# EAGLE schematic Masters Project (EAGLE 9.4.2), part 1 of 2
DESIGNER: Sean Alling; REVISION: V3

## Sheet 1 of 35: Table Of Contents
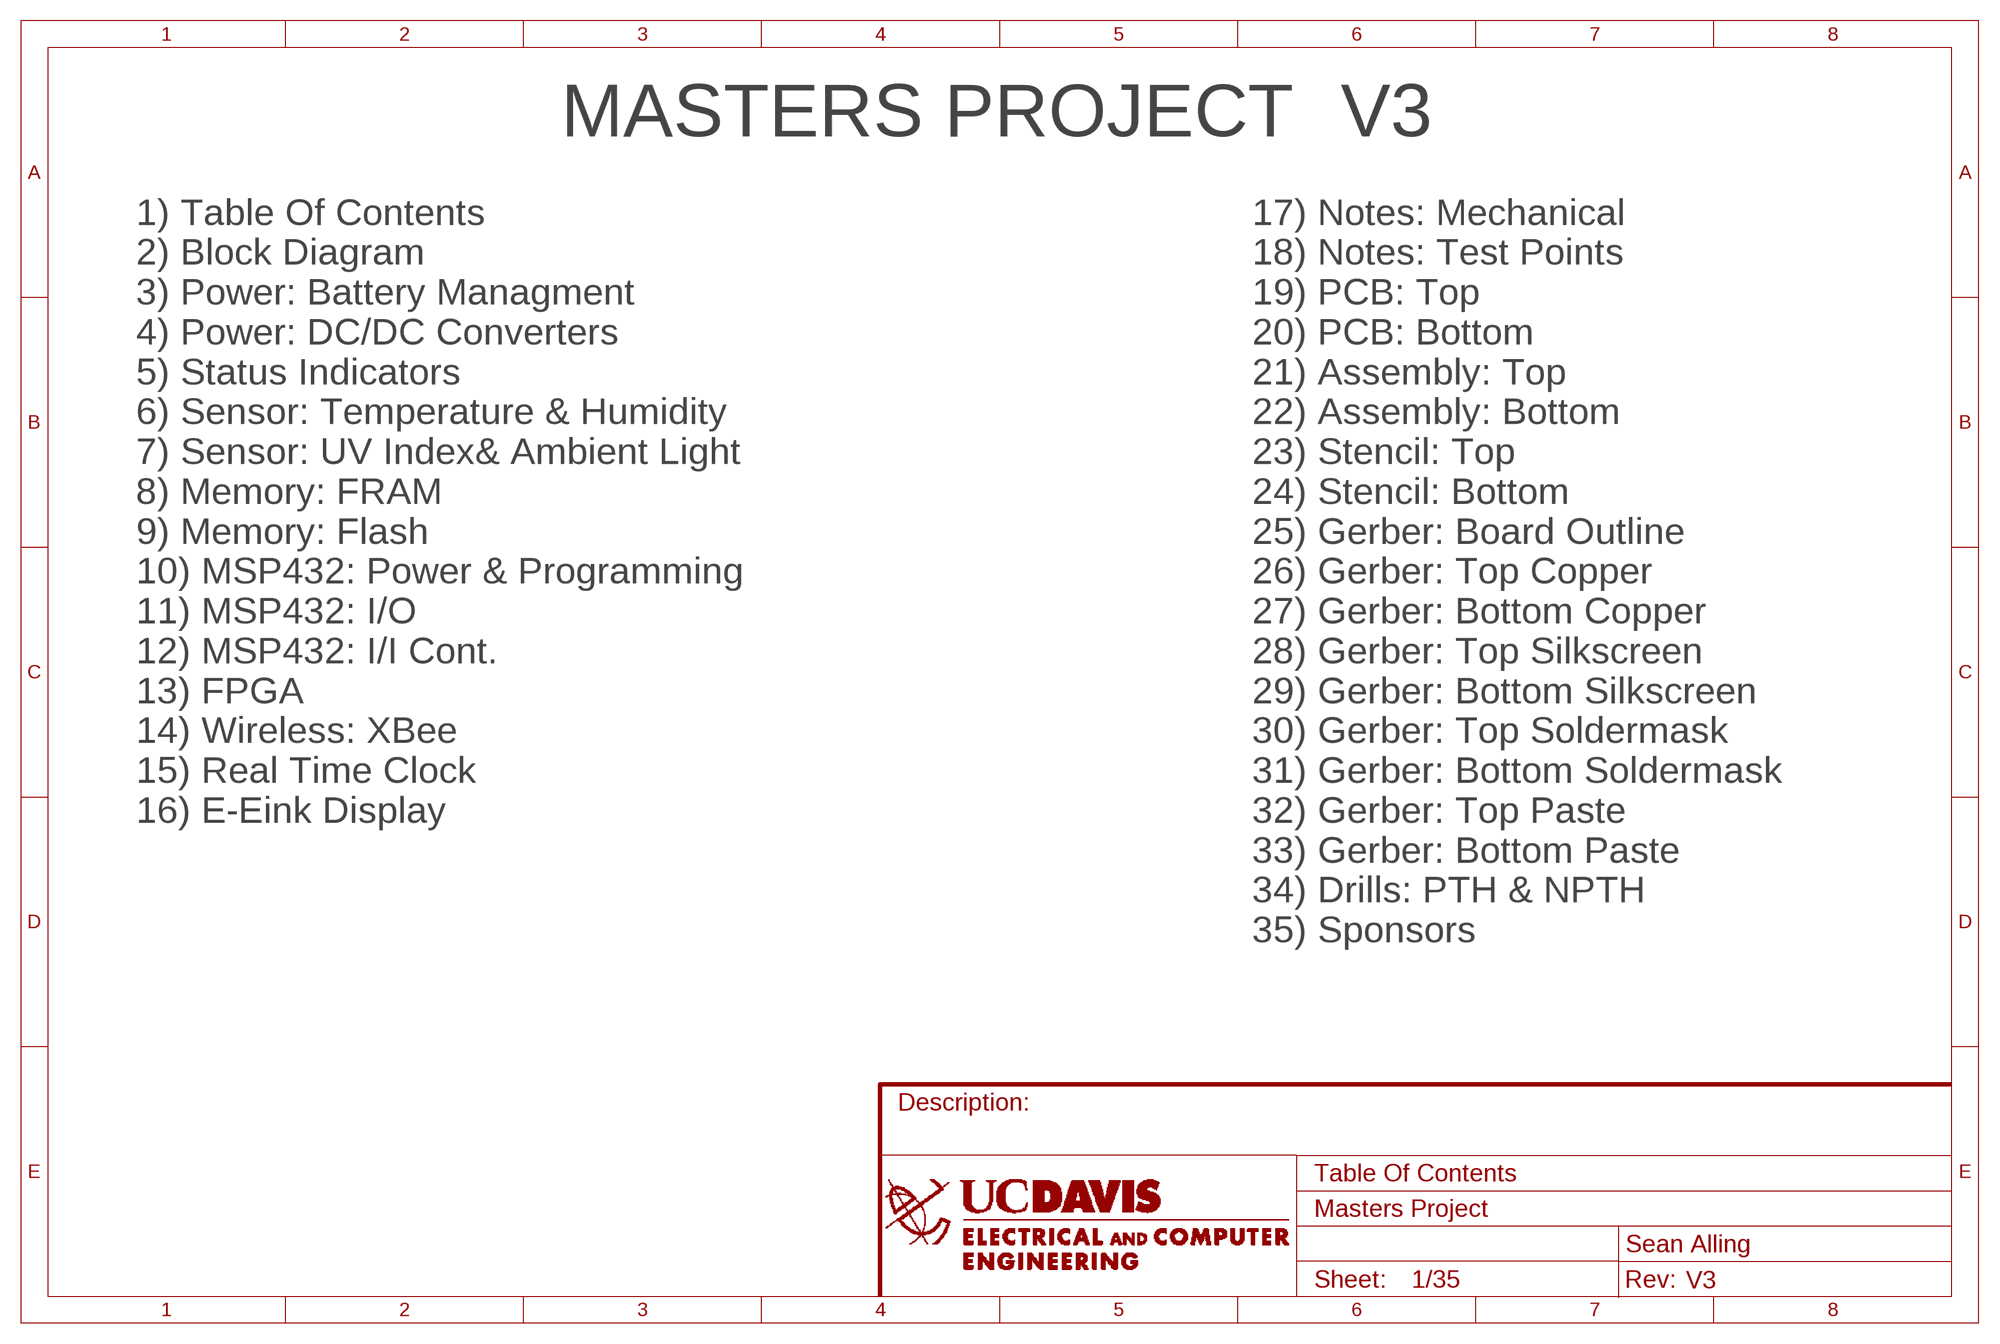
[diagram p0: schematic, sheet 1]

### Notes on the sheet
- MASTERS PROJECT
- 1) Table Of Contents
  2) Block Diagram
  3) Power: Battery Managment
  4) Power: DC/DC Converters
  5) Status Indicators
  6) Sensor: Temperature & Humidity
  7) Sensor: UV Index& Ambient Light
  8) Memory: FRAM
  9) Memory: Flash
  10) MSP432: Power & Programming
  11) MSP432: I/O
  12) MSP432: I/I Cont.
  13) FPGA
  14) Wireless: XBee
  15) Real Time Clock
  16) E-Eink Display
- 17) Notes: Mechanical
  18) Notes: Test Points
  19) PCB: Top
  20) PCB: Bottom
  21) Assembly: Top
  22) Assembly: Bottom
  23) Stencil: Top
  24) Stencil: Bottom
  25) Gerber: Board Outline
  26) Gerber: Top Copper
  27) Gerber: Bottom Copper
  28) Gerber: Top Silkscreen
  29) Gerber: Bottom Silkscreen
  30) Gerber: Top Soldermask
  31) Gerber: Bottom Soldermask
  32) Gerber: Top Paste
  33) Gerber: Bottom Paste
  34) Drills: PTH & NPTH
  35) Sponsors

## Sheet 2 of 35: Block Diagram
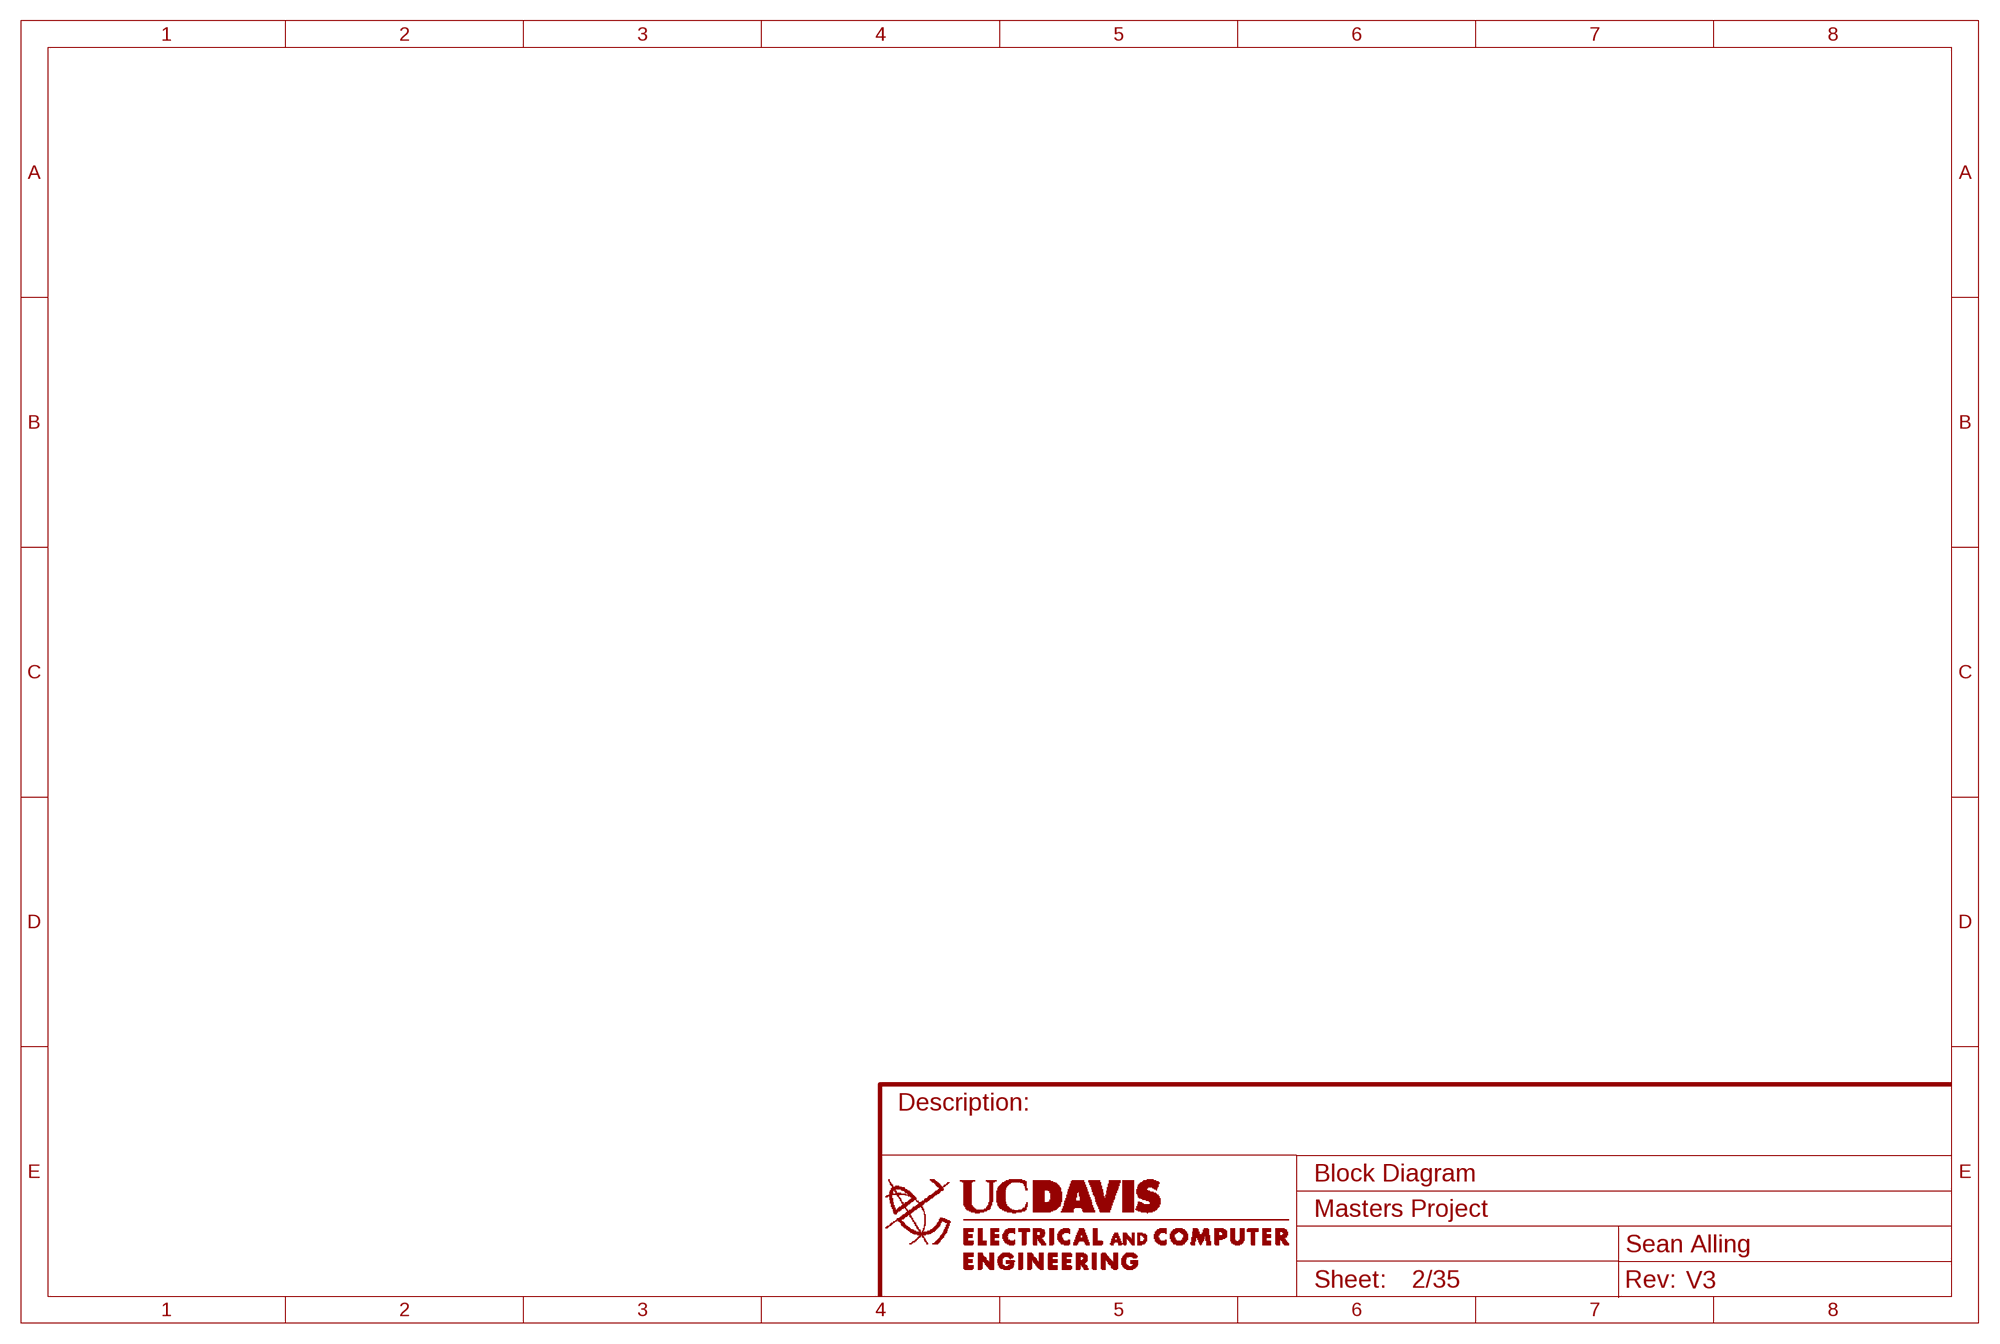
[diagram p1: schematic, sheet 2]

## Sheet 3 of 35: Power: Battery Managment
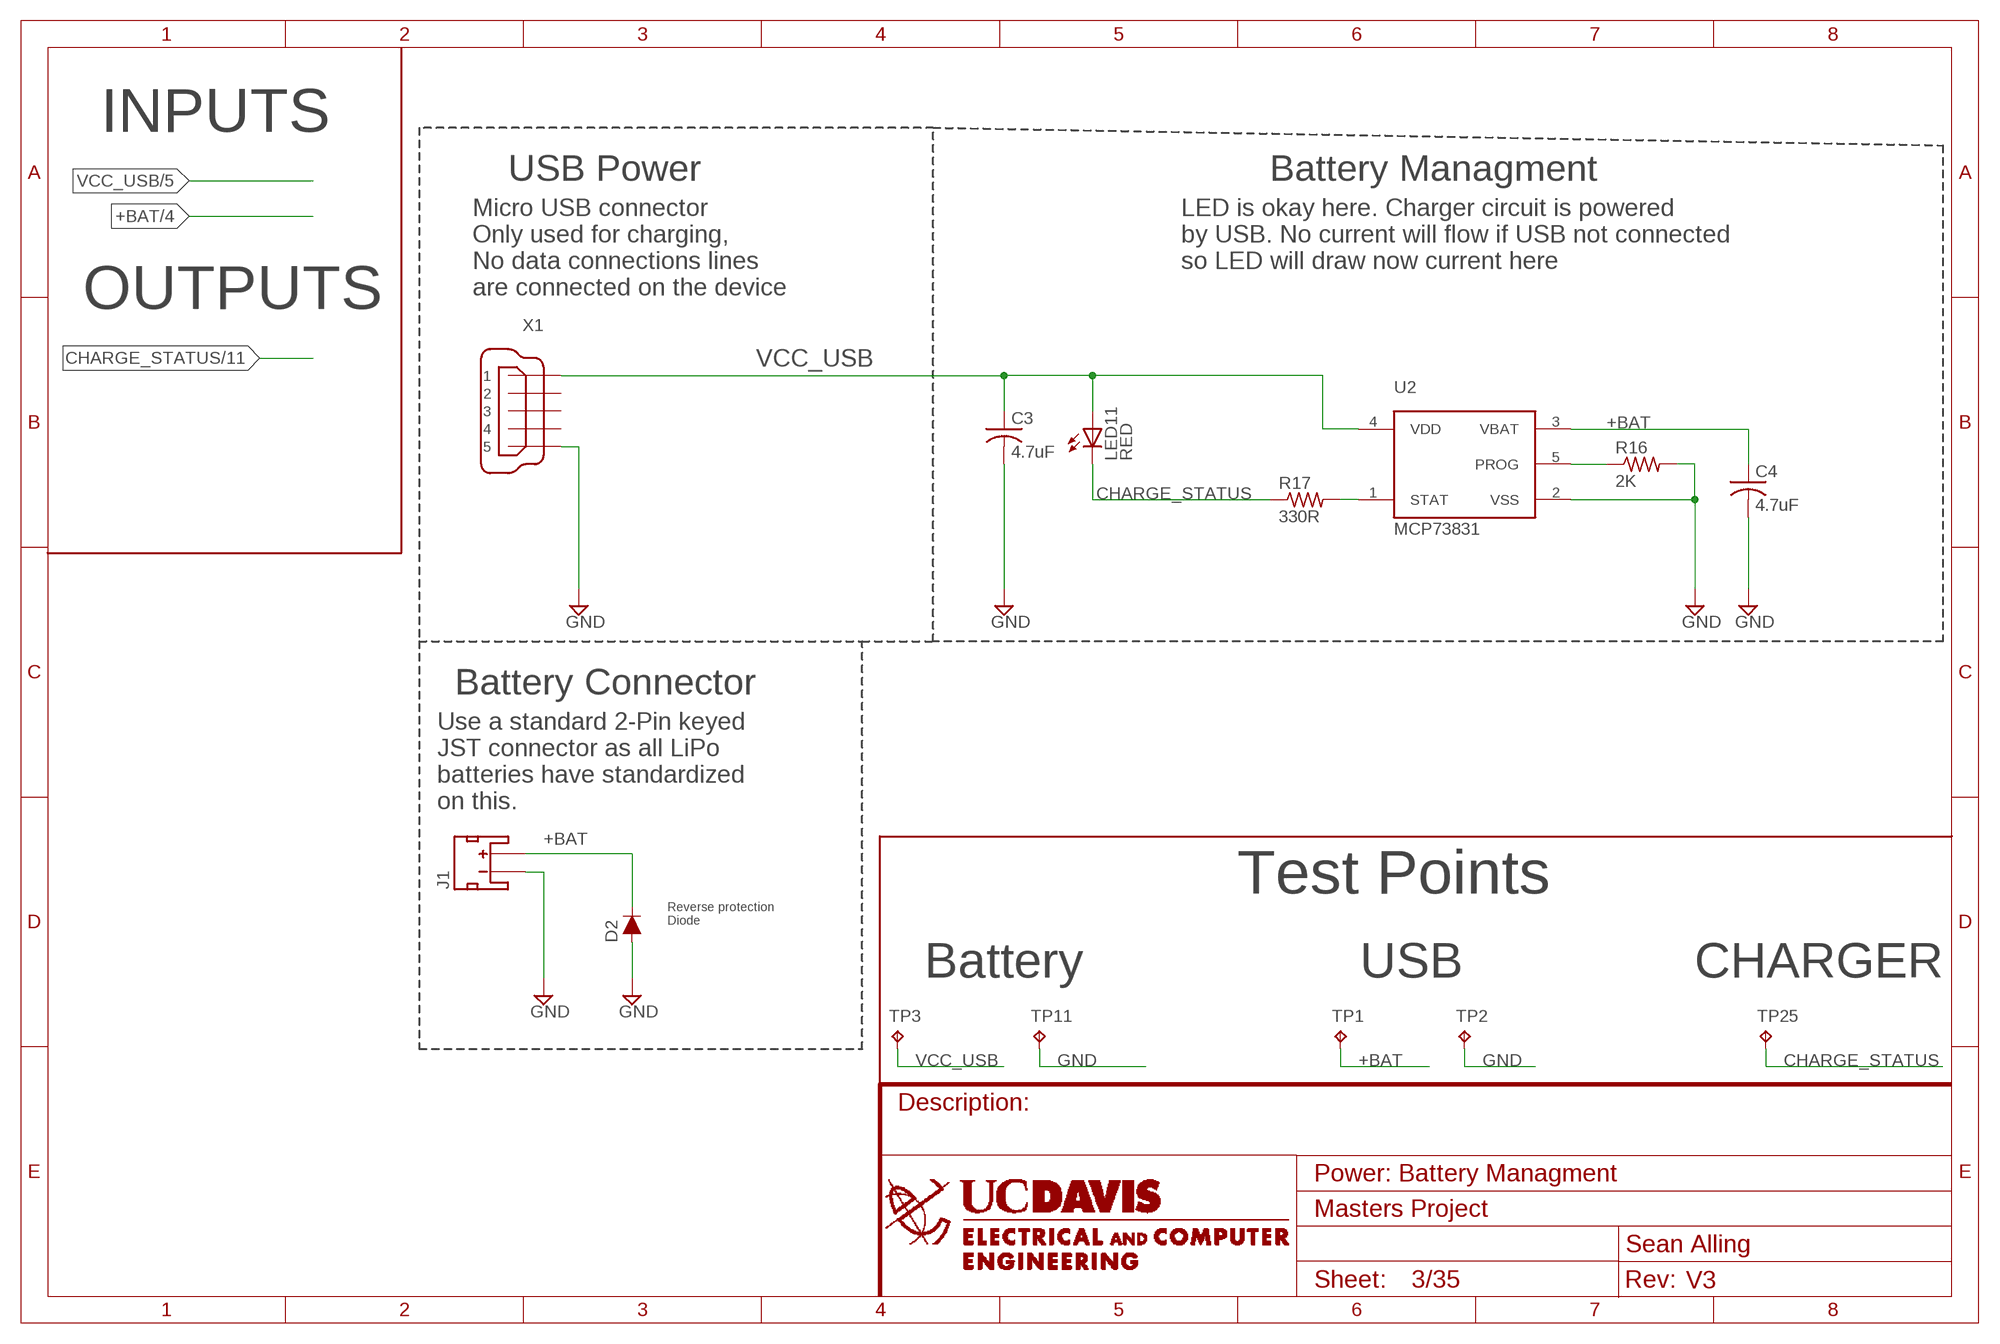
[diagram p2: schematic, sheet 3]

### Parts
C3  4.7uF  C-USC0603  [C0603]
C4  4.7uF  C-USC0603  [C0603]
D2  250mA/100V  DIODE-BAS16J  [SOD-323]
J1  JST_2MM_MALE  [JST-2-SMD]
LED11  RED  LEDCHIPLED_0603  [CHIPLED_0603]
R16  2K  R-US_R0603  [R0603]
R17  330R  R-US_R0603  [R0603]
TP1  TPB1,27  [B1,27]
TP2  TPB1,27  [B1,27]
TP3  TPB1,27  [B1,27]
TP11  TPB1,27  [B1,27]
TP25  TPB1,27  [B1,27]
U2  MCP73831  [SOT23-5L]
X1  MINI-USB-32005-201  [32005-201]

### Nets
+BAT: C4.1 D2.C J1.2(+) TP1.TP U2.3(VBAT) ; also sheet 4,5,15
CHARGE_STATUS: LED11.C R17.1 TP25.TP ; also sheet 11
GND: C3.2 C4.2 D2.A J1.1(-) R16.2 TP2.TP TP11.TP U2.2(VSS) X1.5 ; also sheet 4,5,6,7,8,9,10,12,13,14,15,16
N$5: R17.2 U2.1(STAT)
N$17: R16.1 U2.5(PROG)
VCC_USB: C3.1 LED11.A TP3.TP U2.4(VDD) X1.1 ; also sheet 5
Unconnected: J1.NC1(PAD1) J1.NC2(PAD2) X1.2 X1.3 X1.4

### Notes on the sheet
- INPUTS
- USB Power | Battery Managment
- Micro USB connector
  Only used for charging, 
  No data connections lines 
  are connected on the device
- LED is okay here. Charger circuit is powered
  by USB. No current will flow if USB not connected
  so LED will draw now current here
- OUTPUTS
- Battery Connector
- Use a standard 2-Pin keyed 
  JST connector as all LiPo
  batteries have standardized
  on this.
- Test Points
- Reverse protection 
  Diode
- Battery | USB | CHARGER

## Sheet 4 of 35: Power: DC/DC Converters
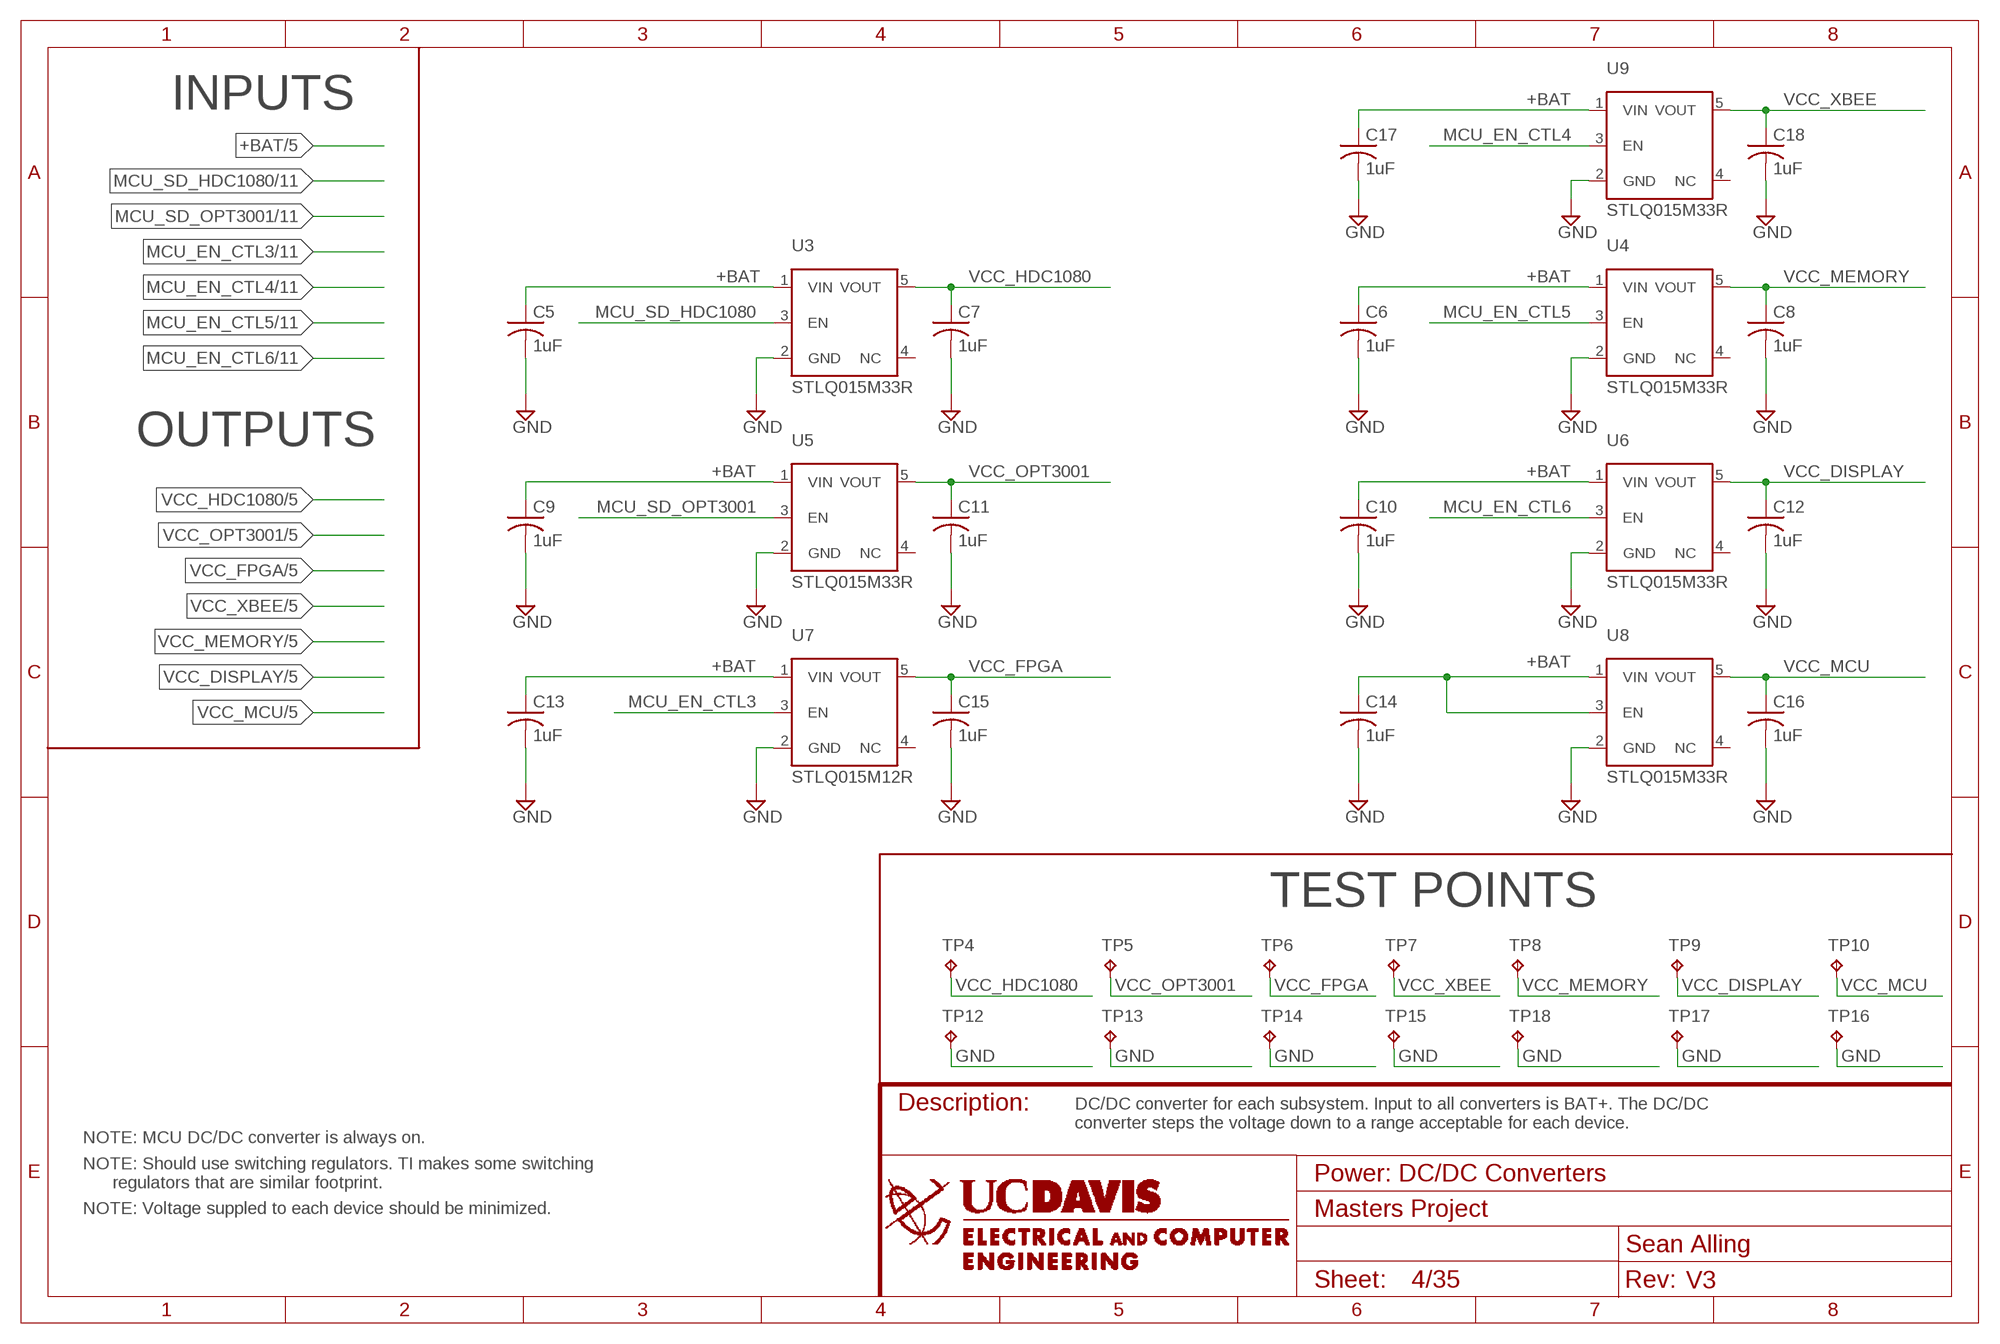
[diagram p3: schematic, sheet 4]

### Parts
C5  1uF  C-USC0603  [C0603]
C6  1uF  C-USC0603  [C0603]
C7  1uF  C-USC0603  [C0603]
C8  1uF  C-USC0603  [C0603]
C9  1uF  C-USC0603  [C0603]
C10  1uF  C-USC0603  [C0603]
C11  1uF  C-USC0603  [C0603]
C12  1uF  C-USC0603  [C0603]
C13  1uF  C-USC0603  [C0603]
C14  1uF  C-USC0603  [C0603]
C15  1uF  C-USC0603  [C0603]
C16  1uF  C-USC0603  [C0603]
C17  1uF  C-USC0603  [C0603]
C18  1uF  C-USC0603  [C0603]
TP4  TPB1,27  [B1,27]
TP5  TPB1,27  [B1,27]
TP6  TPB1,27  [B1,27]
TP7  TPB1,27  [B1,27]
TP8  TPB1,27  [B1,27]
TP9  TPB1,27  [B1,27]
TP10  TPB1,27  [B1,27]
TP12  TPB1,27  [B1,27]
TP13  TPB1,27  [B1,27]
TP14  TPB1,27  [B1,27]
TP15  TPB1,27  [B1,27]
TP16  TPB1,27  [B1,27]
TP17  TPB1,27  [B1,27]
TP18  TPB1,27  [B1,27]
U3  STLQ015M33R  [SOT23-5L]
U4  STLQ015M33R  [SOT23-5L]
U5  STLQ015M33R  [SOT23-5L]
U6  STLQ015M33R  [SOT23-5L]
U7  STLQ015M12R  [SOT23-5L]
U8  STLQ015M33R  [SOT23-5L]
U9  STLQ015M33R  [SOT23-5L]

### Nets
+BAT: C5.1 C6.1 C9.1 C10.1 C13.1 C14.1 C17.1 U3.1(VIN) U4.1(VIN) U5.1(VIN) U6.1(VIN) U7.1(VIN) U8.1(VIN) U8.3(EN) U9.1(VIN) ; also sheet 3,5,15
GND: C5.2 C6.2 C7.2 C8.2 C9.2 C10.2 C11.2 C12.2 C13.2 C14.2 C15.2 C16.2 C17.2 C18.2 TP12.TP TP13.TP TP14.TP TP15.TP TP16.TP TP17.TP TP18.TP U3.2(GND) U4.2(GND) U5.2(GND) U6.2(GND) U7.2(GND) U8.2(GND) U9.2(GND) ; also sheet 3,5,6,7,8,9,10,12,13,14,15,16
MCU_EN_CTL3: U7.3(EN) ; also sheet 11
MCU_EN_CTL4: U9.3(EN) ; also sheet 11
MCU_EN_CTL5: U4.3(EN) ; also sheet 11
MCU_EN_CTL6: U6.3(EN) ; also sheet 11
MCU_SD_HDC1080: U3.3(EN) ; also sheet 11
MCU_SD_OPT3001: U5.3(EN) ; also sheet 11
VCC_DISPLAY: C12.1 TP9.TP U6.5(VOUT) ; also sheet 5,16
VCC_FPGA: C15.1 TP6.TP U7.5(VOUT) ; also sheet 5,13
VCC_HDC1080: C7.1 TP4.TP U3.5(VOUT) ; also sheet 5,6
VCC_MCU: C16.1 TP10.TP U8.5(VOUT) ; also sheet 5,10,11,12
VCC_MEMORY: C8.1 TP8.TP U4.5(VOUT) ; also sheet 5,8,9
VCC_OPT3001: C11.1 TP5.TP U5.5(VOUT) ; also sheet 5,7
VCC_XBEE: C18.1 TP7.TP U9.5(VOUT) ; also sheet 5,14
Unconnected: U3.4(NC) U4.4(NC) U5.4(NC) U6.4(NC) U7.4(NC) U8.4(NC) U9.4(NC)

### Notes on the sheet
- INPUTS
- OUTPUTS
- TEST POINTS
- DC/DC converter for each subsystem. Input to all converters is BAT+. The DC/DC
  converter steps the voltage down to a range acceptable for each device.
- NOTE: MCU DC/DC converter is always on.
- NOTE: Should use switching regulators. TI makes some switching 
        regulators that are similar footprint.
- NOTE: Voltage suppled to each device should be minimized.

## Sheet 5 of 35: Status Indicators
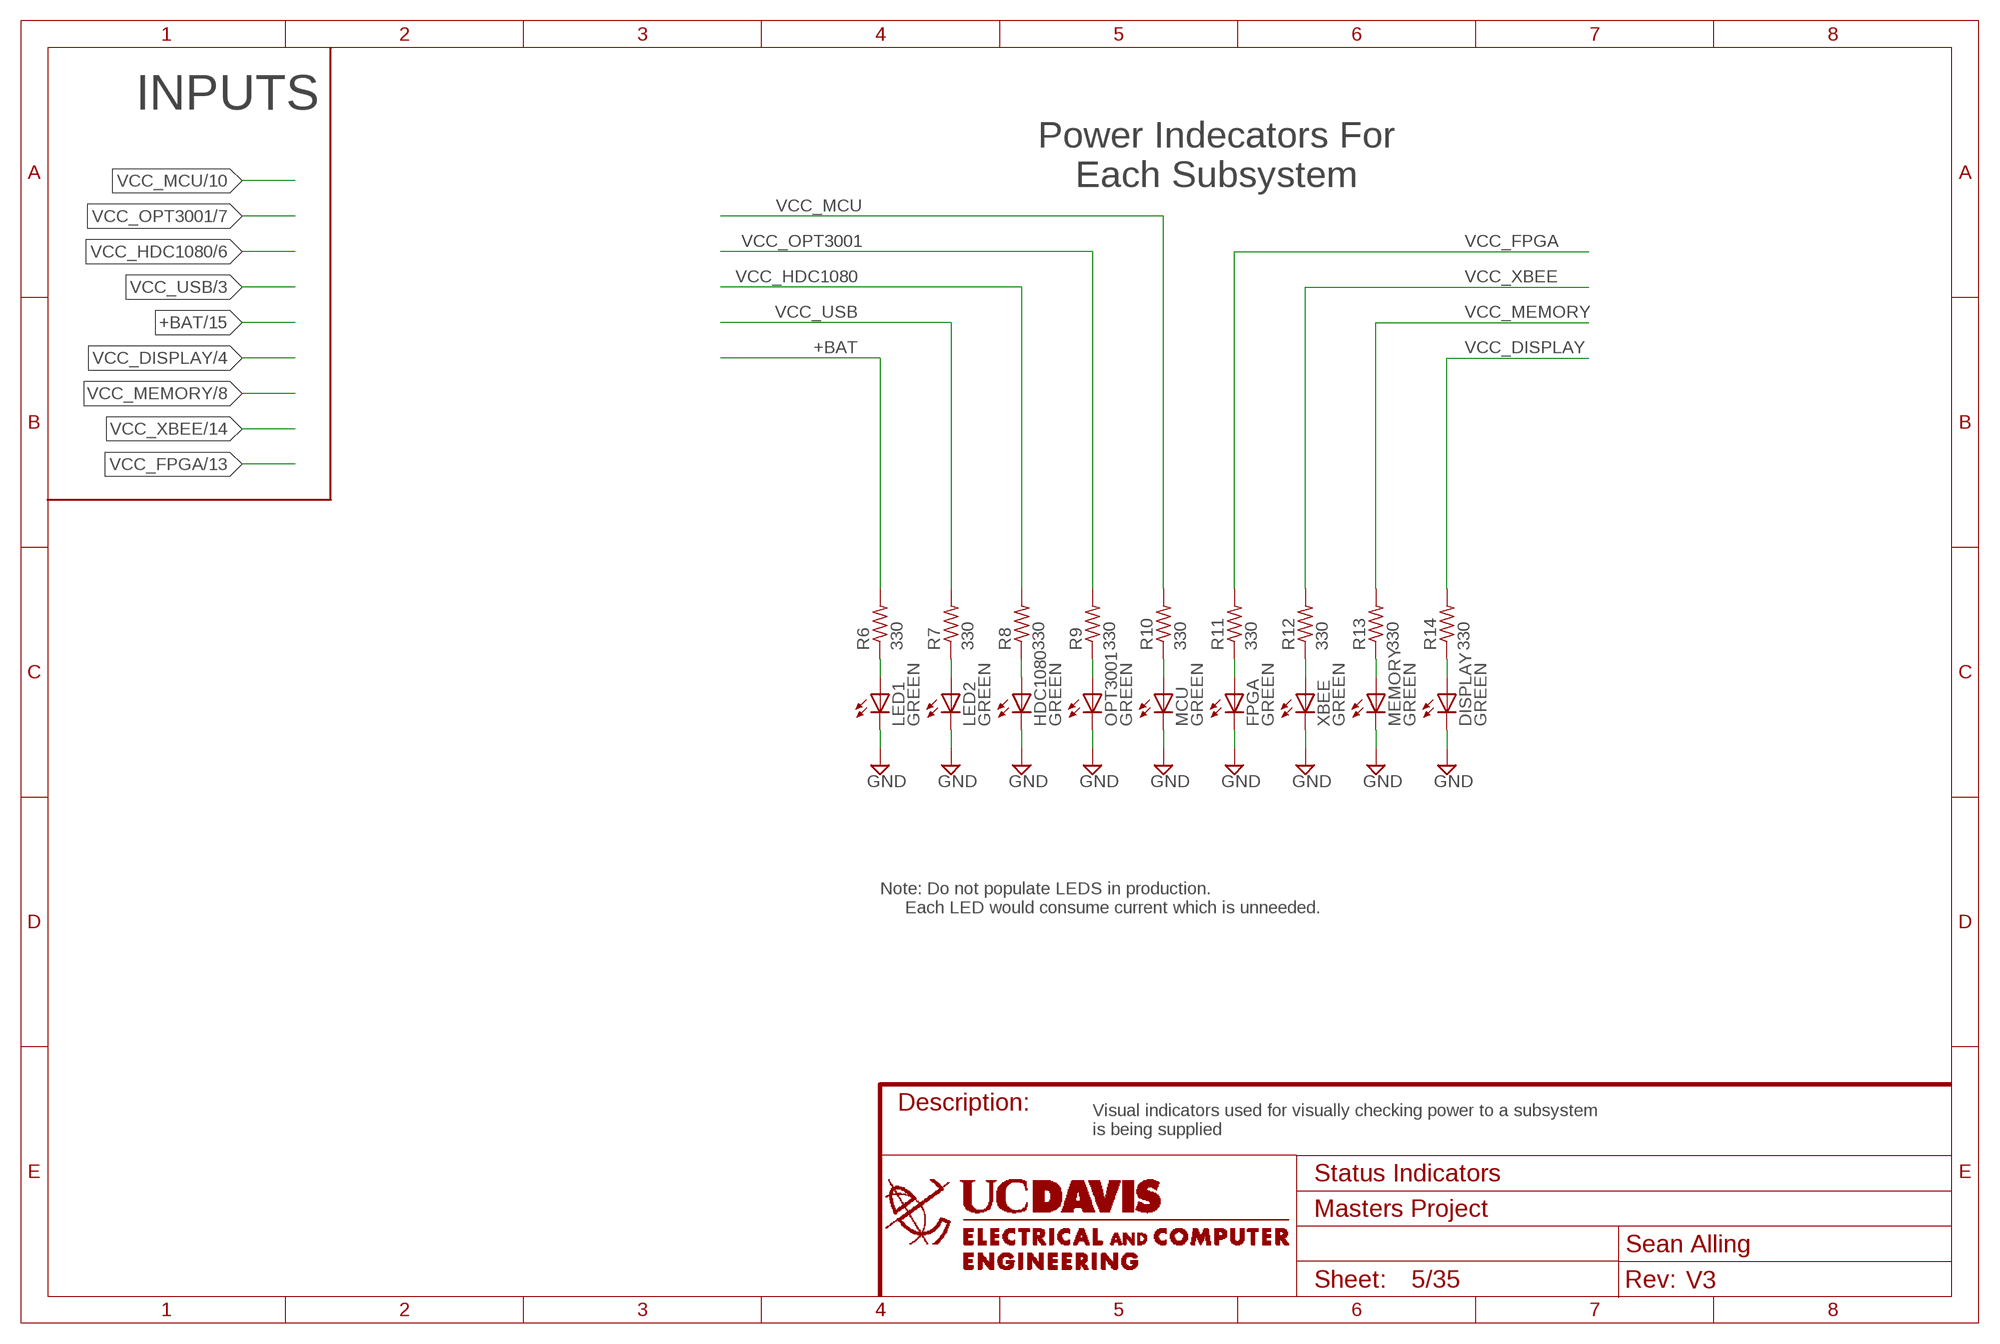
[diagram p4: schematic, sheet 5]

### Parts
DISPLAY  GREEN  LEDCHIPLED_0603  [CHIPLED_0603]
FPGA  GREEN  LEDCHIPLED_0603  [CHIPLED_0603]
HDC1080  GREEN  LEDCHIPLED_0603  [CHIPLED_0603]
LED1  GREEN  LEDCHIPLED_0603  [CHIPLED_0603]
LED2  GREEN  LEDCHIPLED_0603  [CHIPLED_0603]
MCU  GREEN  LEDCHIPLED_0603  [CHIPLED_0603]
MEMORY  GREEN  LEDCHIPLED_0603  [CHIPLED_0603]
OPT3001  GREEN  LEDCHIPLED_0603  [CHIPLED_0603]
R6  330  R-US_R0603  [R0603]
R7  330  R-US_R0603  [R0603]
R8  330  R-US_R0603  [R0603]
R9  330  R-US_R0603  [R0603]
R10  330  R-US_R0603  [R0603]
R11  330  R-US_R0603  [R0603]
R12  330  R-US_R0603  [R0603]
R13  330  R-US_R0603  [R0603]
R14  330  R-US_R0603  [R0603]
XBEE  GREEN  LEDCHIPLED_0603  [CHIPLED_0603]

### Nets
+BAT: R6.2 ; also sheet 3,4,15
GND: DISPLAY.C FPGA.C HDC1080.C LED1.C LED2.C MCU.C MEMORY.C OPT3001.C XBEE.C ; also sheet 3,4,6,7,8,9,10,12,13,14,15,16
N$164: LED1.A R6.1
N$165: LED2.A R7.1
N$166: HDC1080.A R8.1
N$167: OPT3001.A R9.1
N$168: MCU.A R10.1
N$169: FPGA.A R11.1
N$171: DISPLAY.A R14.1
N$172: MEMORY.A R13.1
N$173: R12.1 XBEE.A
VCC_DISPLAY: R14.2 ; also sheet 4,16
VCC_FPGA: R11.2 ; also sheet 4,13
VCC_HDC1080: R8.2 ; also sheet 4,6
VCC_MCU: R10.2 ; also sheet 4,10,11,12
VCC_MEMORY: R13.2 ; also sheet 4,8,9
VCC_OPT3001: R9.2 ; also sheet 4,7
VCC_USB: R7.2 ; also sheet 3
VCC_XBEE: R12.2 ; also sheet 4,14

### Notes on the sheet
- INPUTS
- Power Indecators For
  Each Subsystem
- Note: Do not populate LEDS in production. 
       Each LED would consume current which is unneeded.
- Visual indicators used for visually checking power to a subsystem
  is being supplied

## Sheet 6 of 35: Sensor: Temperature & Humidity
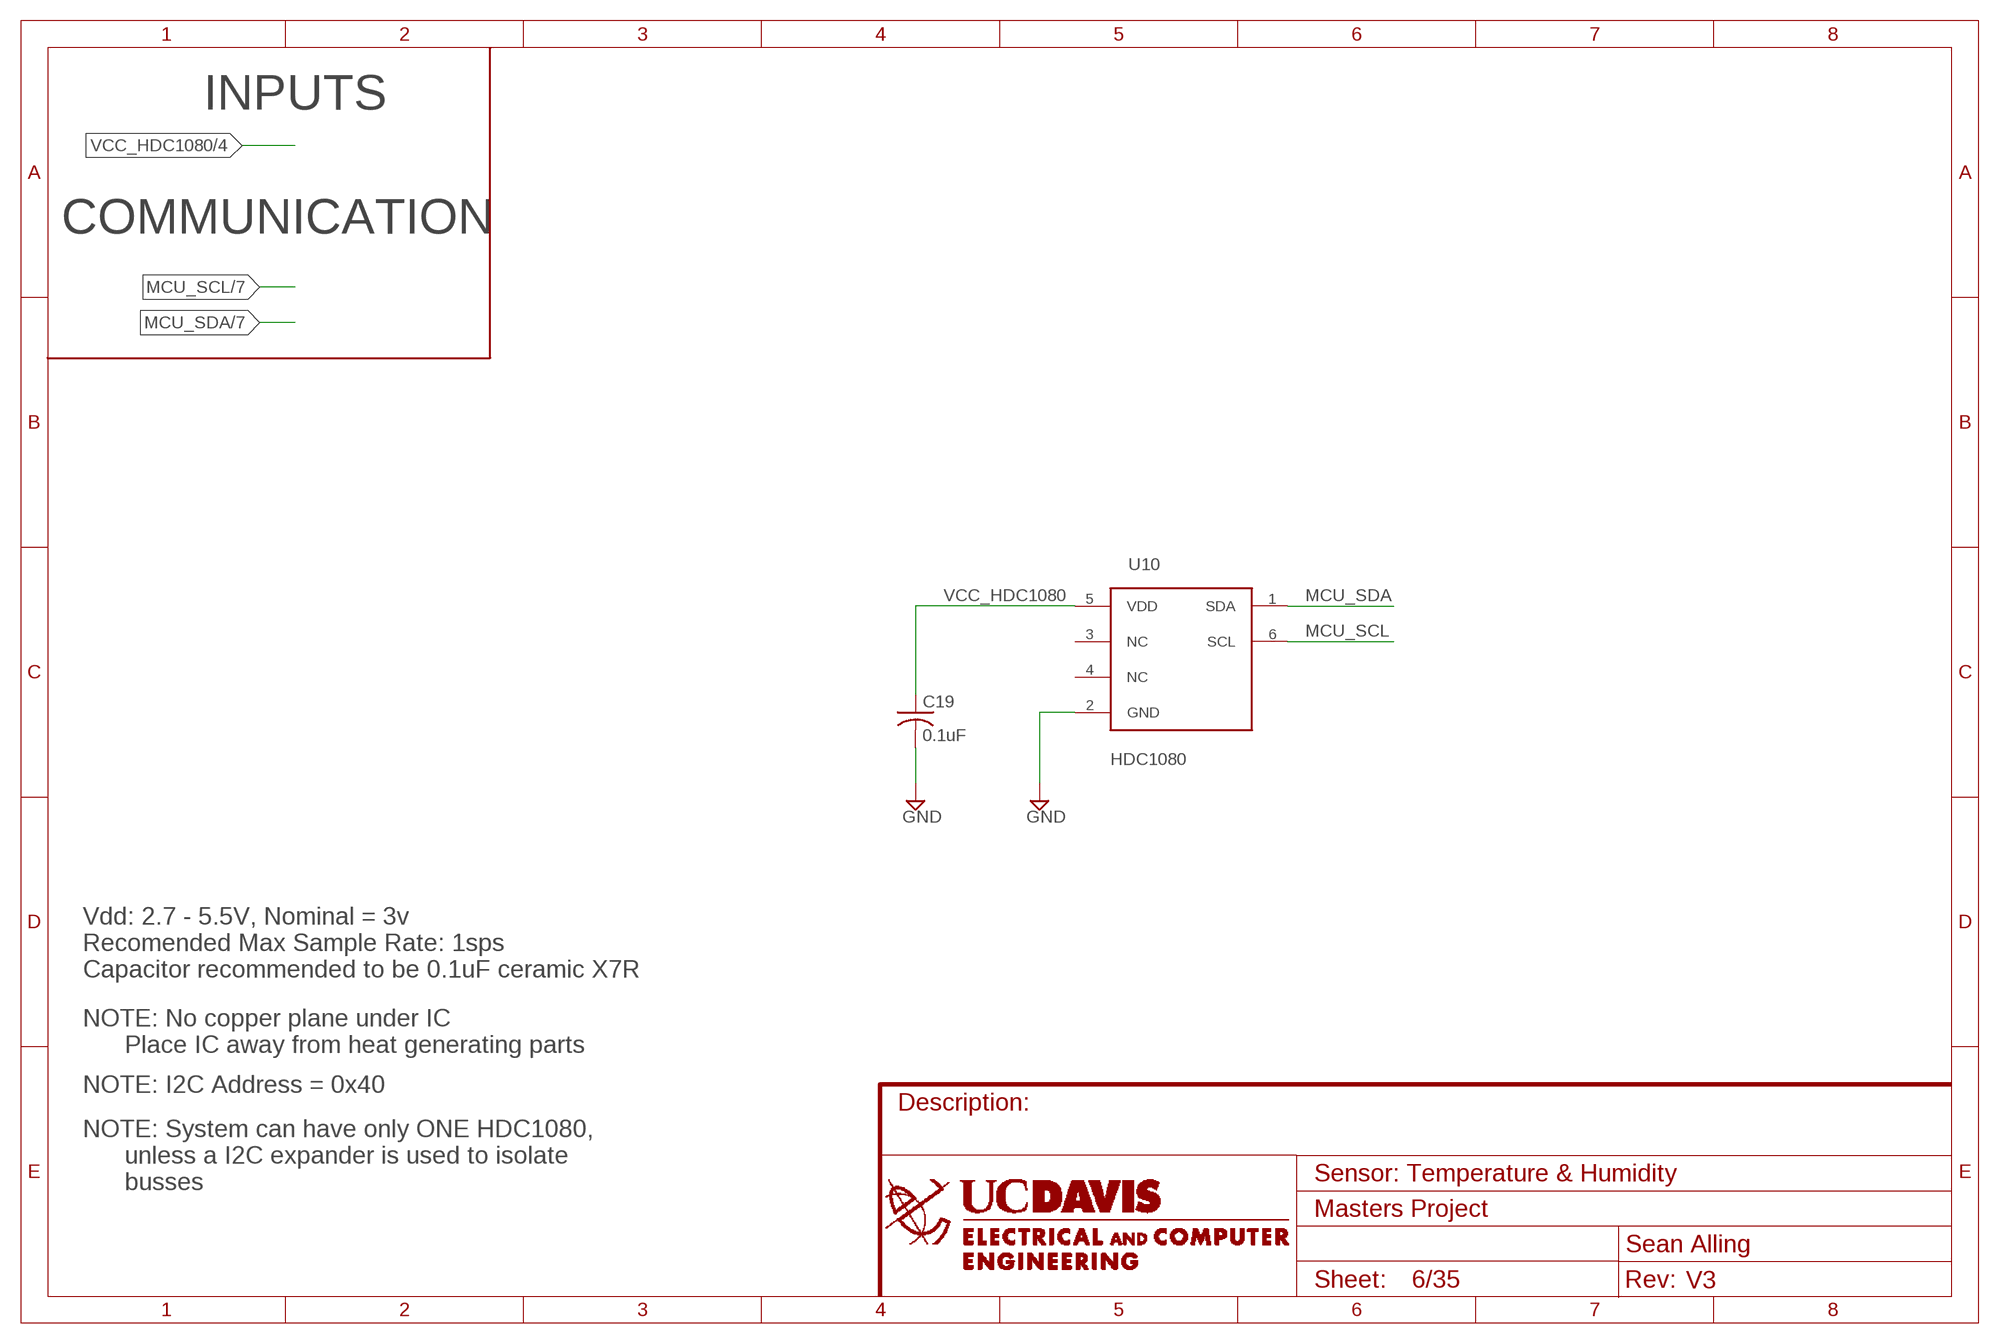
[diagram p5: schematic, sheet 6]

### Parts
C19  0.1uF  C-USC0603  [C0603]
U10  HDC1080  [WSON-6]

### Nets
GND: C19.2 U10.2(GND) ; also sheet 3,4,5,7,8,9,10,12,13,14,15,16
MCU_SCL: U10.6(SCL) ; also sheet 7,8,11,15
MCU_SDA: U10.1(SDA) ; also sheet 7,8,11,15
VCC_HDC1080: C19.1 U10.5(VDD) ; also sheet 4,5
Unconnected: U10.3(NC) U10.4(NC)

### Notes on the sheet
- INPUTS
- COMMUNICATION
- Vdd: 2.7 - 5.5V, Nominal = 3v
  Recomended Max Sample Rate: 1sps
  Capacitor recommended to be 0.1uF ceramic X7R
- NOTE: No copper plane under IC
        Place IC away from heat generating parts
- NOTE: I2C Address = 0x40
- NOTE: System can have only ONE HDC1080,
        unless a I2C expander is used to isolate 
        busses

## Sheet 7 of 35: Sensor: UV Index& Ambient Light
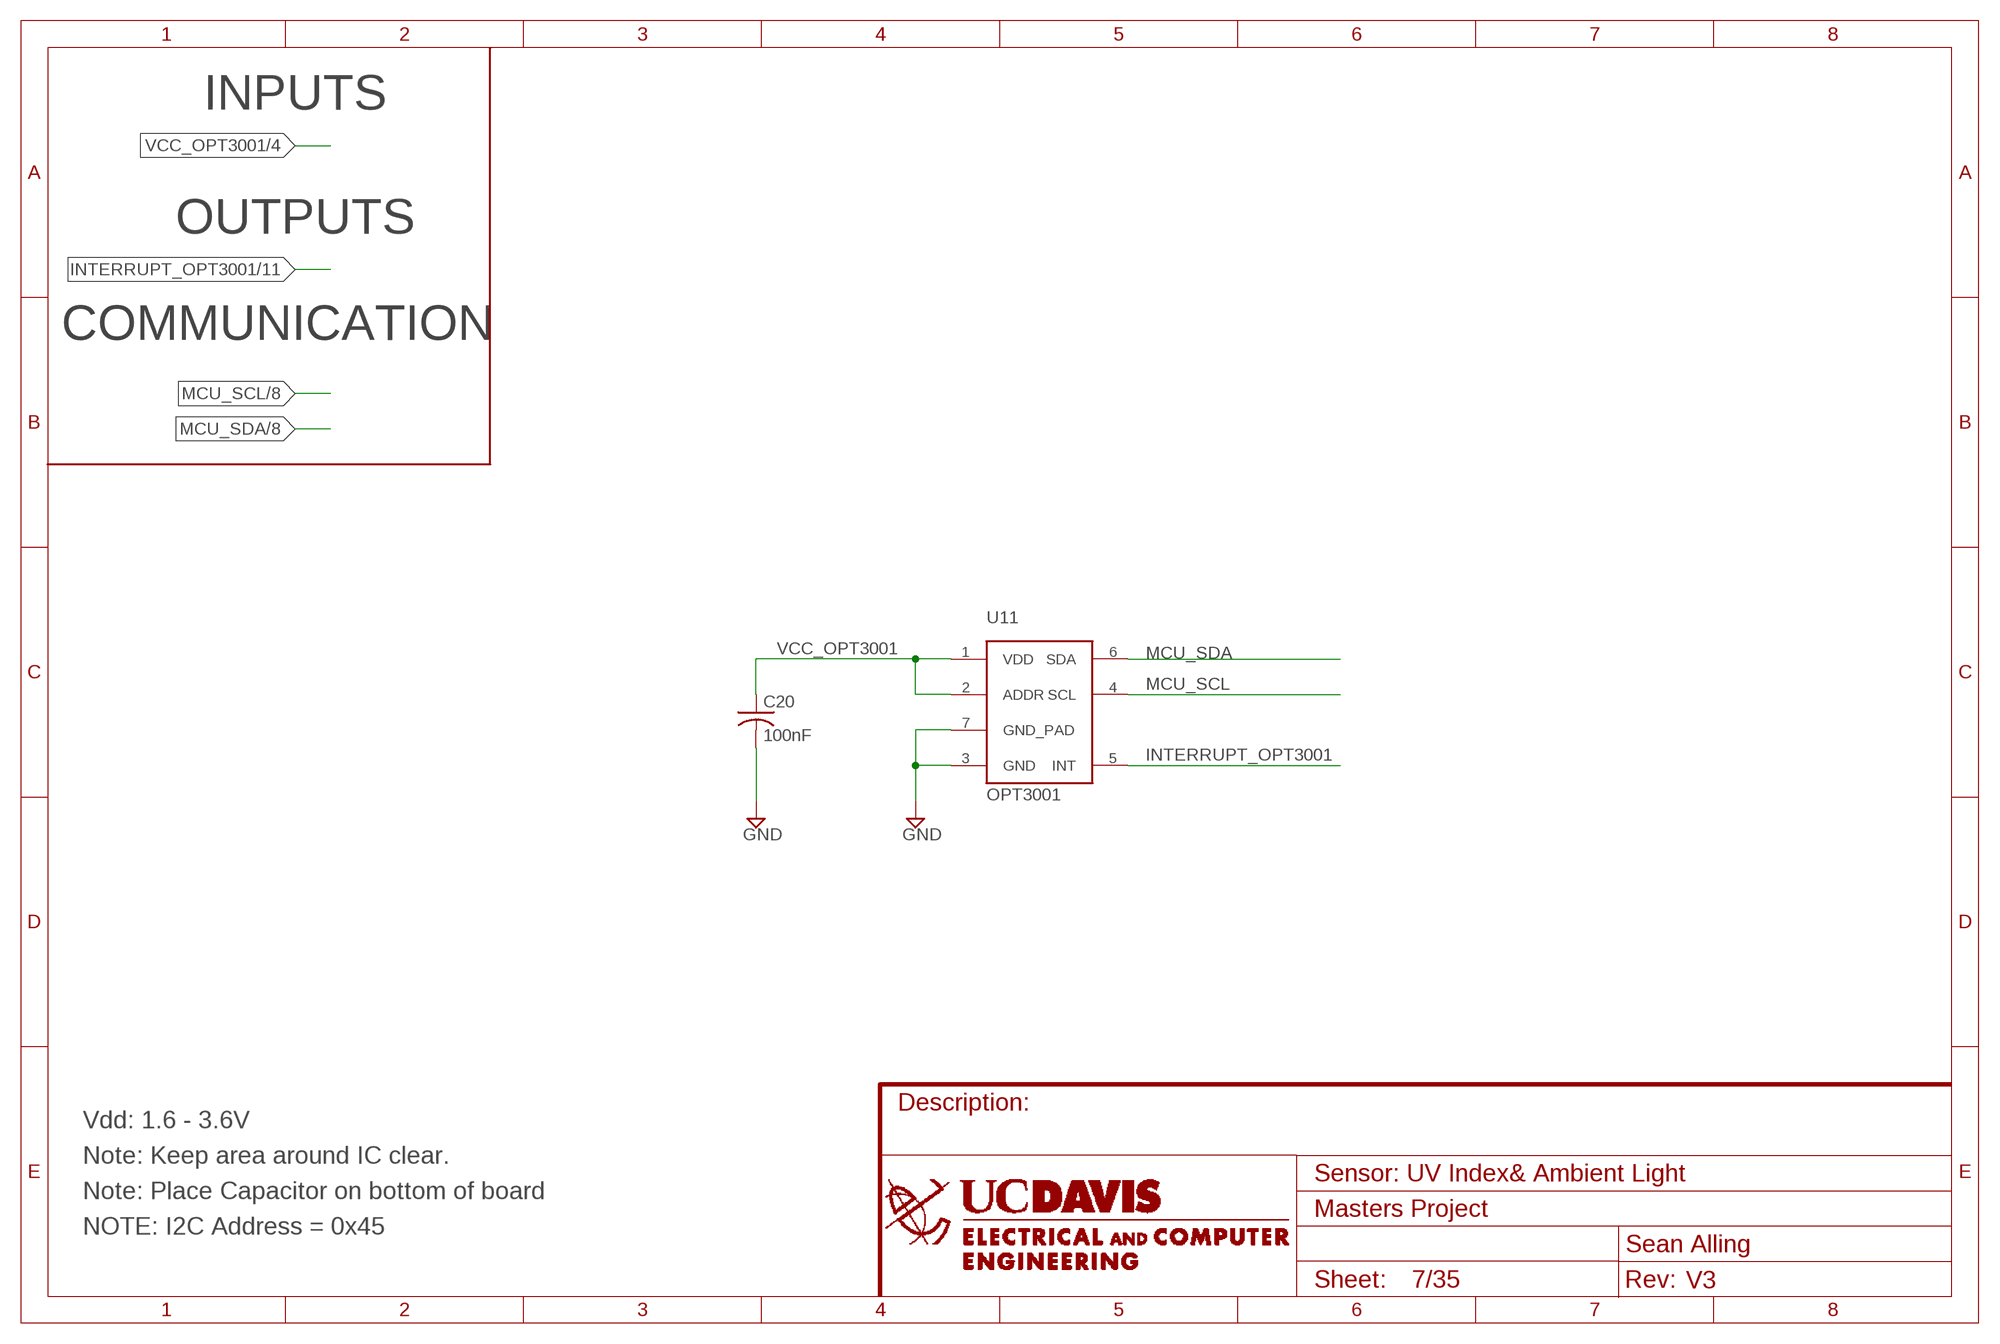
[diagram p6: schematic, sheet 7]

### Parts
C20  100nF  C-USC0603  [C0603]
U11  OPT3001  [USON-6]

### Nets
GND: C20.2 U11.3(GND) U11.7(GND_PAD) ; also sheet 3,4,5,6,8,9,10,12,13,14,15,16
INTERRUPT_OPT3001: U11.5(INT) ; also sheet 11
MCU_SCL: U11.4(SCL) ; also sheet 6,8,11,15
MCU_SDA: U11.6(SDA) ; also sheet 6,8,11,15
VCC_OPT3001: C20.1 U11.1(VDD) U11.2(ADDR) ; also sheet 4,5

### Notes on the sheet
- INPUTS
- OUTPUTS
- COMMUNICATION
- Vdd: 1.6 - 3.6V
- Note: Keep area around IC clear.
- Note: Place Capacitor on bottom of board
- NOTE: I2C Address = 0x45

## Sheet 8 of 35: Memory: FRAM
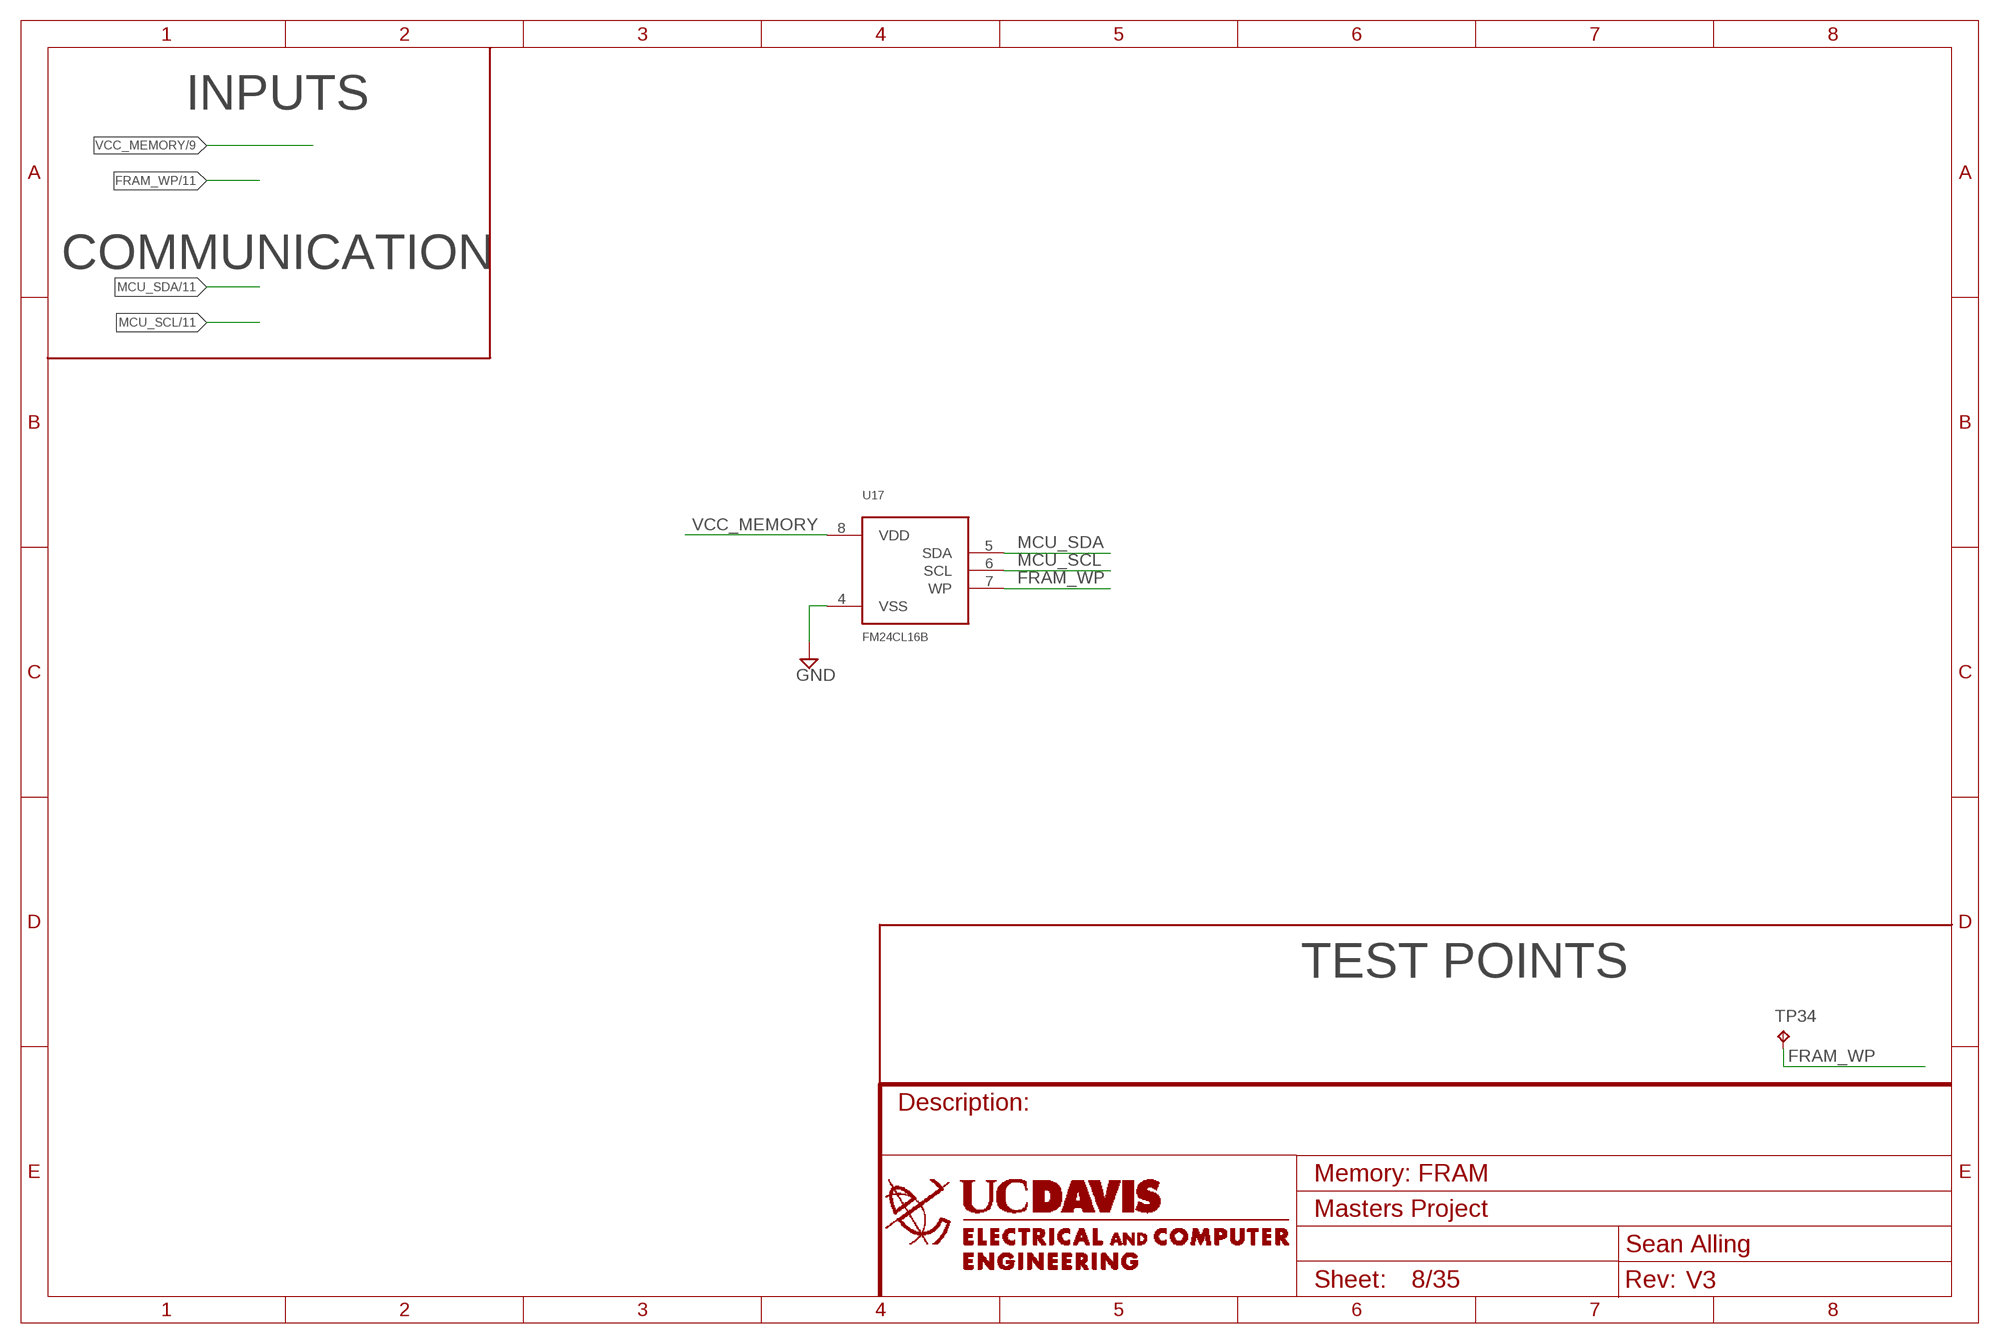
[diagram p7: schematic, sheet 8]

### Parts
TP34  TPB1,27  [B1,27]
U17  FM24CL16B  [FM24CL16B]

### Nets
FRAM_WP: TP34.TP U17.7(WP) ; also sheet 11
GND: U17.4(VSS) ; also sheet 3,4,5,6,7,9,10,12,13,14,15,16
MCU_SCL: U17.6(SCL) ; also sheet 6,7,11,15
MCU_SDA: U17.5(SDA) ; also sheet 6,7,11,15
VCC_MEMORY: U17.8(VDD) ; also sheet 4,5,9

### Notes on the sheet
- INPUTS
- COMMUNICATION
- TEST POINTS

## Sheet 9 of 35: Memory: Flash
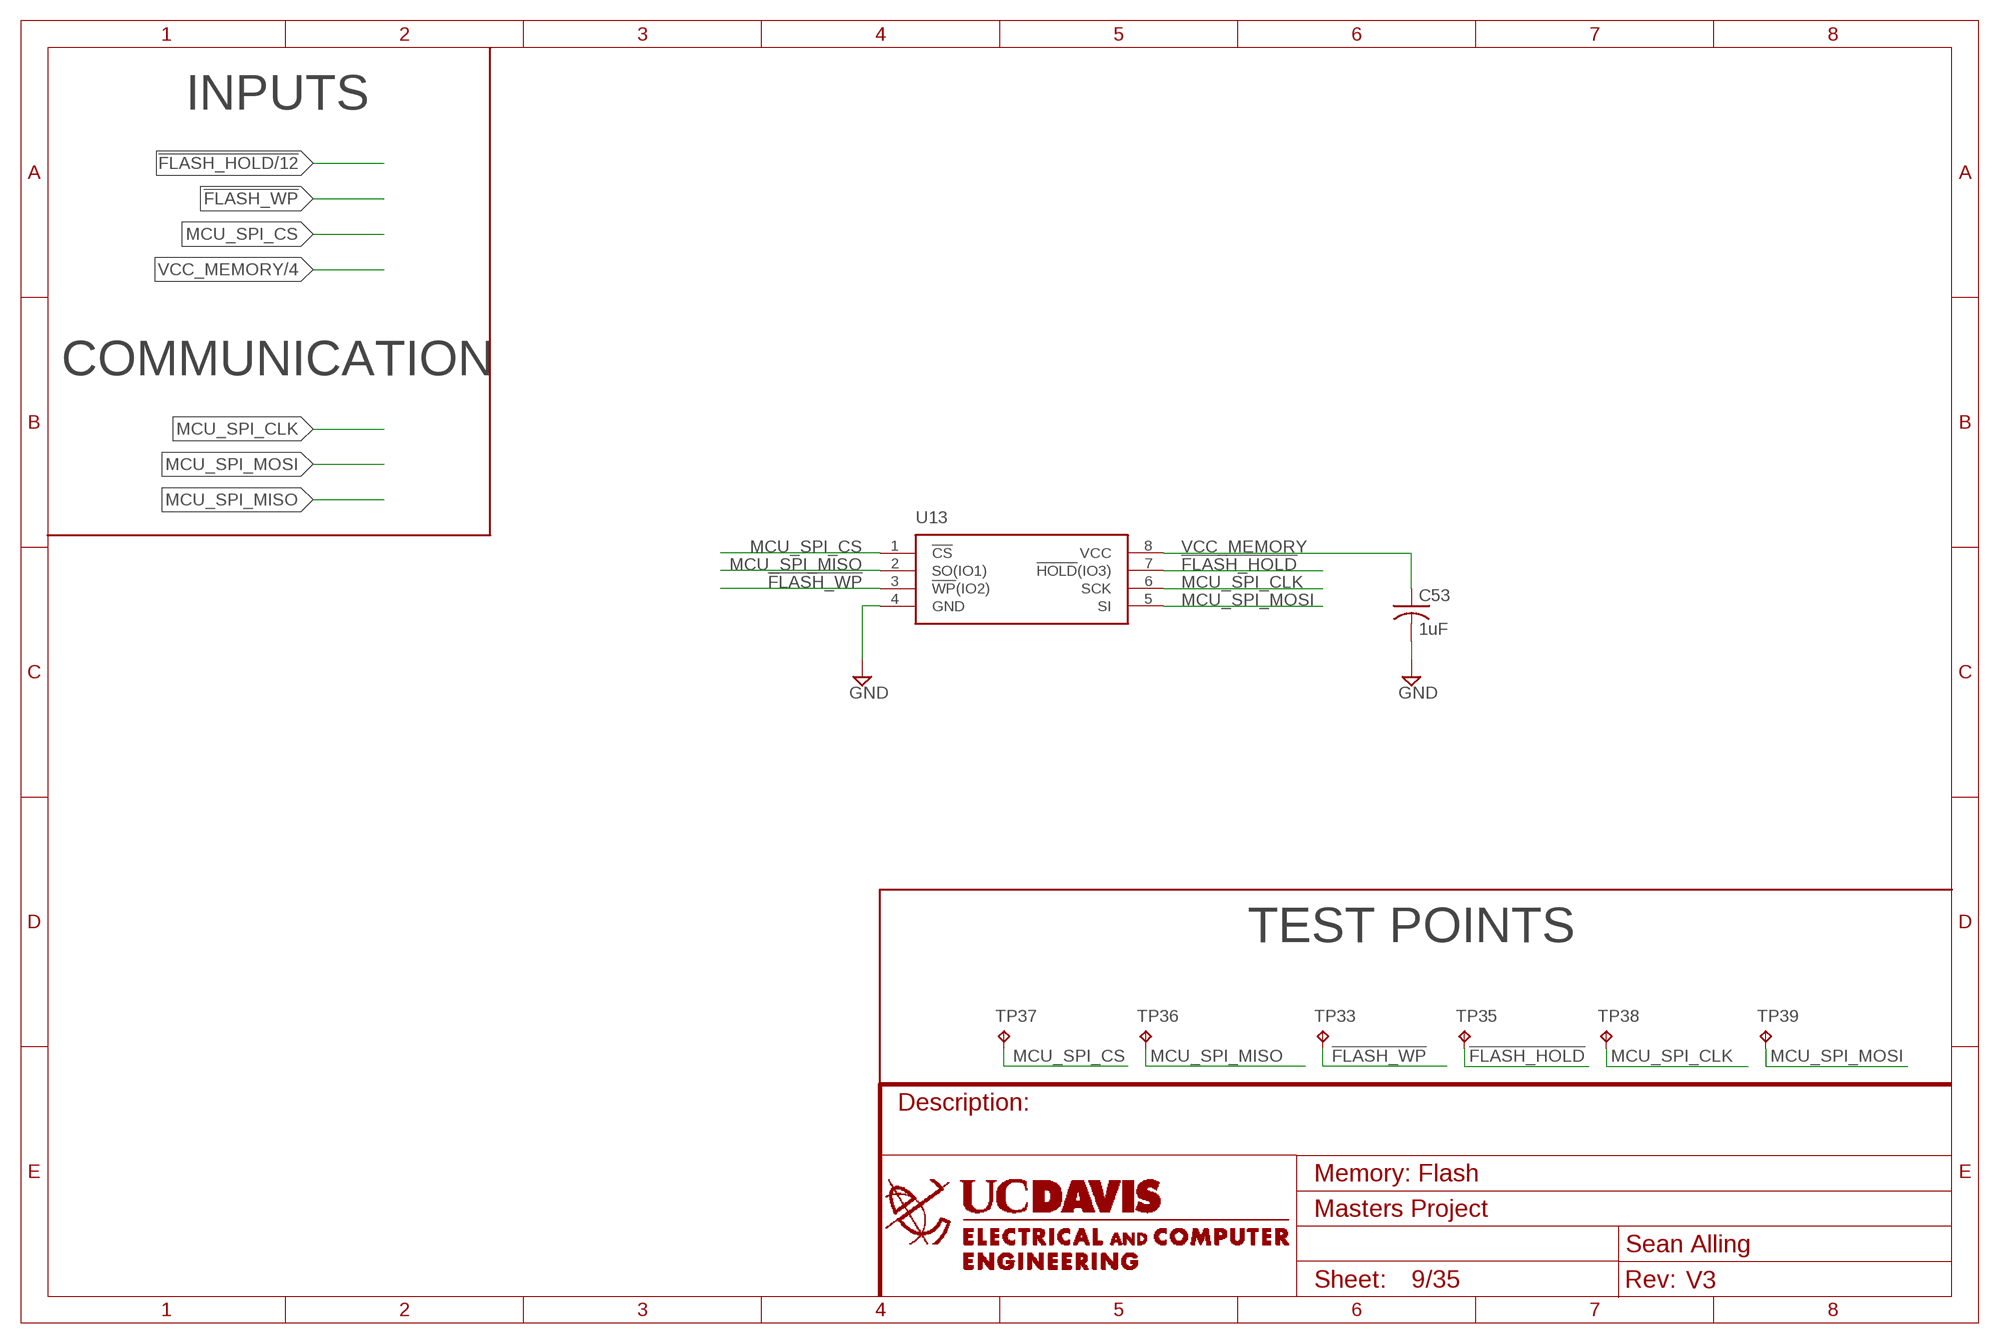
[diagram p8: schematic, sheet 9]

### Parts
C53  1uF  C-USC0603  [C0603]
TP33  TPB1,27  [B1,27]
TP35  TPB1,27  [B1,27]
TP36  TPB1,27  [B1,27]
TP37  TPB1,27  [B1,27]
TP38  TPB1,27  [B1,27]
TP39  TPB1,27  [B1,27]
U13  AT25SL128A  [SON127P600X500X60-8N]

### Nets
!FLASH_HOLD: TP35.TP U13.7(!HOLD!(IO3)) ; also sheet 12
!FLASH_WP: TP33.TP U13.3(!WP!(IO2)) ; also sheet 12
GND: C53.2 U13.4(GND) ; also sheet 3,4,5,6,7,8,10,12,13,14,15,16
MCU_SPI_CLK: TP38.TP U13.6(SCK) ; also sheet 12
MCU_SPI_CS: TP37.TP U13.1(!CS) ; also sheet 12
MCU_SPI_MISO: TP36.TP U13.2(SO(IO1)) ; also sheet 12
MCU_SPI_MOSI: TP39.TP U13.5(SI) ; also sheet 12
VCC_MEMORY: C53.1 U13.8(VCC) ; also sheet 4,5,8

### Notes on the sheet
- INPUTS
- COMMUNICATION
- TEST POINTS

## Sheet 10 of 35: MSP432: Power & Programming
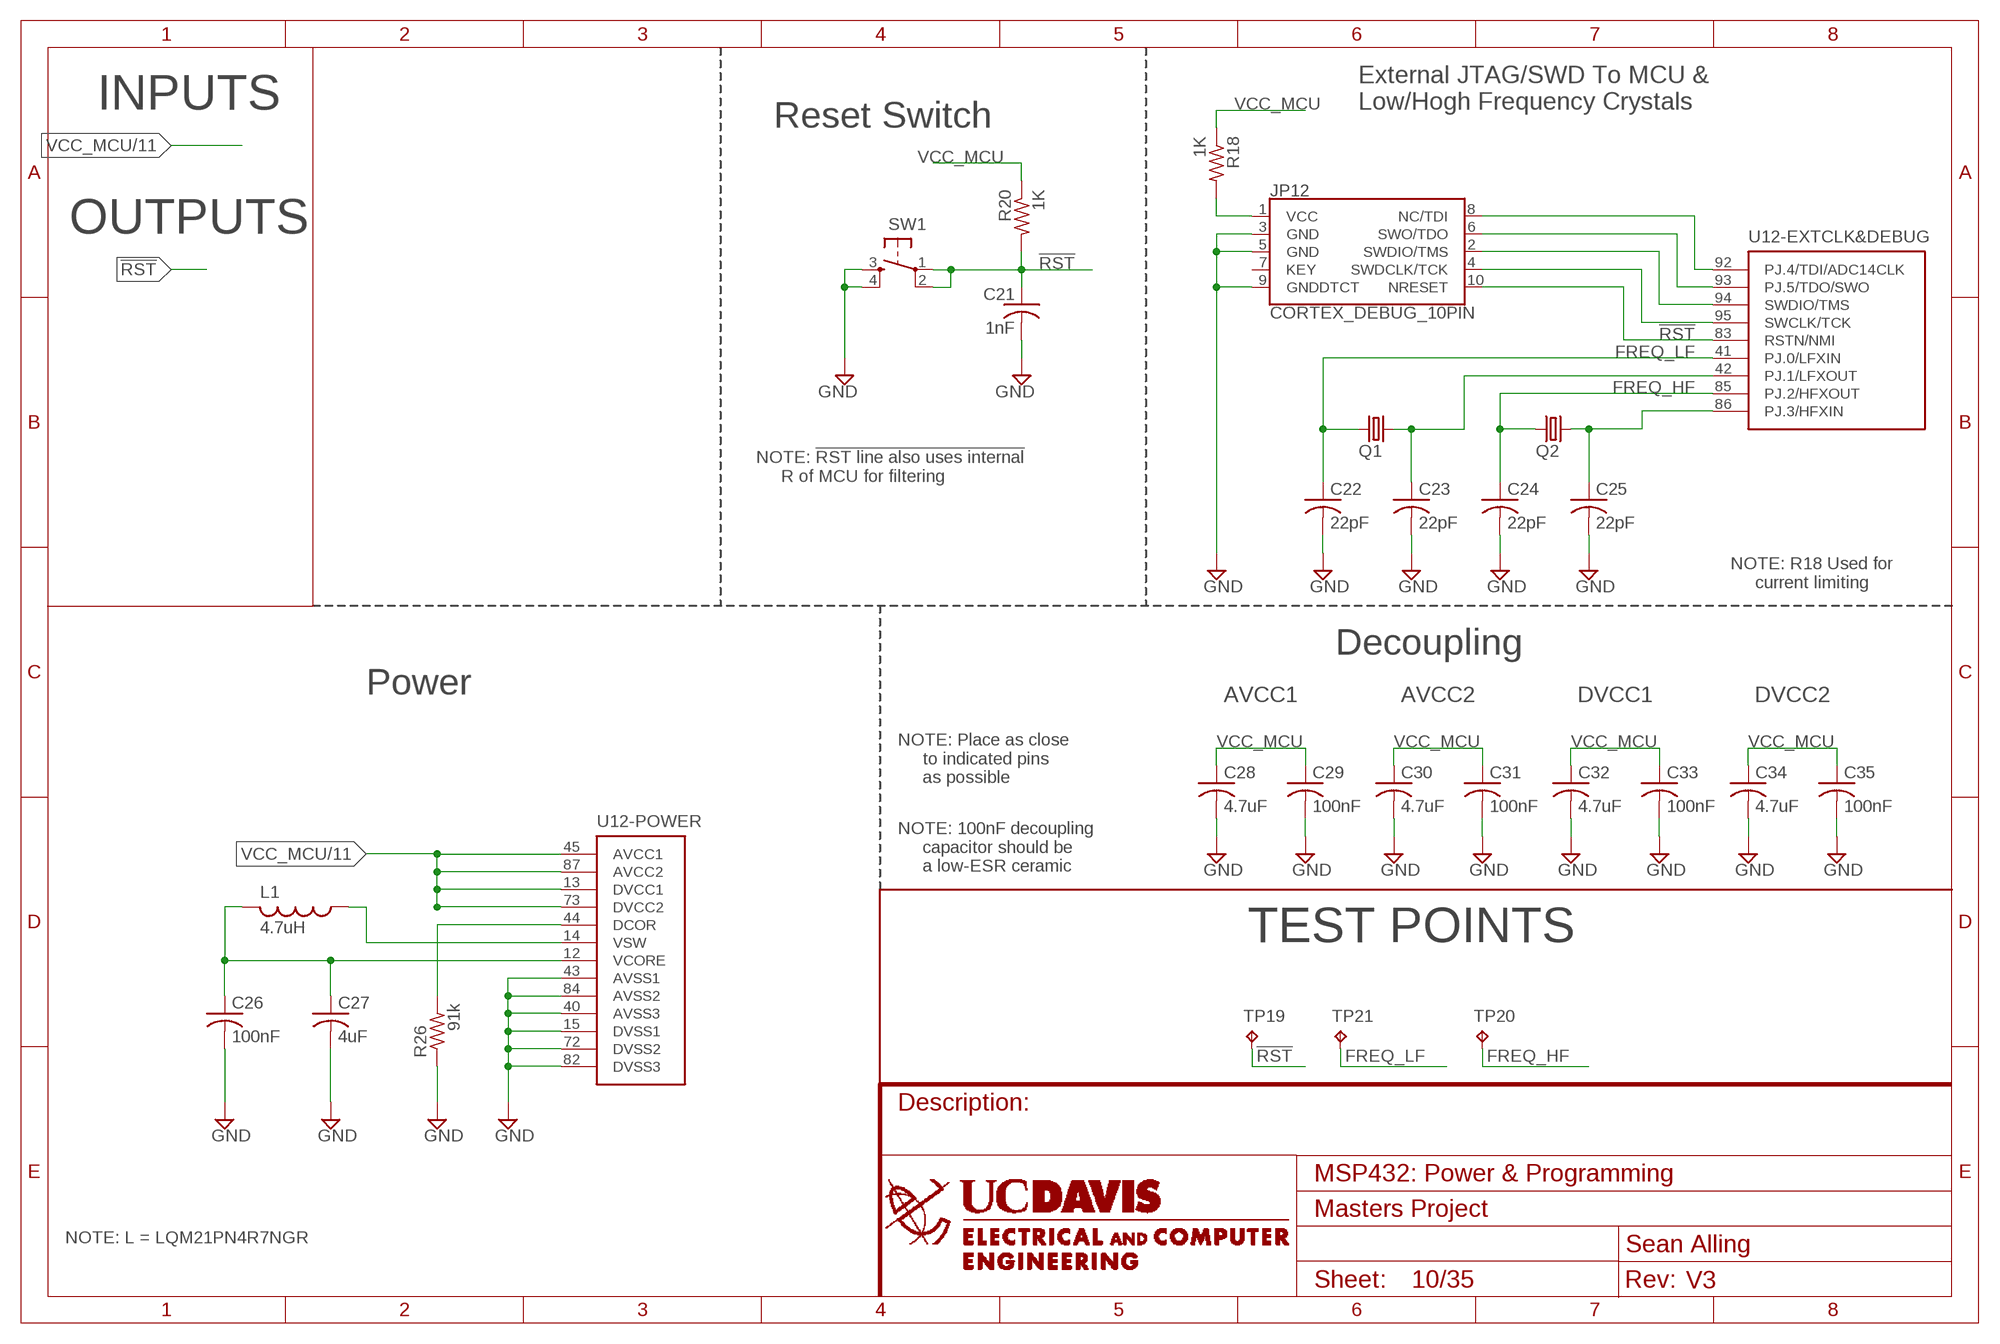
[diagram p9: schematic, sheet 10]

### Parts
C21  1nF  C-USC0603  [C0603]
C22  22pF  C-USC0603  [C0603]
C23  22pF  C-USC0603  [C0603]
C24  22pF  C-USC0603  [C0603]
C25  22pF  C-USC0603  [C0603]
C26  100nF  C-USC0603  [C0603]
C27  4uF  C-USC0603  [C0603]
C28  4.7uF  C-USC0603  [C0603]
C29  100nF  C-USC0603  [C0603]
C30  4.7uF  C-USC0603  [C0603]
C31  100nF  C-USC0603  [C0603]
C32  4.7uF  C-USC0603  [C0603]
C33  100nF  C-USC0603  [C0603]
C34  4.7uF  C-USC0603  [C0603]
C35  100nF  C-USC0603  [C0603]
JP12  CORTEX_DEBUG_10PIN  [CORTEX_DEBUG_10PIN]
L1  4.7uH  L-US  [L-USL0805]
Q1  CPFBZ-A2C4-32.768KD6  [CPFBZ-A2C4-32.768KD6]
Q2  ABM8-48.000MHZ-B2-T  [CRYSTAL_4-SMD]
R18  1K  R-US_R0603  [R0603]
R20  1K  R-US_R0603  [R0603]
R26  91k  R-US_R0603  [R0603]
SW1  TACTILE-SWITCH-SMT  [7914G]
TP19  TPB1,27  [B1,27]
TP20  TPB1,27  [B1,27]
TP21  TPB1,27  [B1,27]
U12  MSP432P401R  [LQFP100]

### Nets
!RST: C21.1 JP12.10(NRESET) R20.2 SW1.1 SW1.2 TP19.TP U12.83(-EXTCLK&DEBUG:RSTN/NMI)
FREQ_HF: C24.1 Q2.P$1 TP20.TP U12.85(-EXTCLK&DEBUG:PJ.2/HFXOUT)
FREQ_LF: C22.1 Q1.P$1 TP21.TP U12.41(-EXTCLK&DEBUG:PJ.0/LFXIN)
GND: C21.2 C22.2 C23.2 C24.2 C25.2 C26.2 C27.2 C28.2 C29.2 C30.2 C31.2 C32.2 C33.2 C34.2 C35.2 JP12.3(GND) JP12.5(GND) JP12.9(GNDDTCT) R26.1 SW1.3 SW1.4 U12.15(-POWER:DVSS1) U12.40(-POWER:AVSS3) U12.43(-POWER:AVSS1) U12.72(-POWER:DVSS2) U12.82(-POWER:DVSS3) U12.84(-POWER:AVSS2) ; also sheet 3,4,5,6,7,8,9,12,13,14,15,16
N$1: JP12.1(VCC) R18.2
N$18: R26.2 U12.44(-POWER:DCOR)
N$19: L1.1 U12.14(-POWER:VSW)
N$51: C26.1 C27.1 L1.2 U12.12(-POWER:VCORE)
N$132: JP12.2(SWDIO/TMS) U12.94(-EXTCLK&DEBUG:SWDIO/TMS)
N$133: JP12.6(SWO/TDO) U12.93(-EXTCLK&DEBUG:PJ.5/TDO/SWO)
N$134: JP12.8(NC/TDI) U12.92(-EXTCLK&DEBUG:PJ.4/TDI/ADC14CLK)
N$135: C23.1 Q1.P$4 U12.42(-EXTCLK&DEBUG:PJ.1/LFXOUT)
N$138: JP12.4(SWDCLK/TCK) U12.95(-EXTCLK&DEBUG:SWCLK/TCK)
N$140: C25.1 Q2.P$3 U12.86(-EXTCLK&DEBUG:PJ.3/HFXIN)
VCC_MCU: C28.1 C29.1 C30.1 C31.1 C32.1 C33.1 C34.1 C35.1 R18.1 R20.1 U12.13(-POWER:DVCC1) U12.45(-POWER:AVCC1) U12.73(-POWER:DVCC2) U12.87(-POWER:AVCC2) ; also sheet 4,5,11,12
Unconnected: JP12.7(KEY)

### Notes on the sheet
- INPUTS
- External JTAG/SWD To MCU & 
  Low/Hogh Frequency Crystals
- Reset Switch
- OUTPUTS
- NOTE: !RST line also uses internal
       R of MCU for filtering
- NOTE: R18 Used for
       current limiting
- Decoupling
- Power | AVCC1 | AVCC2 | DVCC1 | DVCC2
- NOTE: Place as close
       to indicated pins
       as possible
- NOTE: 100nF decoupling
       capacitor should be
       a low-ESR ceramic
- TEST POINTS
- NOTE: L = LQM21PN4R7NGR

## Sheet 11 of 35: MSP432: I/O
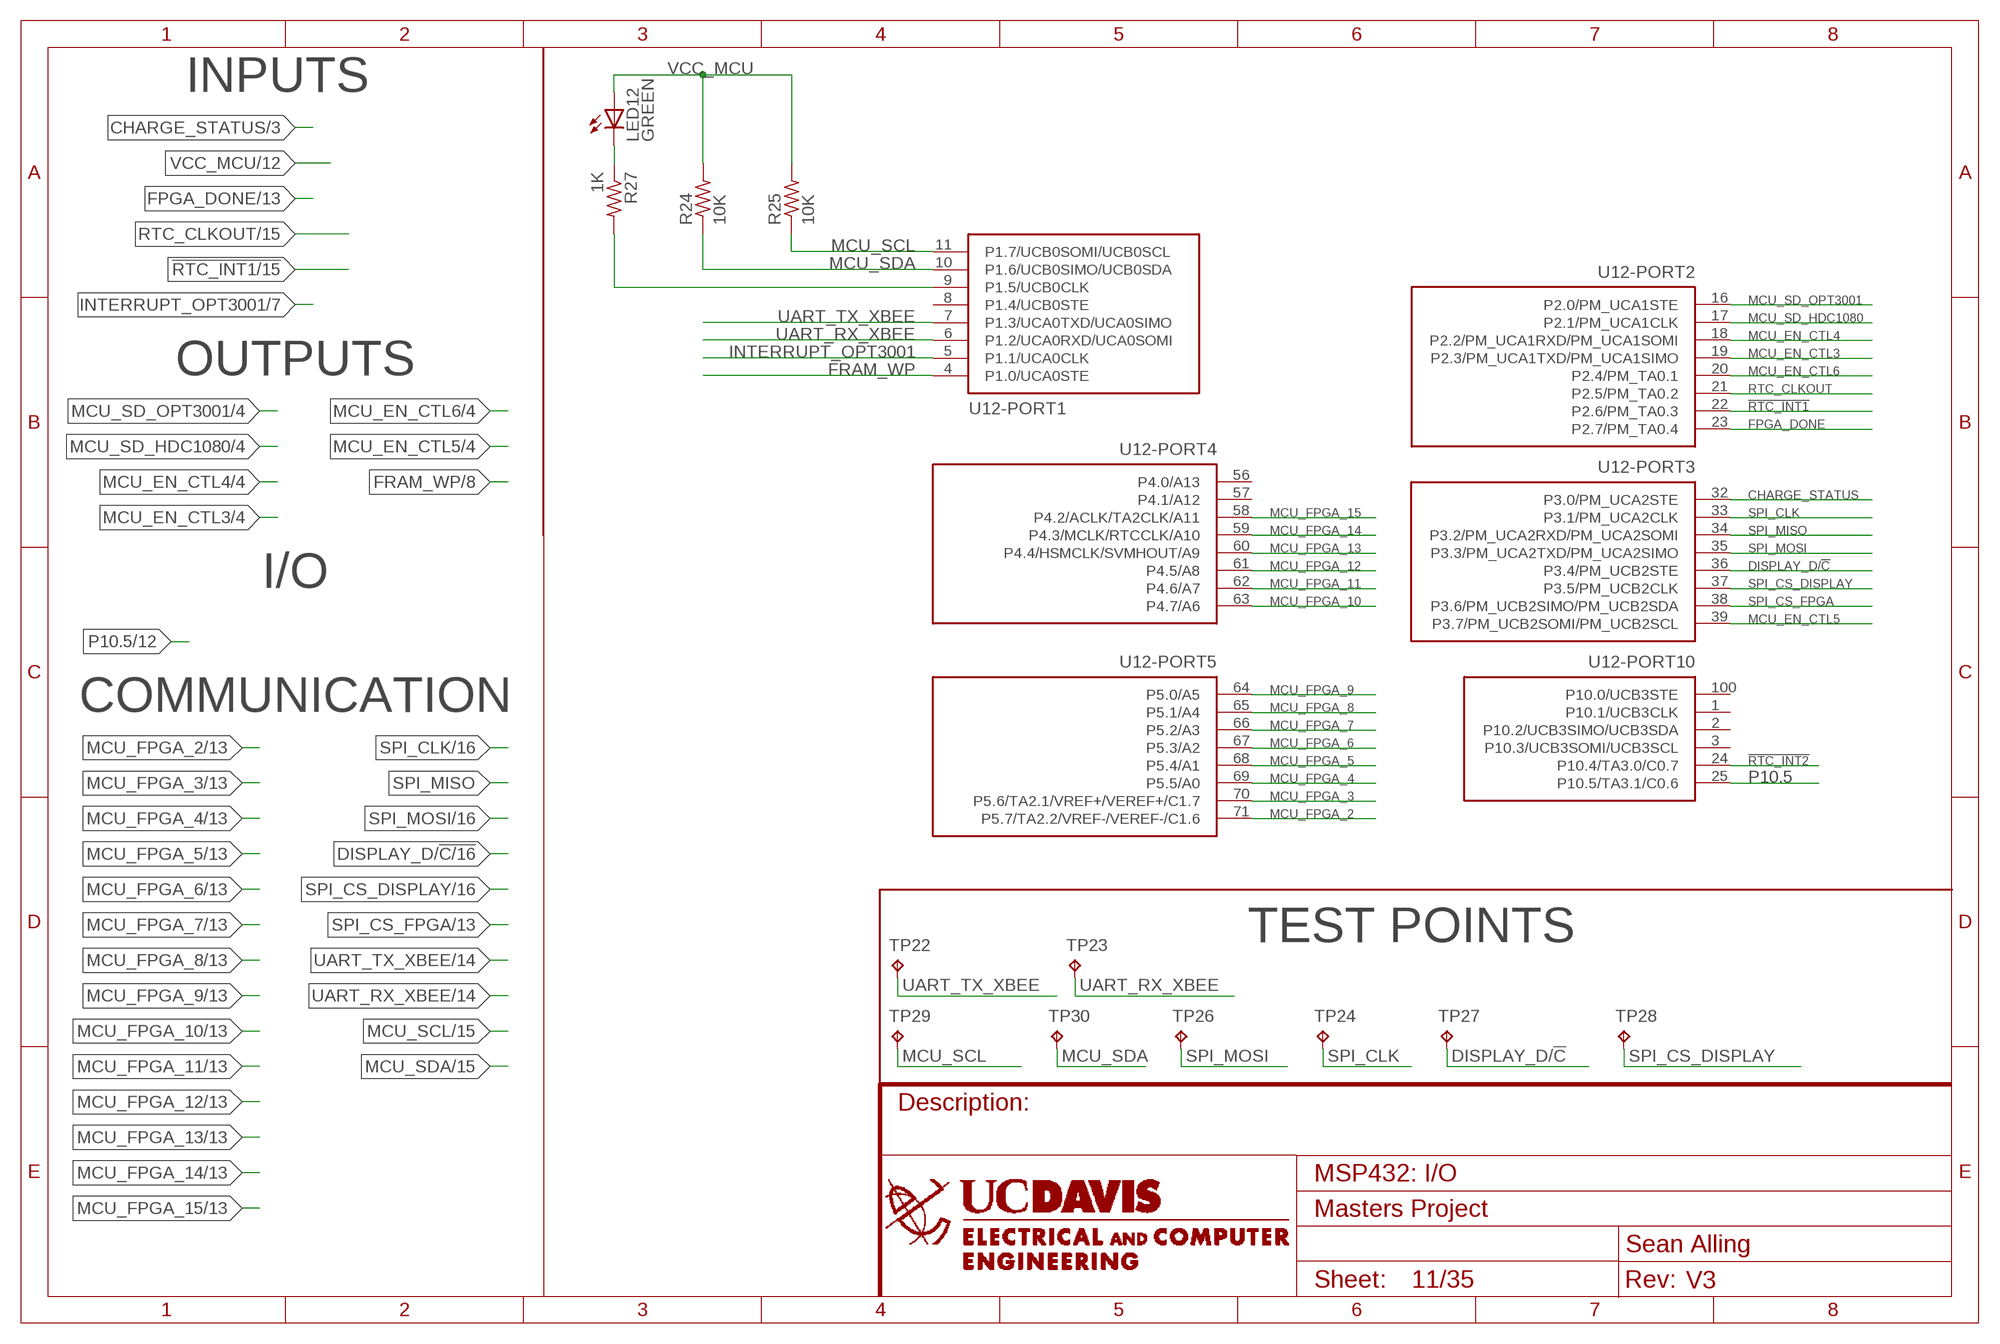
[diagram p10: schematic, sheet 11]

### Parts
LED12  GREEN  LEDCHIPLED_0603  [CHIPLED_0603]
R24  10K  R-US_R0603  [R0603]
R25  10K  R-US_R0603  [R0603]
R27  1K  R-US_R0603  [R0603]
TP22  TPB1,27  [B1,27]
TP23  TPB1,27  [B1,27]
TP24  TPB1,27  [B1,27]
TP26  TPB1,27  [B1,27]
TP27  TPB1,27  [B1,27]
TP28  TPB1,27  [B1,27]
TP29  TPB1,27  [B1,27]
TP30  TPB1,27  [B1,27]

### Nets
!RTC_INT1: U12.22(-PORT2:P2.6/PM_TA0.3) ; also sheet 15
!RTC_INT2: U12.24(-PORT10:P10.4/TA3.0/C0.7) ; also sheet 15
CHARGE_STATUS: U12.32(-PORT3:P3.0/PM_UCA2STE) ; also sheet 3
DISPLAY_D/!C: TP27.TP U12.36(-PORT3:P3.4/PM_UCB2STE) ; also sheet 16
FPGA_DONE: U12.23(-PORT2:P2.7/PM_TA0.4) ; also sheet 13
FRAM_WP: U12.4(-PORT1:P1.0/UCA0STE) ; also sheet 8
INTERRUPT_OPT3001: U12.5(-PORT1:P1.1/UCA0CLK) ; also sheet 7
MCU_EN_CTL3: U12.19(-PORT2:P2.3/PM_UCA1TXD/PM_UCA1SIMO) ; also sheet 4
MCU_EN_CTL4: U12.18(-PORT2:P2.2/PM_UCA1RXD/PM_UCA1SOMI) ; also sheet 4
MCU_EN_CTL5: U12.39(-PORT3:P3.7/PM_UCB2SOMI/PM_UCB2SCL) ; also sheet 4
MCU_EN_CTL6: U12.20(-PORT2:P2.4/PM_TA0.1) ; also sheet 4
MCU_FPGA_2: U12.71(-PORT5:P5.7/TA2.2/VREF-/VEREF-/C1.6) ; also sheet 13
MCU_FPGA_3: U12.70(-PORT5:P5.6/TA2.1/VREF+/VEREF+/C1.7) ; also sheet 13
MCU_FPGA_4: U12.69(-PORT5:P5.5/A0) ; also sheet 13
MCU_FPGA_5: U12.68(-PORT5:P5.4/A1) ; also sheet 13
MCU_FPGA_6: U12.67(-PORT5:P5.3/A2) ; also sheet 13
MCU_FPGA_7: U12.66(-PORT5:P5.2/A3) ; also sheet 13
MCU_FPGA_8: U12.65(-PORT5:P5.1/A4) ; also sheet 13
MCU_FPGA_9: U12.64(-PORT5:P5.0/A5) ; also sheet 13
MCU_FPGA_10: U12.63(-PORT4:P4.7/A6) ; also sheet 13
MCU_FPGA_11: U12.62(-PORT4:P4.6/A7) ; also sheet 13
MCU_FPGA_12: U12.61(-PORT4:P4.5/A8) ; also sheet 13
MCU_FPGA_13: U12.60(-PORT4:P4.4/HSMCLK/SVMHOUT/A9) ; also sheet 13
MCU_FPGA_14: U12.59(-PORT4:P4.3/MCLK/RTCCLK/A10) ; also sheet 13
MCU_FPGA_15: U12.58(-PORT4:P4.2/ACLK/TA2CLK/A11) ; also sheet 13
MCU_SCL: R25.1 TP29.TP U12.11(-PORT1:P1.7/UCB0SOMI/UCB0SCL) ; also sheet 6,7,8,15
MCU_SD_HDC1080: U12.17(-PORT2:P2.1/PM_UCA1CLK) ; also sheet 4
MCU_SD_OPT3001: U12.16(-PORT2:P2.0/PM_UCA1STE) ; also sheet 4
MCU_SDA: R24.1 TP30.TP U12.10(-PORT1:P1.6/UCB0SIMO/UCB0SDA) ; also sheet 6,7,8,15
N$4: R27.2 U12.9(-PORT1:P1.5/UCB0CLK)
N$9: LED12.C R27.1
P10.5: U12.25(-PORT10:P10.5/TA3.1/C0.6) ; also sheet 12
RTC_CLKOUT: U12.21(-PORT2:P2.5/PM_TA0.2) ; also sheet 15
SPI_CLK: TP24.TP U12.33(-PORT3:P3.1/PM_UCA2CLK) ; also sheet 16
SPI_CS_DISPLAY: TP28.TP U12.37(-PORT3:P3.5/PM_UCB2CLK) ; also sheet 16
SPI_CS_FPGA: U12.38(-PORT3:P3.6/PM_UCB2SIMO/PM_UCB2SDA) ; also sheet 13
SPI_MISO: U12.34(-PORT3:P3.2/PM_UCA2RXD/PM_UCA2SOMI)
SPI_MOSI: TP26.TP U12.35(-PORT3:P3.3/PM_UCA2TXD/PM_UCA2SIMO) ; also sheet 16
UART_RX_XBEE: TP23.TP U12.6(-PORT1:P1.2/UCA0RXD/UCA0SOMI) ; also sheet 14
UART_TX_XBEE: TP22.TP U12.7(-PORT1:P1.3/UCA0TXD/UCA0SIMO) ; also sheet 14
VCC_MCU: LED12.A R24.2 R25.2 ; also sheet 4,5,10,12
Unconnected: U12.1(-PORT10:P10.1/UCB3CLK) U12.2(-PORT10:P10.2/UCB3SIMO/UCB3SDA) U12.3(-PORT10:P10.3/UCB3SOMI/UCB3SCL) U12.8(-PORT1:P1.4/UCB0STE) U12.56(-PORT4:P4.0/A13) U12.57(-PORT4:P4.1/A12) U12.100(-PORT10:P10.0/UCB3STE)

### Notes on the sheet
- INPUTS
- OUTPUTS
- I/O
- COMMUNICATION
- TEST POINTS

## Sheet 12 of 35: MSP432: I/I Cont.
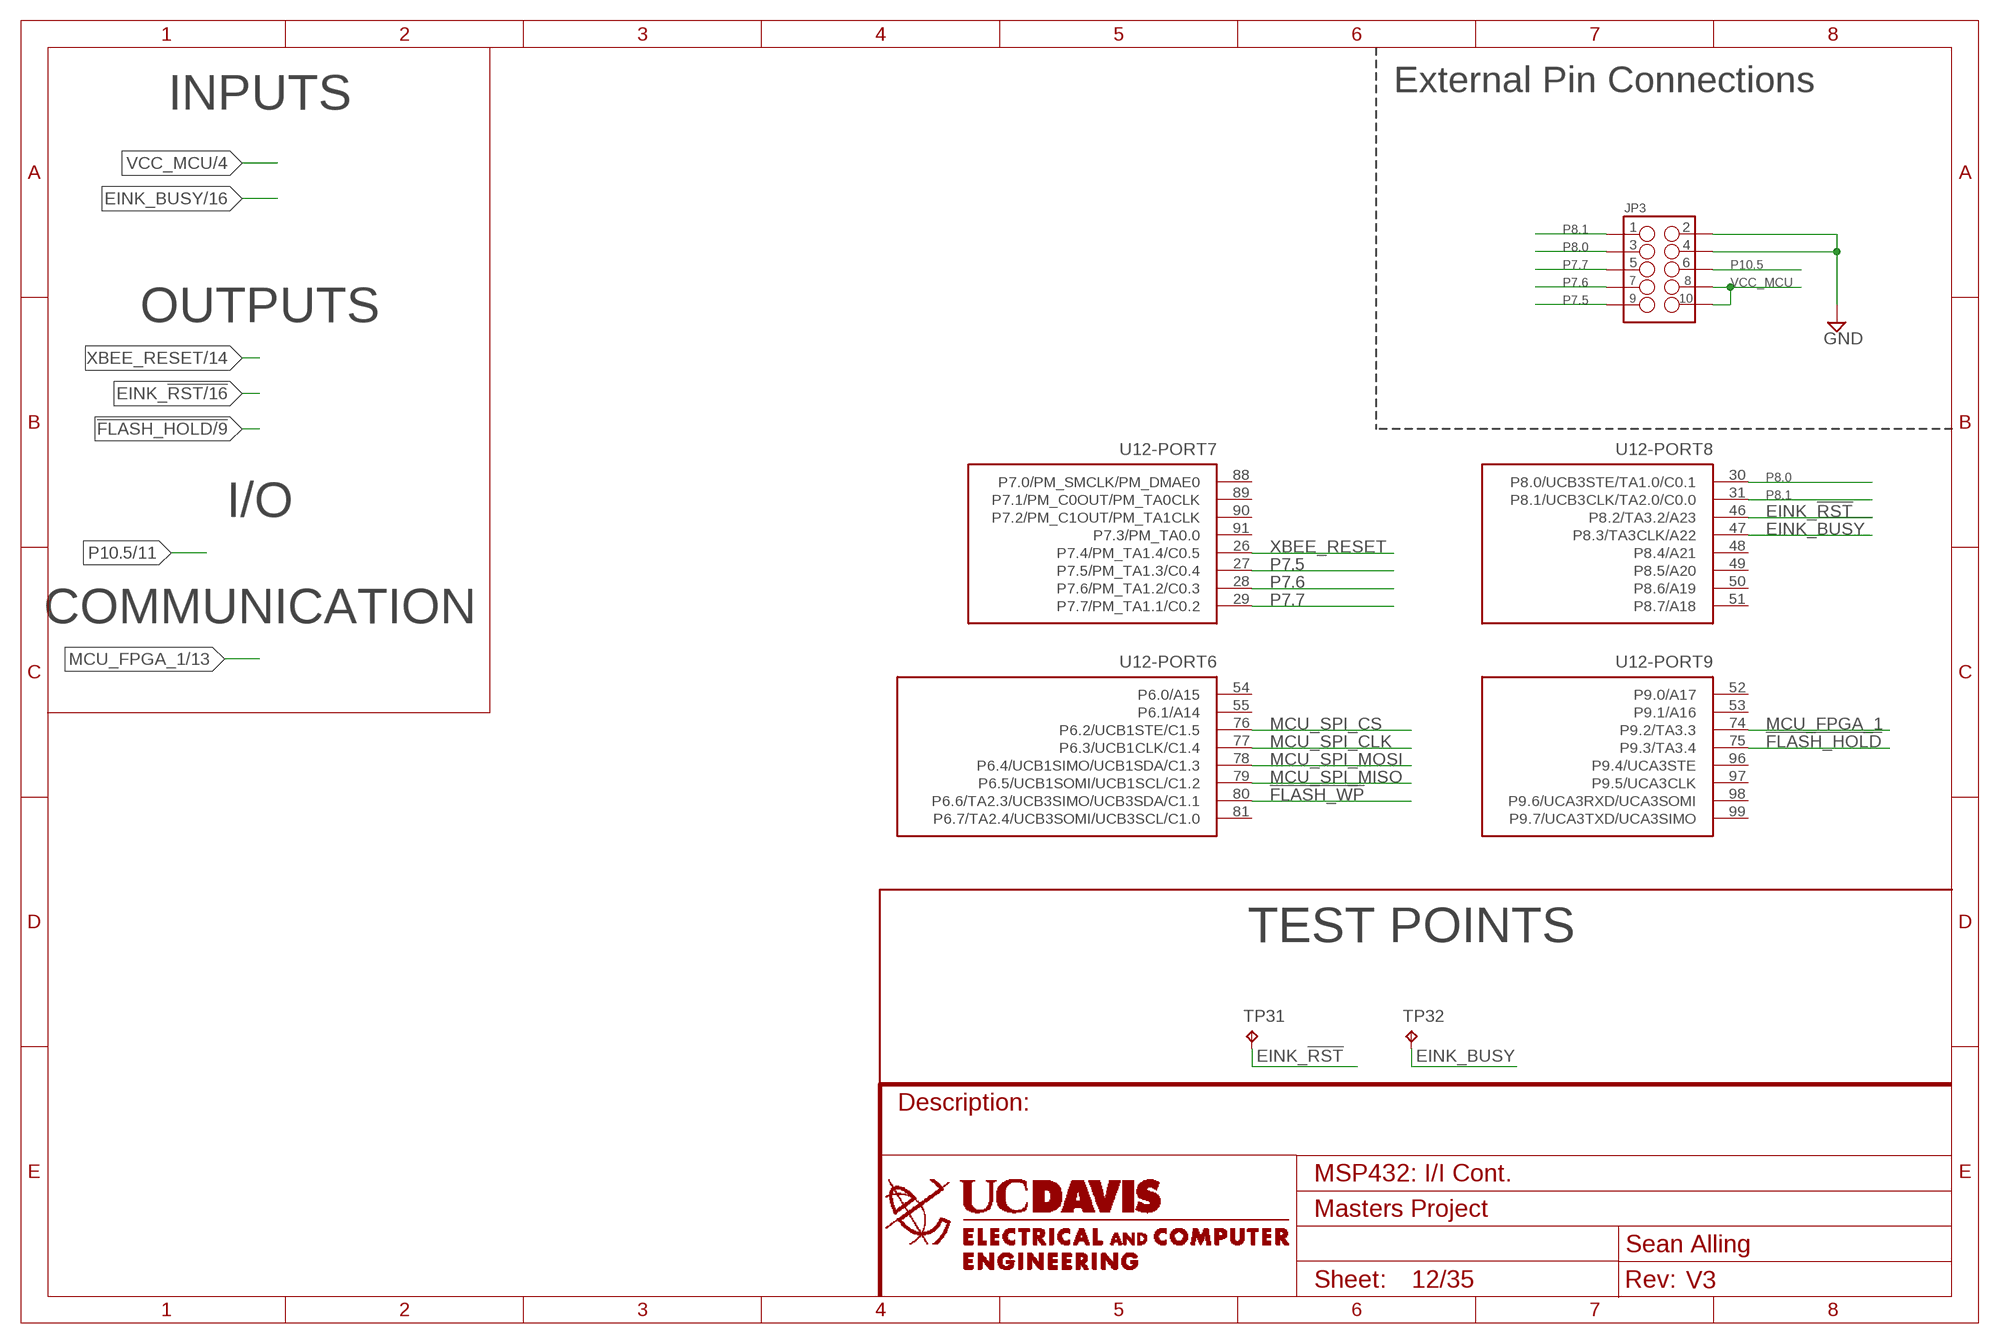
[diagram p11: schematic, sheet 12]

### Parts
JP3  2X5_HEADER1.27MM  [CORTEX_DEBUG_10PIN]
TP31  TPB1,27  [B1,27]
TP32  TPB1,27  [B1,27]

### Nets
!FLASH_HOLD: U12.75(-PORT9:P9.3/TA3.4) ; also sheet 9
!FLASH_WP: U12.80(-PORT6:P6.6/TA2.3/UCB3SIMO/UCB3SDA/C1.1) ; also sheet 9
EINK_!RST: TP31.TP U12.46(-PORT8:P8.2/TA3.2/A23) ; also sheet 16
EINK_BUSY: TP32.TP U12.47(-PORT8:P8.3/TA3CLK/A22) ; also sheet 16
GND: JP3.2 JP3.4 ; also sheet 3,4,5,6,7,8,9,10,13,14,15,16
MCU_FPGA_1: U12.74(-PORT9:P9.2/TA3.3) ; also sheet 13
MCU_SPI_CLK: U12.77(-PORT6:P6.3/UCB1CLK/C1.4) ; also sheet 9
MCU_SPI_CS: U12.76(-PORT6:P6.2/UCB1STE/C1.5) ; also sheet 9
MCU_SPI_MISO: U12.79(-PORT6:P6.5/UCB1SOMI/UCB1SCL/C1.2) ; also sheet 9
MCU_SPI_MOSI: U12.78(-PORT6:P6.4/UCB1SIMO/UCB1SDA/C1.3) ; also sheet 9
P7.5: JP3.9 U12.27(-PORT7:P7.5/PM_TA1.3/C0.4)
P7.6: JP3.7 U12.28(-PORT7:P7.6/PM_TA1.2/C0.3)
P7.7: JP3.5 U12.29(-PORT7:P7.7/PM_TA1.1/C0.2)
P8.0: JP3.3 U12.30(-PORT8:P8.0/UCB3STE/TA1.0/C0.1)
P8.1: JP3.1 U12.31(-PORT8:P8.1/UCB3CLK/TA2.0/C0.0)
P10.5: JP3.6 ; also sheet 11
VCC_MCU: JP3.8 JP3.10 ; also sheet 4,5,10,11
XBEE_RESET: U12.26(-PORT7:P7.4/PM_TA1.4/C0.5) ; also sheet 14
Unconnected: U12.48(-PORT8:P8.4/A21) U12.49(-PORT8:P8.5/A20) U12.50(-PORT8:P8.6/A19) U12.51(-PORT8:P8.7/A18) U12.52(-PORT9:P9.0/A17) U12.53(-PORT9:P9.1/A16) U12.54(-PORT6:P6.0/A15) U12.55(-PORT6:P6.1/A14) U12.81(-PORT6:P6.7/TA2.4/UCB3SOMI/UCB3SCL/C1.0) U12.88(-PORT7:P7.0/PM_SMCLK/PM_DMAE0) U12.89(-PORT7:P7.1/PM_C0OUT/PM_TA0CLK) U12.90(-PORT7:P7.2/PM_C1OUT/PM_TA1CLK) U12.91(-PORT7:P7.3/PM_TA0.0) U12.96(-PORT9:P9.4/UCA3STE) U12.97(-PORT9:P9.5/UCA3CLK) U12.98(-PORT9:P9.6/UCA3RXD/UCA3SOMI) U12.99(-PORT9:P9.7/UCA3TXD/UCA3SIMO)

### Notes on the sheet
- INPUTS | External Pin Connections
- OUTPUTS
- I/O
- COMMUNICATION
- TEST POINTS

## Sheet 13 of 35: FPGA
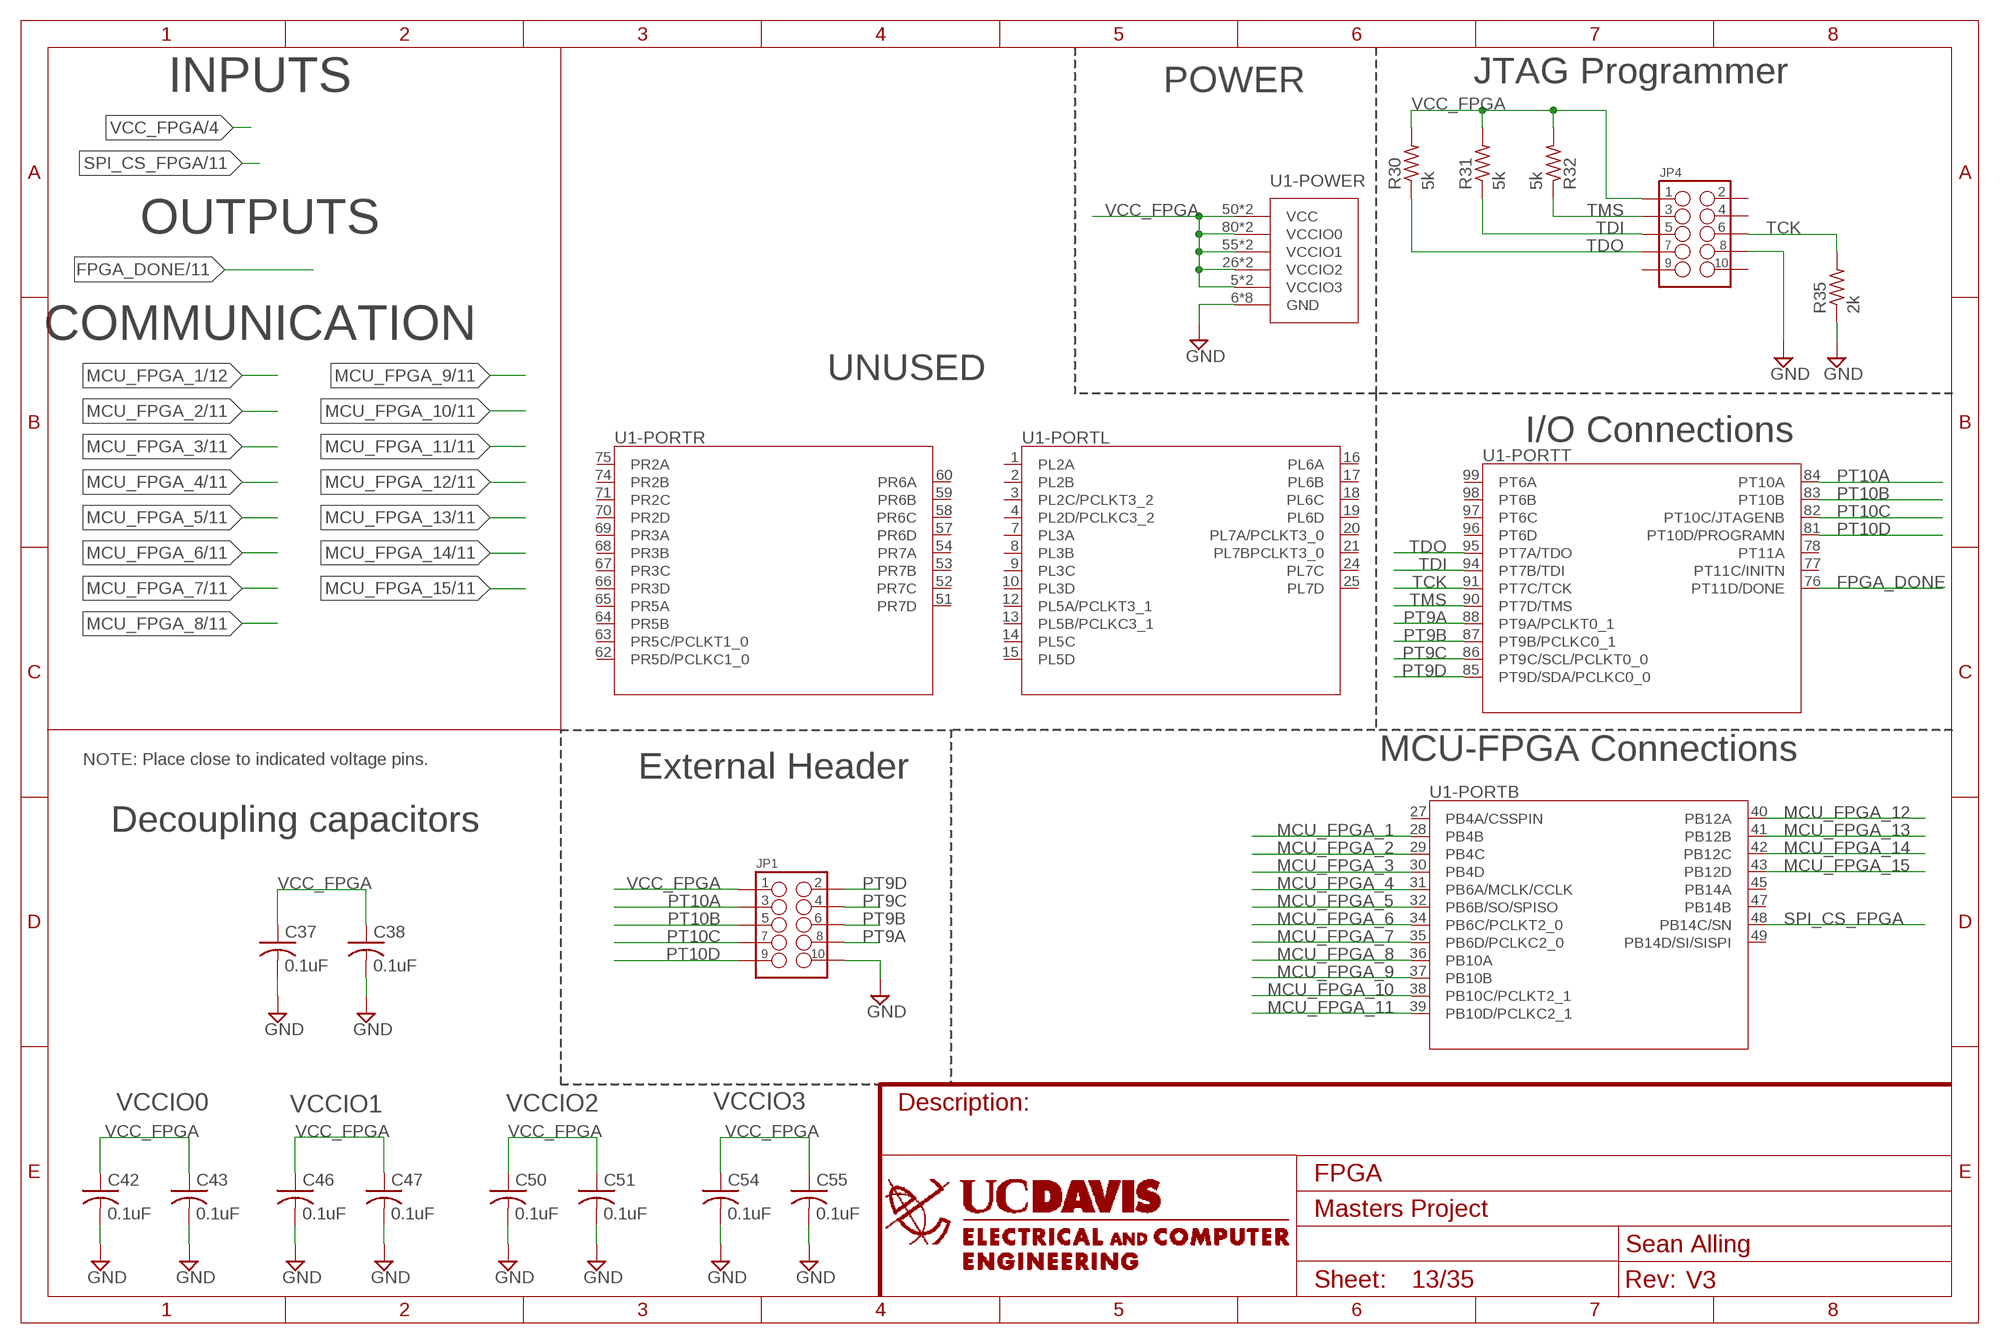
[diagram p12: schematic, sheet 13]

### Parts
C37  0.1uF  C-USC0603  [C0603]
C38  0.1uF  C-USC0603  [C0603]
C42  0.1uF  C-USC0603  [C0603]
C43  0.1uF  C-USC0603  [C0603]
C46  0.1uF  C-USC0603  [C0603]
C47  0.1uF  C-USC0603  [C0603]
C50  0.1uF  C-USC0603  [C0603]
C51  0.1uF  C-USC0603  [C0603]
C54  0.1uF  C-USC0603  [C0603]
C55  0.1uF  C-USC0603  [C0603]
JP1  2X5_HEADER1.27MM  [CORTEX_DEBUG_10PIN]
JP4  2X5_HEADER1.27MM  [CORTEX_DEBUG_10PIN]
R30  5k  R-US_R0603  [R0603]
R31  5k  R-US_R0603  [R0603]
R32  5k  R-US_R0603  [R0603]
R35  2k  R-US_R0603  [R0603]
U1  LCMXO2-640HC-4TG100C-NEW  [QFP50P1600X1600X160-100N]

### Nets
FPGA_DONE: U1.76(-PORTT:PT11D/DONE) ; also sheet 11
GND: C37.2 C38.2 C42.2 C43.2 C46.2 C47.2 C50.2 C51.2 C54.2 C55.2 JP1.10 JP4.8 R35.1 U1.6(-POWER:GND) U1.22(-POWER:GND) U1.33(-POWER:GND) U1.44(-POWER:GND) U1.56(-POWER:GND) U1.72(-POWER:GND) U1.79(-POWER:GND) U1.92(-POWER:GND) ; also sheet 3,4,5,6,7,8,9,10,12,14,15,16
MCU_FPGA_1: U1.28(-PORTB:PB4B) ; also sheet 12
MCU_FPGA_2: U1.29(-PORTB:PB4C) ; also sheet 11
MCU_FPGA_3: U1.30(-PORTB:PB4D) ; also sheet 11
MCU_FPGA_4: U1.31(-PORTB:PB6A/MCLK/CCLK) ; also sheet 11
MCU_FPGA_5: U1.32(-PORTB:PB6B/SO/SPISO) ; also sheet 11
MCU_FPGA_6: U1.34(-PORTB:PB6C/PCLKT2_0) ; also sheet 11
MCU_FPGA_7: U1.35(-PORTB:PB6D/PCLKC2_0) ; also sheet 11
MCU_FPGA_8: U1.36(-PORTB:PB10A) ; also sheet 11
MCU_FPGA_9: U1.37(-PORTB:PB10B) ; also sheet 11
MCU_FPGA_10: U1.38(-PORTB:PB10C/PCLKT2_1) ; also sheet 11
MCU_FPGA_11: U1.39(-PORTB:PB10D/PCLKC2_1) ; also sheet 11
MCU_FPGA_12: U1.40(-PORTB:PB12A) ; also sheet 11
MCU_FPGA_13: U1.41(-PORTB:PB12B) ; also sheet 11
MCU_FPGA_14: U1.42(-PORTB:PB12C) ; also sheet 11
MCU_FPGA_15: U1.43(-PORTB:PB12D) ; also sheet 11
PT9A: JP1.8 U1.88(-PORTT:PT9A/PCLKT0_1)
PT9B: JP1.6 U1.87(-PORTT:PT9B/PCLKC0_1)
PT9C: JP1.4 U1.86(-PORTT:PT9C/SCL/PCLKT0_0)
PT9D: JP1.2 U1.85(-PORTT:PT9D/SDA/PCLKC0_0)
PT10A: JP1.3 U1.84(-PORTT:PT10A)
PT10B: JP1.5 U1.83(-PORTT:PT10B)
PT10C: JP1.7 U1.82(-PORTT:PT10C/JTAGENB)
PT10D: JP1.9 U1.81(-PORTT:PT10D/PROGRAMN)
SPI_CS_FPGA: U1.48(-PORTB:PB14C/SN) ; also sheet 11
TCK: JP4.6 R35.2 U1.91(-PORTT:PT7C/TCK)
TDI: JP4.5 R31.1 U1.94(-PORTT:PT7B/TDI)
TDO: JP4.7 R30.1 U1.95(-PORTT:PT7A/TDO)
TMS: JP4.3 R32.1 U1.90(-PORTT:PT7D/TMS)
VCC_FPGA: C37.1 C38.1 C42.1 C43.1 C46.1 C47.1 C50.1 C51.1 C54.1 C55.1 JP1.1 JP4.1 R30.2 R31.2 R32.2 U1.5(-POWER:VCCIO3) U1.23(-POWER:VCCIO3) U1.26(-POWER:VCCIO2) U1.46(-POWER:VCCIO2) U1.50(-POWER:VCC) U1.55(-POWER:VCCIO1) U1.73(-POWER:VCCIO1) U1.80(-POWER:VCCIO0) U1.93(-POWER:VCCIO0) U1.100(-POWER:VCC) ; also sheet 4,5
Unconnected: JP4.2 JP4.4 JP4.9 JP4.10 U1.1(-PORTL:PL2A) U1.2(-PORTL:PL2B) U1.3(-PORTL:PL2C/PCLKT3_2) U1.4(-PORTL:PL2D/PCLKC3_2) U1.7(-PORTL:PL3A) U1.8(-PORTL:PL3B) U1.9(-PORTL:PL3C) U1.10(-PORTL:PL3D) U1.12(-PORTL:PL5A/PCLKT3_1) U1.13(-PORTL:PL5B/PCLKC3_1) U1.14(-PORTL:PL5C) U1.15(-PORTL:PL5D) U1.16(-PORTL:PL6A) U1.17(-PORTL:PL6B) U1.18(-PORTL:PL6C) U1.19(-PORTL:PL6D) U1.20(-PORTL:PL7A/PCLKT3_0) U1.21(-PORTL:PL7BPCLKT3_0) U1.24(-PORTL:PL7C) U1.25(-PORTL:PL7D) U1.27(-PORTB:PB4A/CSSPIN) U1.45(-PORTB:PB14A) U1.47(-PORTB:PB14B) U1.49(-PORTB:PB14D/SI/SISPI) U1.51(-PORTR:PR7D) U1.52(-PORTR:PR7C) U1.53(-PORTR:PR7B) U1.54(-PORTR:PR7A) U1.57(-PORTR:PR6D) U1.58(-PORTR:PR6C) U1.59(-PORTR:PR6B) U1.60(-PORTR:PR6A) U1.62(-PORTR:PR5D/PCLKC1_0) U1.63(-PORTR:PR5C/PCLKT1_0) U1.64(-PORTR:PR5B) U1.65(-PORTR:PR5A) U1.66(-PORTR:PR3D) U1.67(-PORTR:PR3C) U1.68(-PORTR:PR3B) U1.69(-PORTR:PR3A) U1.70(-PORTR:PR2D) U1.71(-PORTR:PR2C) U1.74(-PORTR:PR2B) U1.75(-PORTR:PR2A) U1.77(-PORTT:PT11C/INITN) U1.78(-PORTT:PT11A) U1.96(-PORTT:PT6D) U1.97(-PORTT:PT6C) U1.98(-PORTT:PT6B) U1.99(-PORTT:PT6A)

### Notes on the sheet
- INPUTS | JTAG Programmer
- POWER
- OUTPUTS
- COMMUNICATION
- UNUSED
- I/O Connections
- MCU-FPGA Connections
- NOTE: Place close to indicated voltage pins. | External Header
- Decoupling capacitors
- VCCIO0 | VCCIO1 | VCCIO2 | VCCIO3

## Sheet 14 of 35: Wireless: XBee
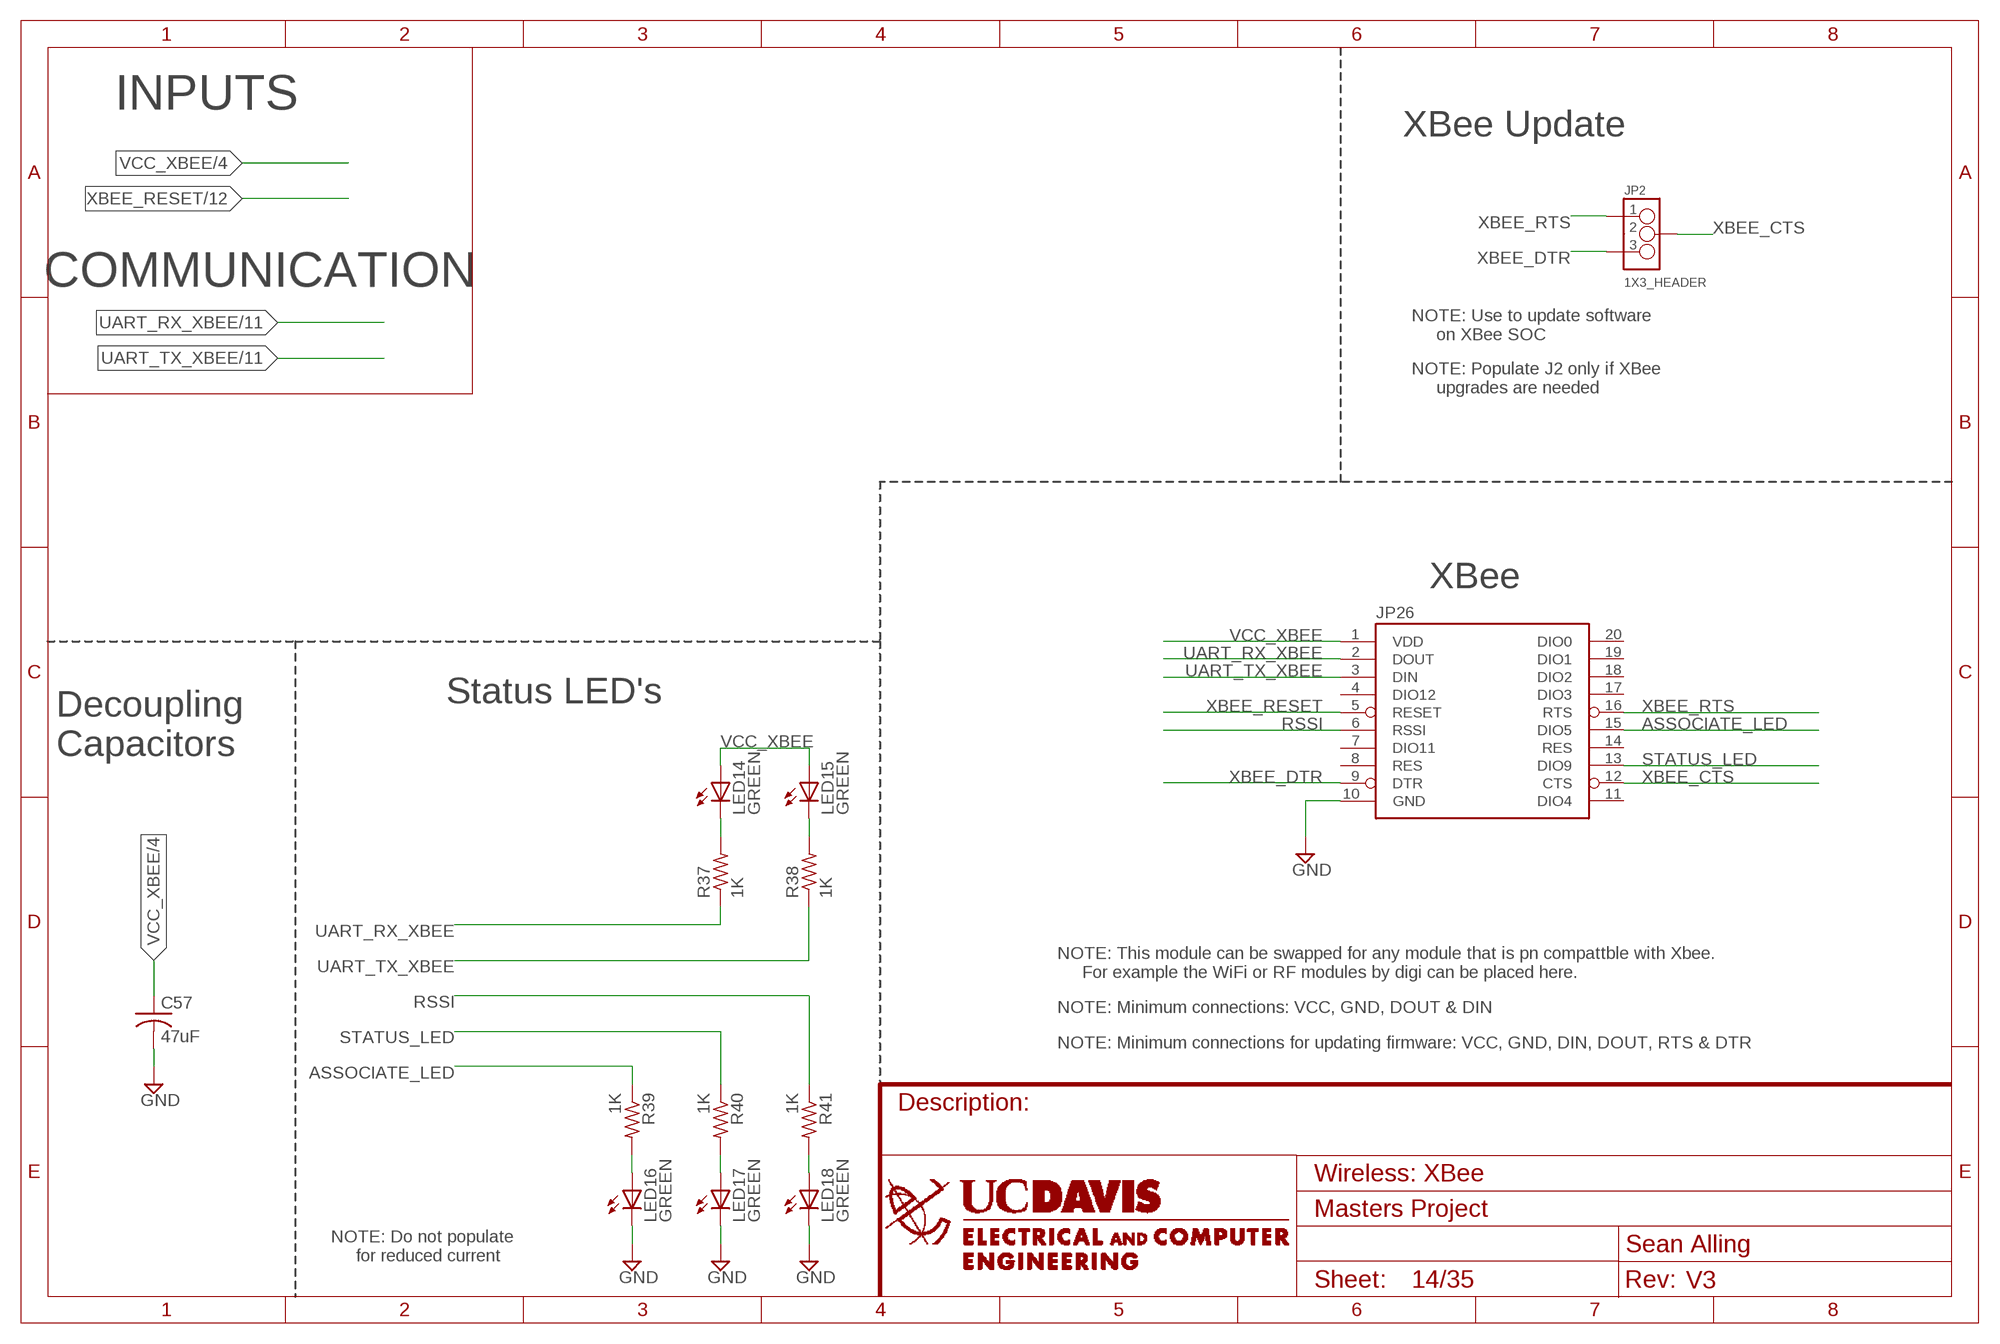
[diagram p13: schematic, sheet 14]

### Parts
C57  47uF  C-USC0603  [C0603]
JP2  1X3_HEADER  [1X3_FEMALE_HEADER_THROUGH_HOLE]
JP26  XBEE-1B1  [XBEE-1]
LED14  GREEN  LEDCHIPLED_0603  [CHIPLED_0603]
LED15  GREEN  LEDCHIPLED_0603  [CHIPLED_0603]
LED16  GREEN  LEDSML0805  [SML0805]
LED17  GREEN  LEDSML0805  [SML0805]
LED18  GREEN  LEDCHIPLED_0603  [CHIPLED_0603]
R37  1K  R-US_R0603  [R0603]
R38  1K  R-US_R0603  [R0603]
R39  1K  R-US_R0603  [R0603]
R40  1K  R-US_R0603  [R0603]
R41  1K  R-US_R0603  [R0603]

### Nets
ASSOCIATE_LED: JP26.15(DIO5) R39.1
GND: C57.2 JP26.10(GND) LED16.C LED17.C LED18.C ; also sheet 3,4,5,6,7,8,9,10,12,13,15,16
N$7: LED15.C R38.2
N$8: LED14.C R37.2
N$14: LED16.A R39.2
N$15: LED18.A R41.2
N$16: LED17.A R40.2
RSSI: JP26.6(RSSI) R41.1
STATUS_LED: JP26.13(DIO9) R40.1
UART_RX_XBEE: JP26.2(DOUT) R37.1 ; also sheet 11
UART_TX_XBEE: JP26.3(DIN) R38.1 ; also sheet 11
VCC_XBEE: C57.1 JP26.1(VDD) LED14.A LED15.A ; also sheet 4,5
XBEE_CTS: JP2.2 JP26.12(CTS)
XBEE_DTR: JP2.3 JP26.9(DTR)
XBEE_RESET: JP26.5(RESET) ; also sheet 12
XBEE_RTS: JP2.1 JP26.16(RTS)
Unconnected: JP26.4(DIO12) JP26.7(DIO11) JP26.8(RES) JP26.11(DIO4) JP26.14(RES) JP26.17(DIO3) JP26.18(DIO2) JP26.19(DIO1) JP26.20(DIO0)

### Notes on the sheet
- INPUTS
- XBee Update
- COMMUNICATION
- NOTE: Use to update software 
       on XBee SOC
- NOTE: Populate J2 only if XBee
       upgrades are needed
- XBee
- Status LED's
- Decoupling
  Capacitors
- NOTE: This module can be swapped for any module that is pn compattble with Xbee. 
       For example the WiFi or RF modules by digi can be placed here.
- NOTE: Minimum connections: VCC, GND, DOUT & DIN
- NOTE: Minimum connections for updating firmware: VCC, GND, DIN, DOUT, RTS & DTR
- NOTE: Do not populate 
       for reduced current

## Sheet 15 of 35: Real Time Clock
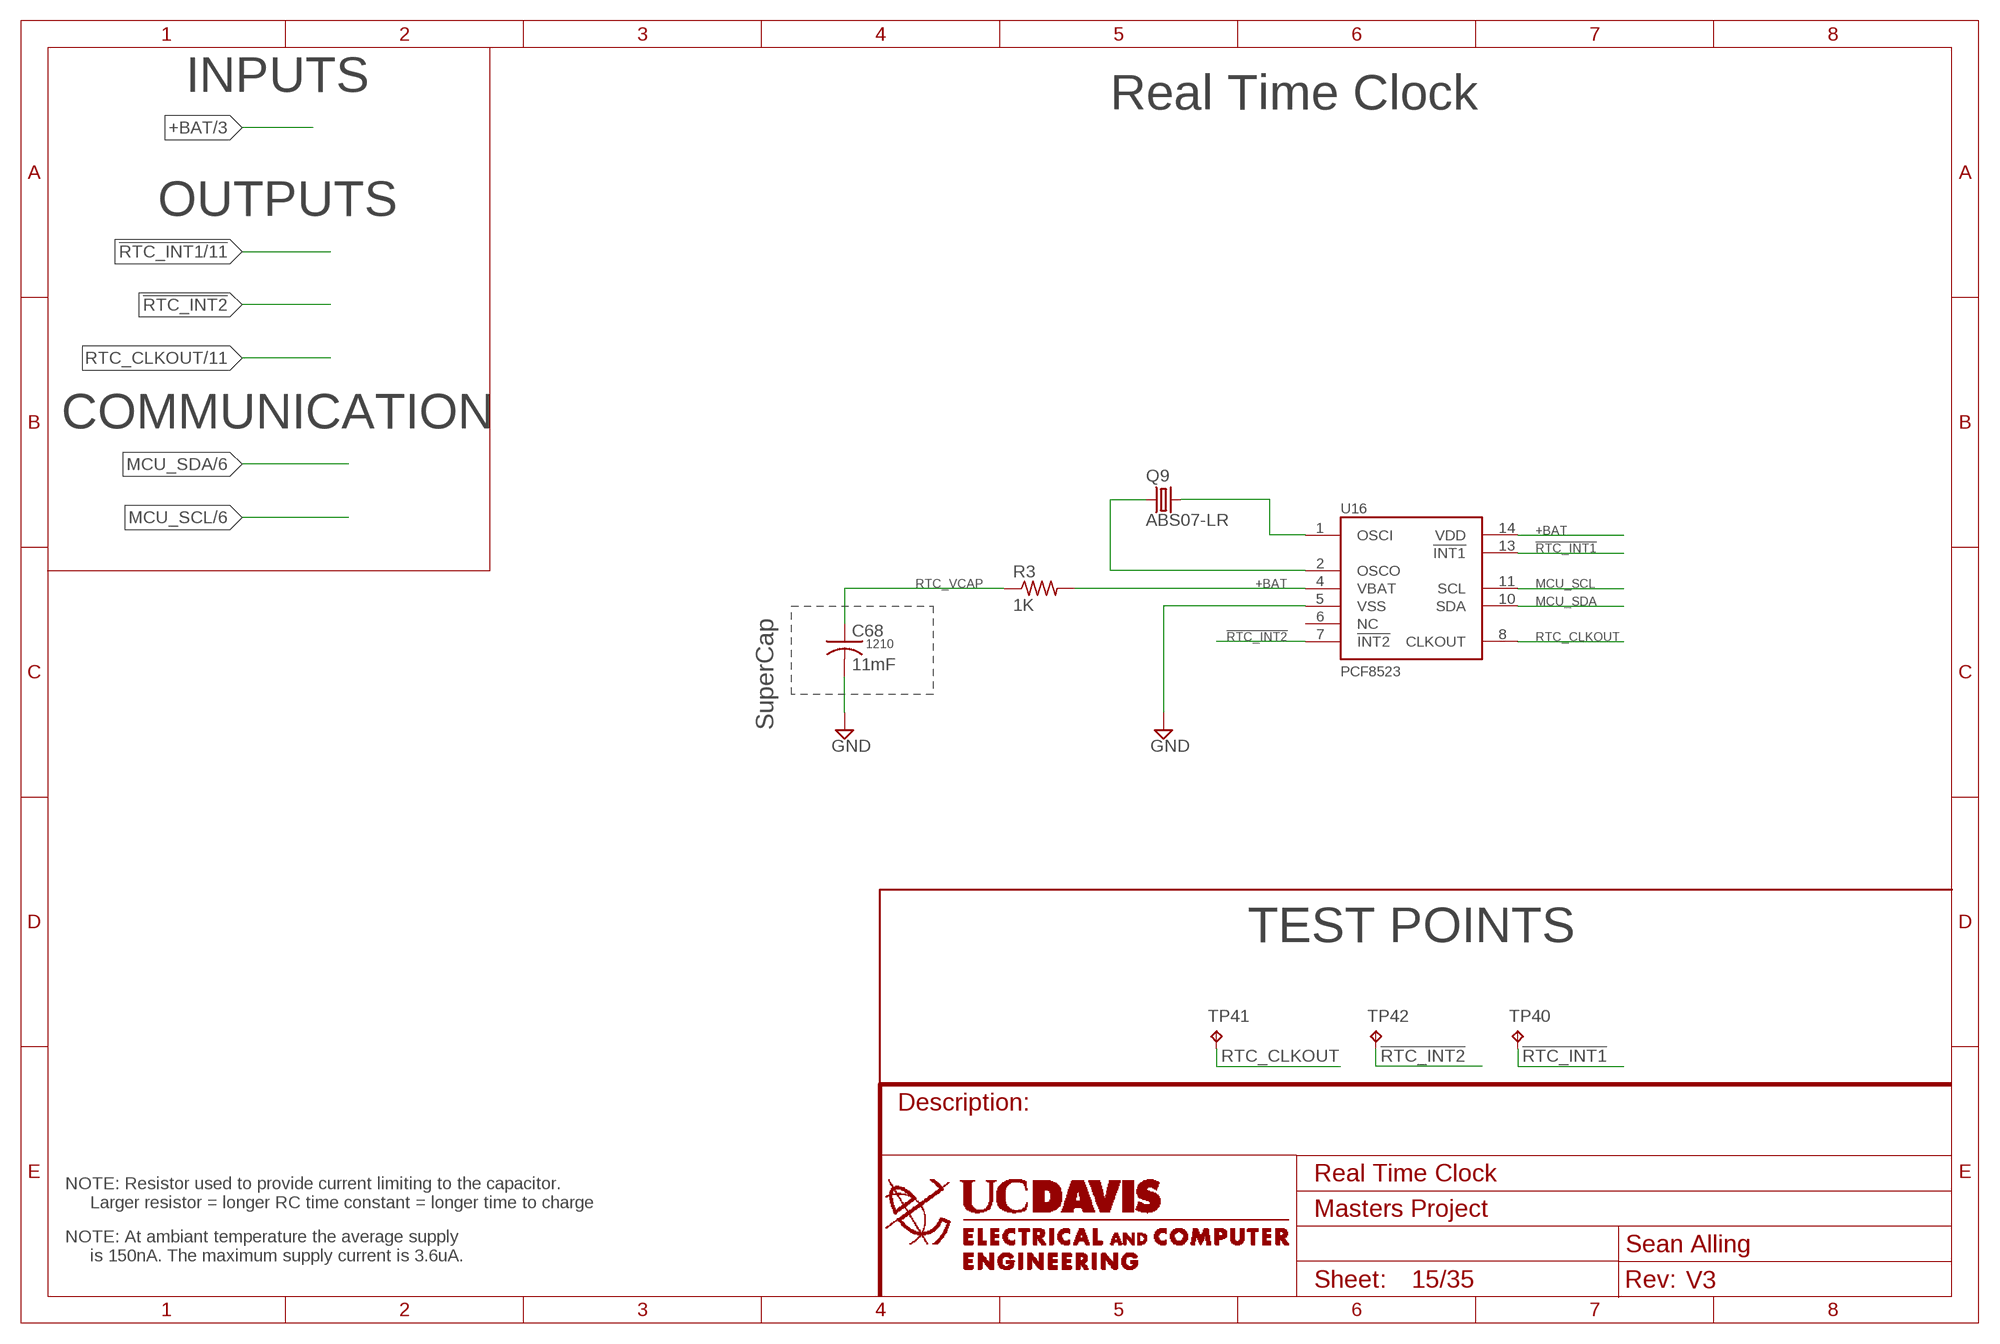
[diagram p14: schematic, sheet 15]

### Parts
C68  11mF  C-USC1210K  [C1210K]
Q9  ABS07-LR  [2-SMD]
R3  1K  R-US_R0603  [R0603]
TP40  TPB1,27  [B1,27]
TP41  TPB1,27  [B1,27]
TP42  TPB1,27  [B1,27]
U16  PCF8523  [TSSOP14]

### Nets
!RTC_INT1: TP40.TP U16.13(!INT1) ; also sheet 11
!RTC_INT2: TP42.TP U16.7(!INT2) ; also sheet 11
+BAT: R3.2 U16.4(VBAT) U16.14(VDD) ; also sheet 3,4,5
GND: C68.2 U16.5(VSS) ; also sheet 3,4,5,6,7,8,9,10,12,13,14,16
MCU_SCL: U16.11(SCL) ; also sheet 6,7,8,11
MCU_SDA: U16.10(SDA) ; also sheet 6,7,8,11
N$58: Q9.2 U16.1(OSCI)
N$59: Q9.1 U16.2(OSCO)
RTC_CLKOUT: TP41.TP U16.8(CLKOUT) ; also sheet 11
RTC_VCAP: C68.1 R3.1
Unconnected: U16.3(NC) U16.6(NC) U16.9(NC) U16.12(NC)

### Notes on the sheet
- INPUTS
- Real Time Clock
- OUTPUTS
- COMMUNICATION
- SuperCap
- TEST POINTS
- NOTE: Resistor used to provide current limiting to the capacitor. 
       Larger resistor = longer RC time constant = longer time to charge
- NOTE: At ambiant temperature the average supply
       is 150nA. The maximum supply current is 3.6uA.

## Sheet 16 of 35: E-Eink Display
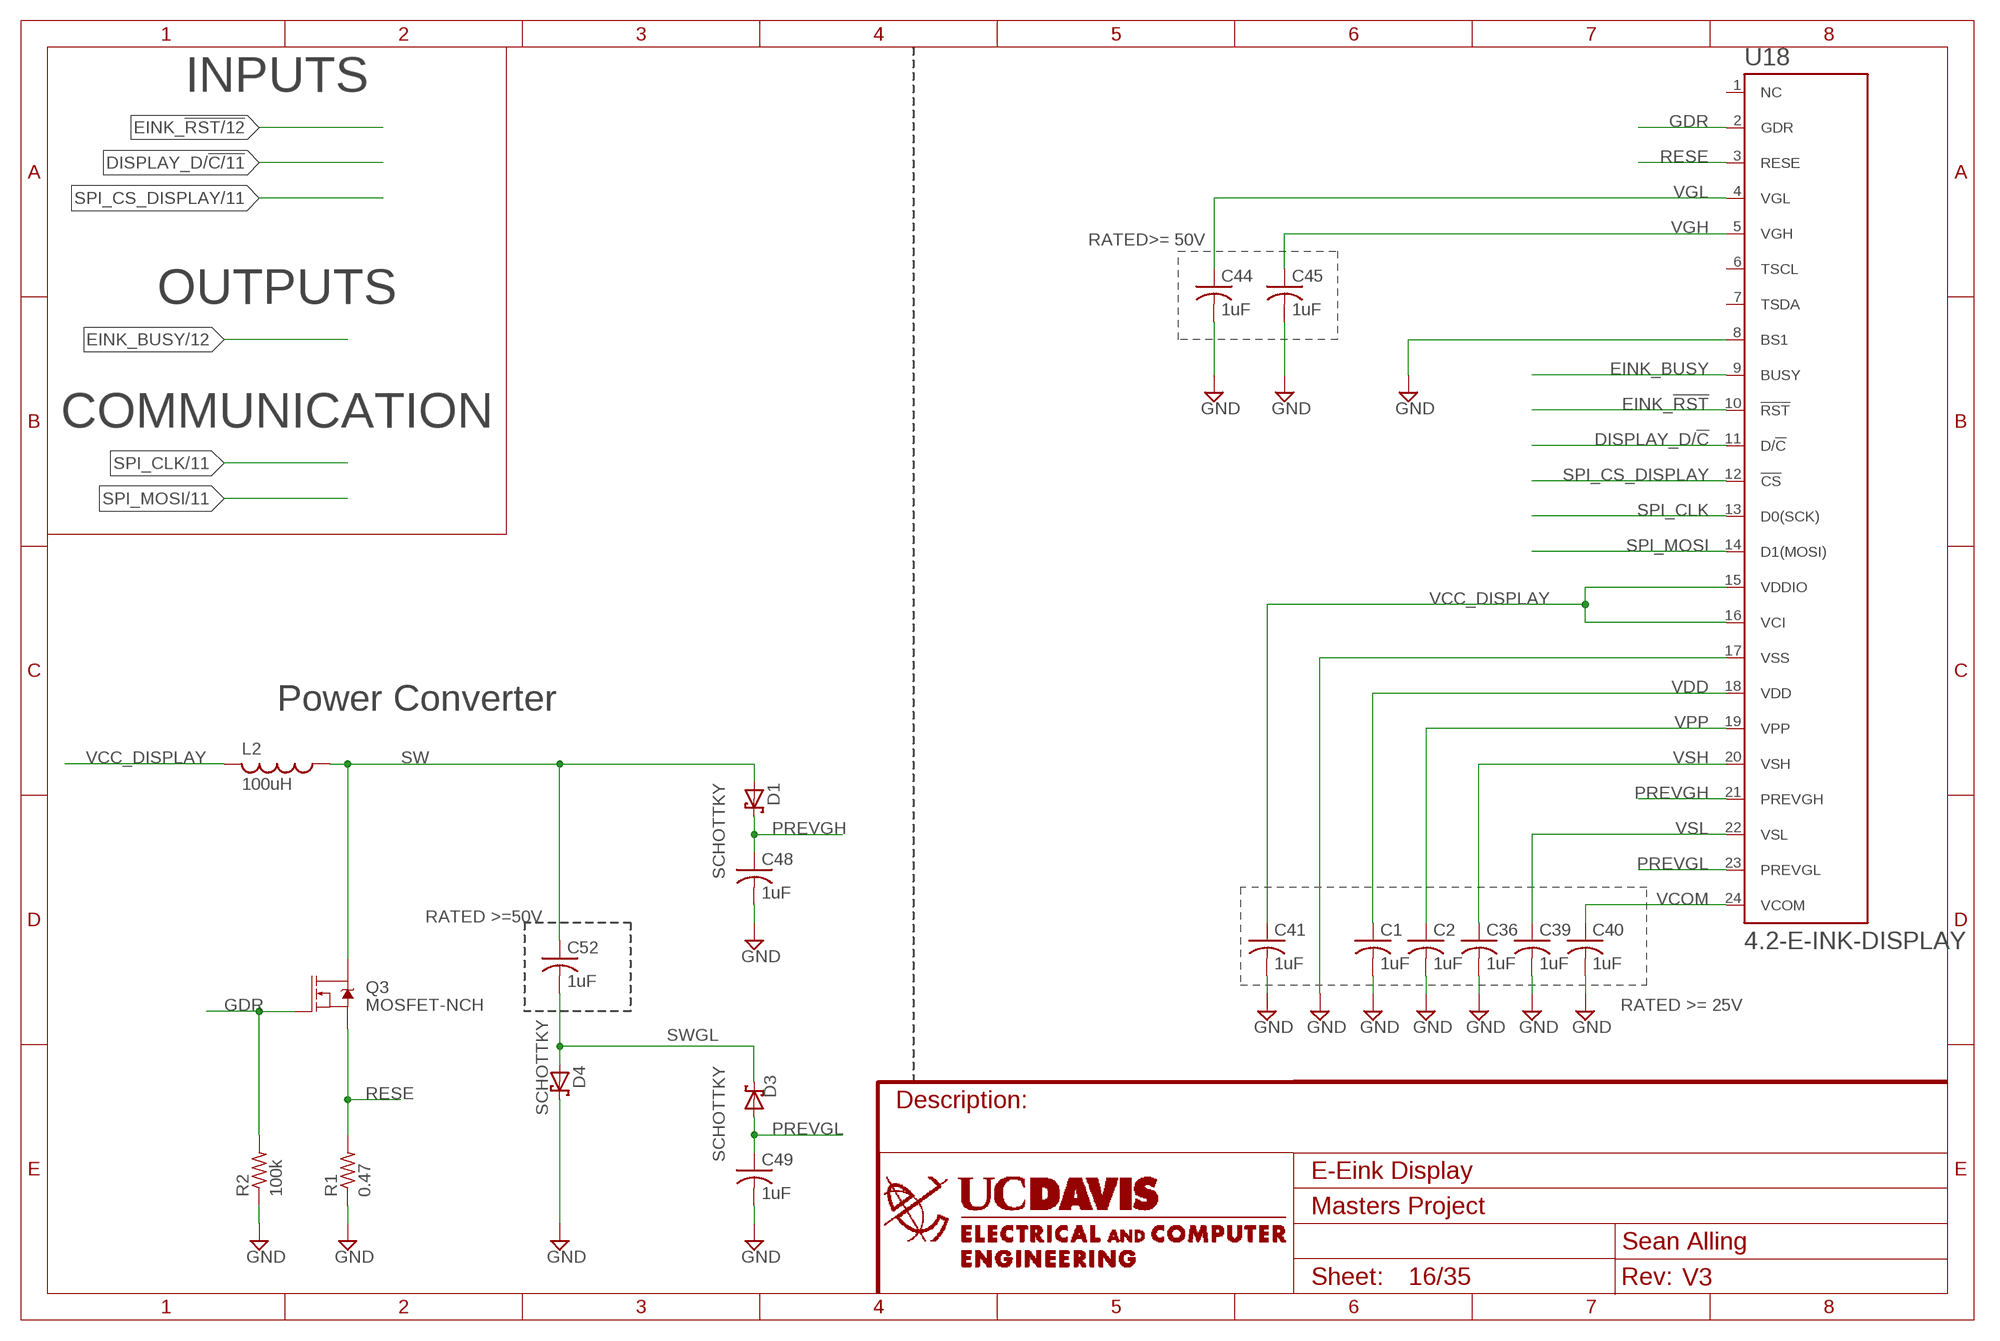
[diagram p15: schematic, sheet 16]

### Parts
C1  1uF  C-USC0603  [C0603]
C2  1uF  C-USC0603  [C0603]
C36  1uF  C-USC0603  [C0603]
C39  1uF  C-USC0603  [C0603]
C40  1uF  C-USC0603  [C0603]
C41  1uF  C-USC0603  [C0603]
C44  1uF  C-USC0603  [C0603]
C45  1uF  C-USC0603  [C0603]
C48  1uF  C-USC0603  [C0603]
C49  1uF  C-USC0603  [C0603]
C52  1uF  C-USC0603  [C0603]
D1  SCHOTTKY  [SOD3716X128]
D3  SCHOTTKY  [SOD3716X128]
D4  SCHOTTKY  [SOD3716X128]
L2  100uH  L_US3015  [LPS3015]
Q3  MOSFET-NCH  [SOT95P237X112-3]
R1  0.47  R-US_R0603  [R0603]
R2  100k  R-US_R0603  [R0603]
U18  4.2-E-INK-DISPLAY  [FPC-24PIN-0.5MM]

### Nets
DISPLAY_D/!C: U18.11(D/!C) ; also sheet 11
EINK_!RST: U18.10(!RST) ; also sheet 12
EINK_BUSY: U18.9(BUSY) ; also sheet 12
GDR: Q3.1(G) R2.2 U18.2(GDR)
GND: C1.2 C2.2 C36.2 C39.2 C40.2 C41.2 C44.2 C45.2 C48.2 C49.2 D4.2(C) R1.1 R2.1 U18.8(BS1) U18.17(VSS) ; also sheet 3,4,5,6,7,8,9,10,12,13,14,15
PREVGH: C48.1 D1.2(C) U18.21(PREVGH)
PREVGL: C49.1 D3.1(A) U18.23(PREVGL)
RESE: Q3.2(S) R1.2 U18.3(RESE)
SPI_CLK: U18.13(D0(SCK)) ; also sheet 11
SPI_CS_DISPLAY: U18.12(!CS) ; also sheet 11
SPI_MOSI: U18.14(D1(MOSI)) ; also sheet 11
SW: C52.1 D1.1(A) L2.1 Q3.3(D)
SWGL: C52.2 D3.2(C) D4.1(A)
VCC_DISPLAY: C41.1 L2.2 U18.15(VDDIO) U18.16(VCI) ; also sheet 4,5
VCOM: C40.1 U18.24(VCOM)
VDD: C1.1 U18.18(VDD)
VGH: C45.1 U18.5(VGH)
VGL: C44.1 U18.4(VGL)
VPP: C2.1 U18.19(VPP)
VSH: C36.1 U18.20(VSH)
VSL: C39.1 U18.22(VSL)
Unconnected: U18.1(NC) U18.6(TSCL) U18.7(TSDA)

### Notes on the sheet
- INPUTS
- RATED>= 50V
- OUTPUTS
- COMMUNICATION
- Power Converter
- RATED >=50V
- RATED >= 25V

## Sheet 17 of 35: Notes: Mechanical
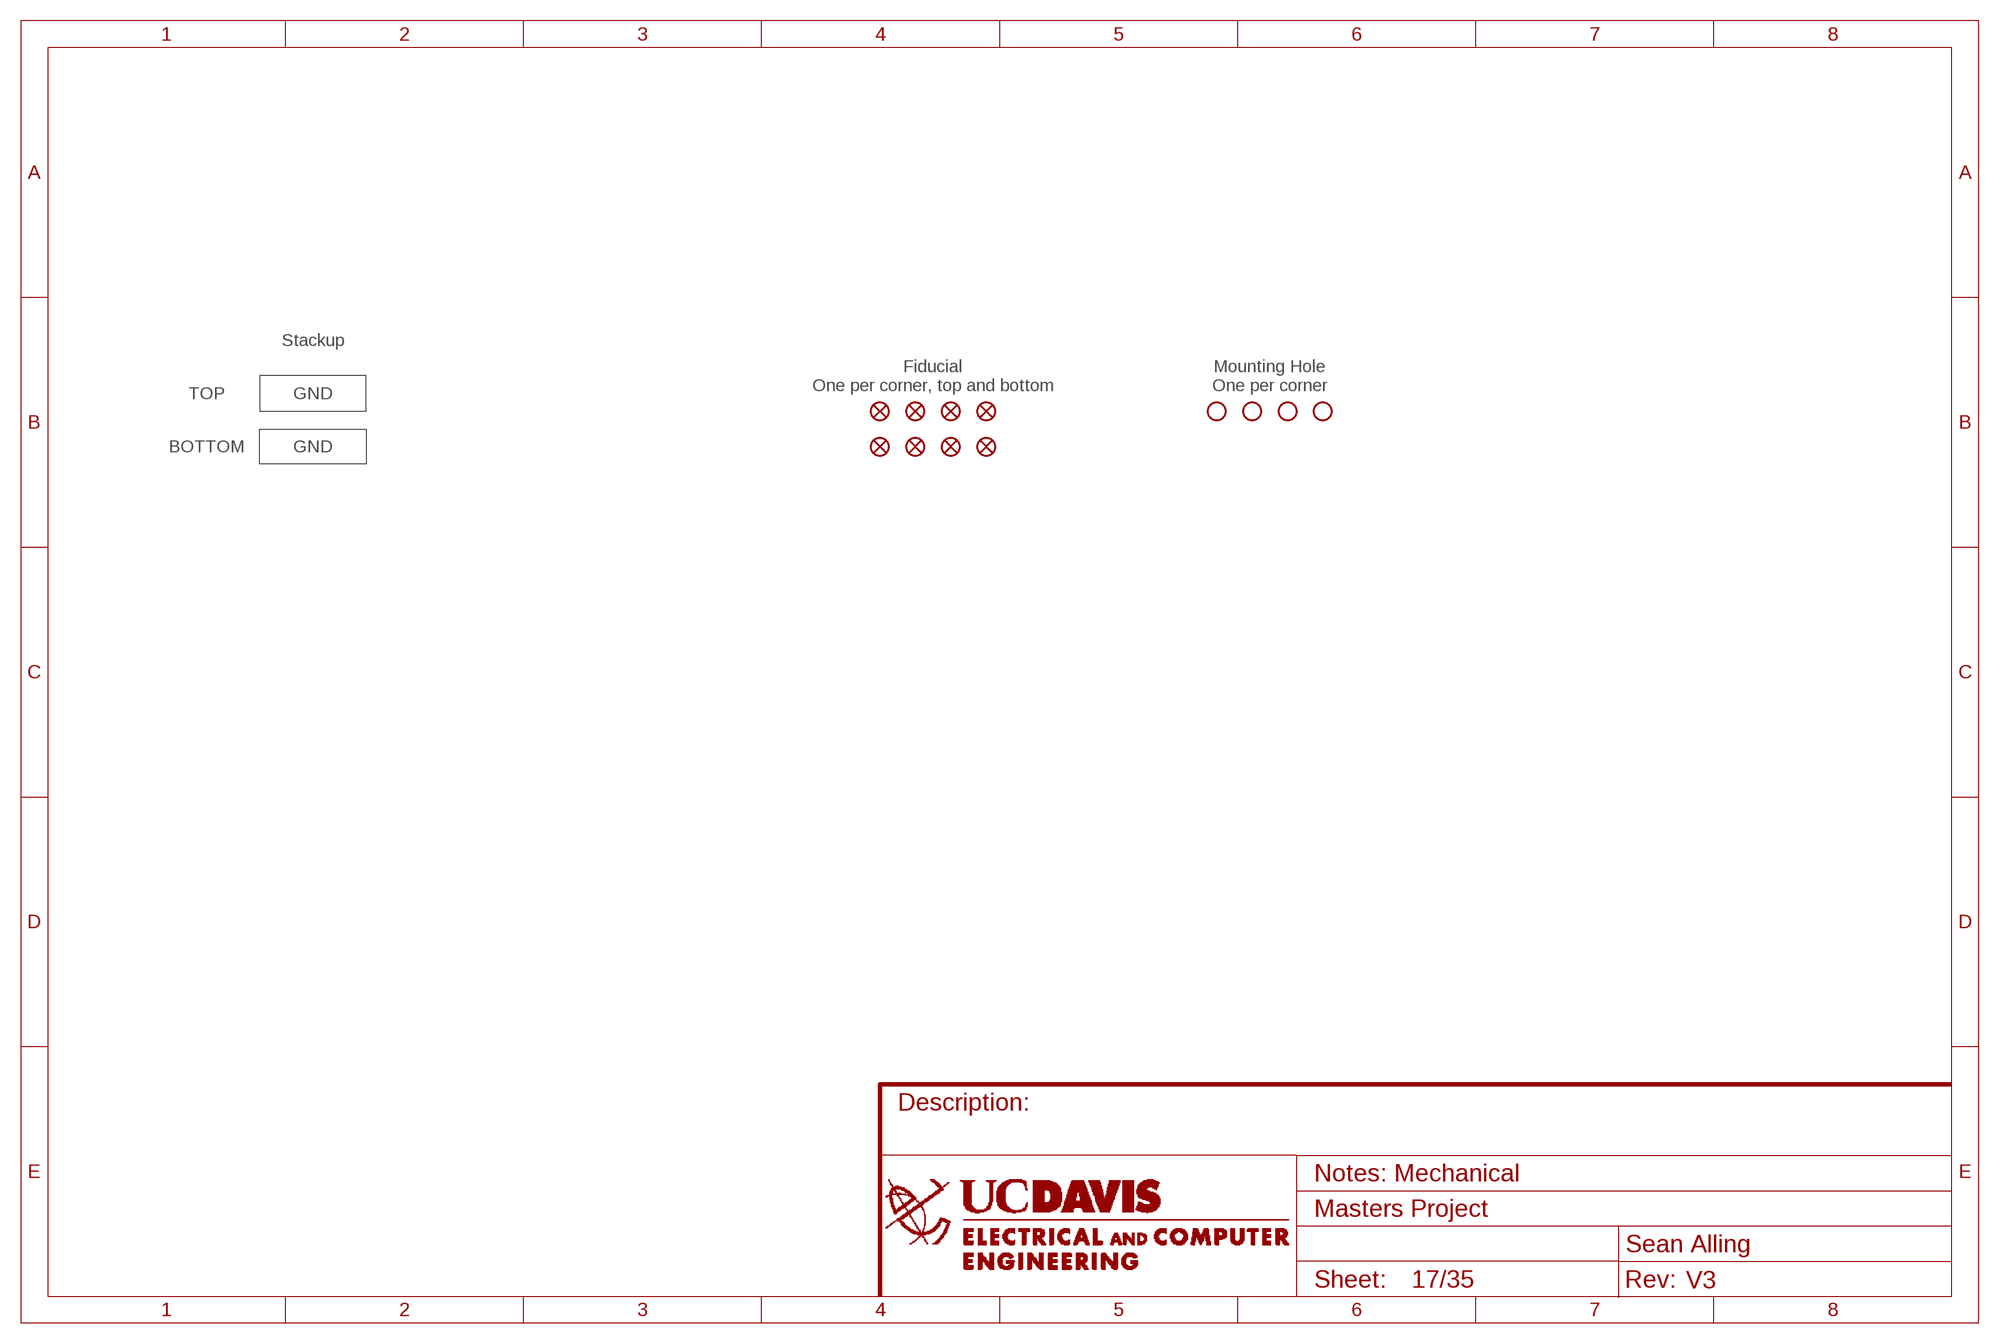
[diagram p16: schematic, sheet 17]

### Parts
FD1  FIDUCIAL1X2  [FIDUCIAL-1X2]
FD2  FIDUCIAL1X2  [FIDUCIAL-1X2]
FD3  FIDUCIAL1X2  [FIDUCIAL-1X2]
FD4  FIDUCIAL1X2  [FIDUCIAL-1X2]
FD5  FIDUCIAL1X2  [FIDUCIAL-1X2]
FD6  FIDUCIAL1X2  [FIDUCIAL-1X2]
FD7  FIDUCIAL1X2  [FIDUCIAL-1X2]
FD8  FIDUCIAL1X2  [FIDUCIAL-1X2]
H1  STAND-OFF  [STAND-OFF]
H2  STAND-OFF  [STAND-OFF]
H3  STAND-OFF  [STAND-OFF]
H4  STAND-OFF  [STAND-OFF]

### Notes on the sheet
- Stackup
- Fiducial
  One per corner, top and bottom
- Mounting Hole
  One per corner
- TOP | GND
- BOTTOM | GND

## Sheet 18 of 35: Notes: Test Points
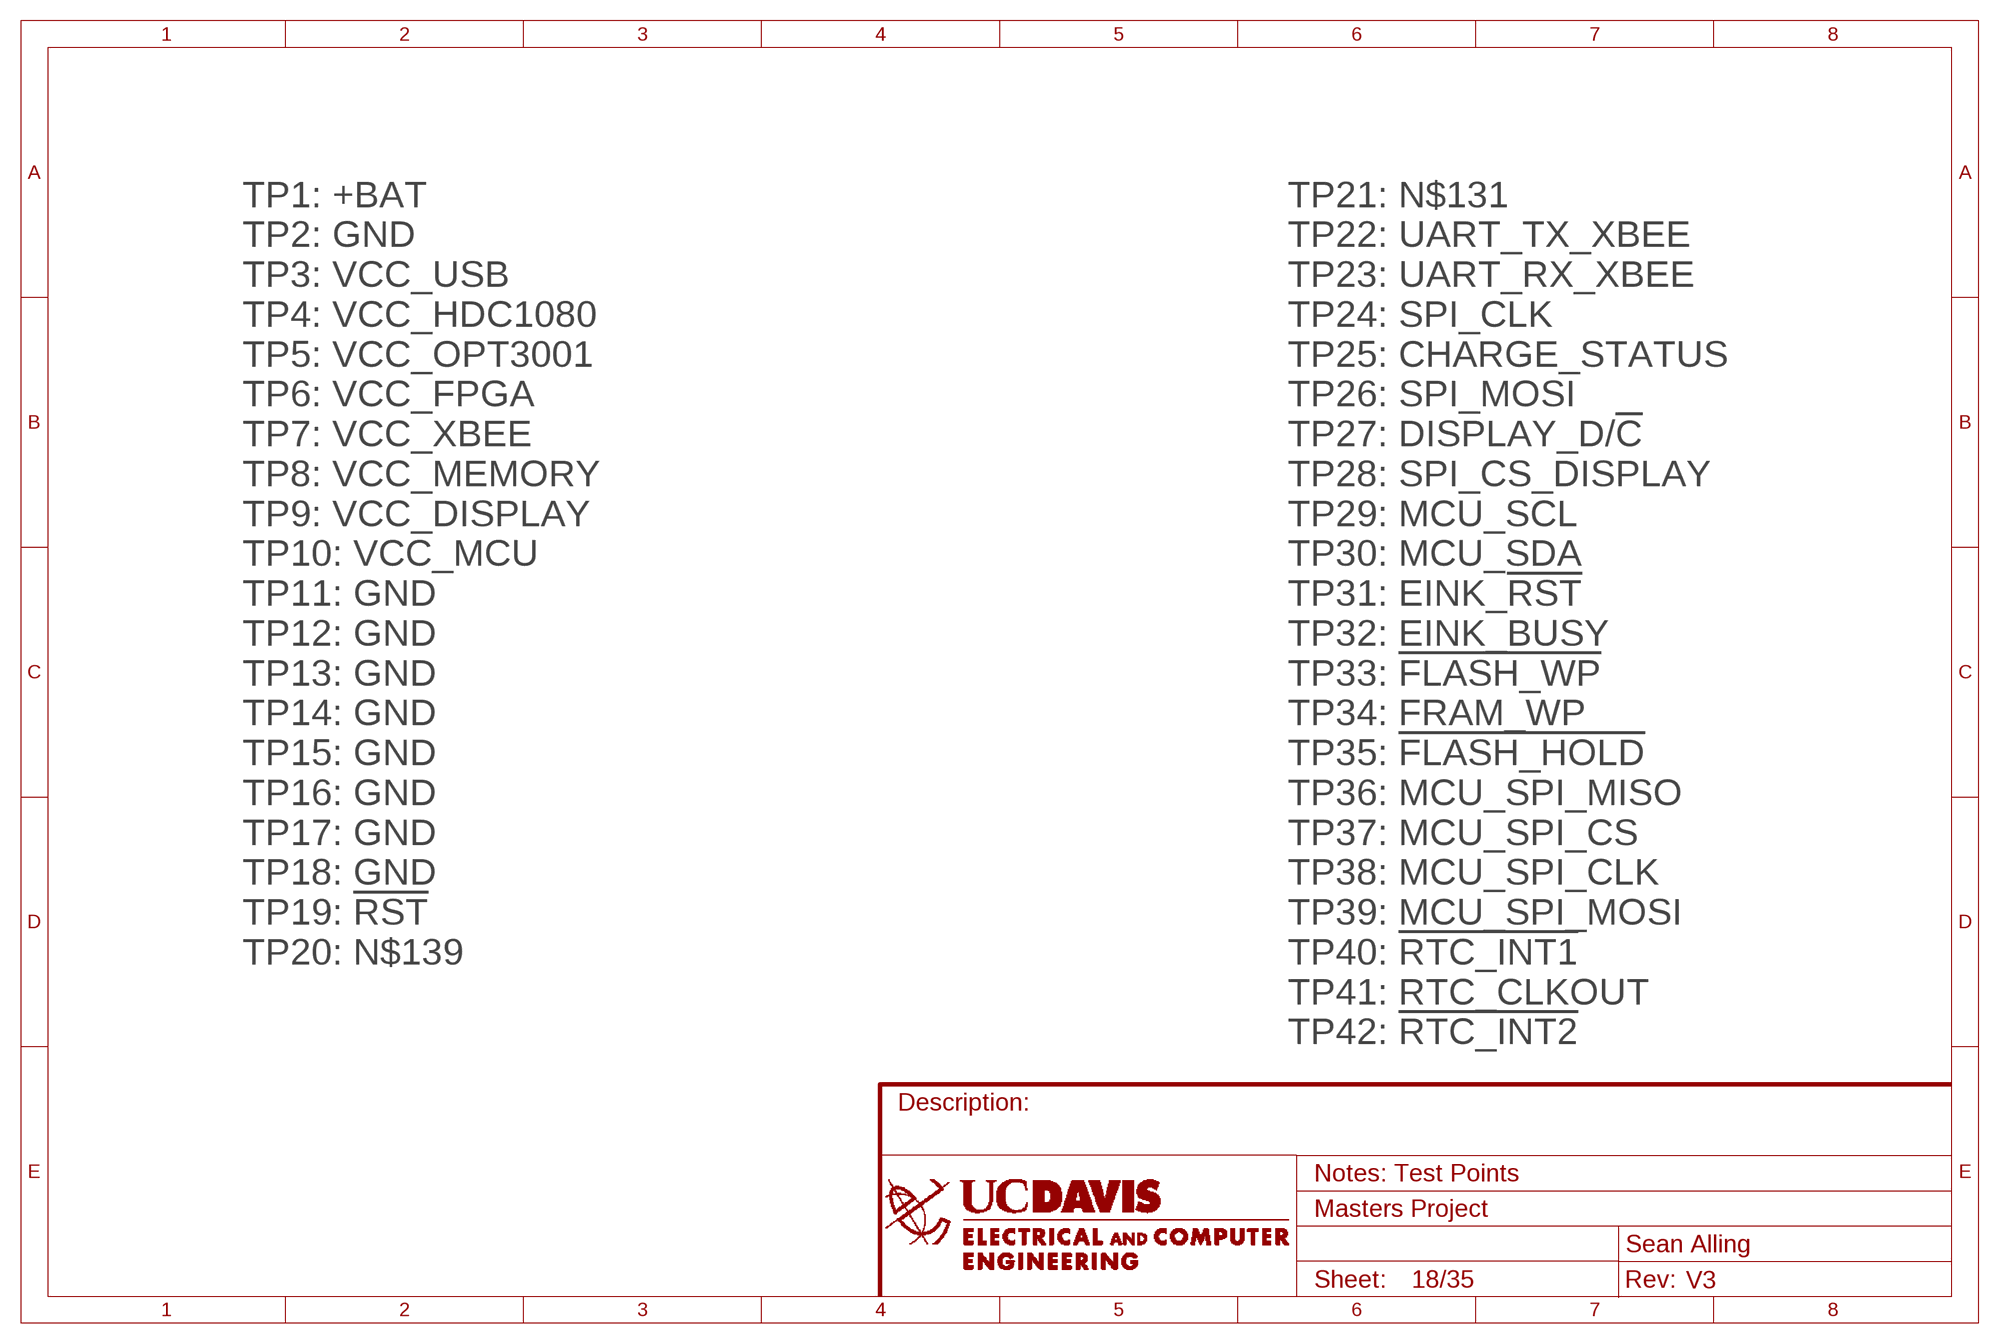
[diagram p17: schematic, sheet 18]

### Notes on the sheet
- TP1: +BAT
  TP2: GND
  TP3: VCC_USB
  TP4: VCC_HDC1080
  TP5: VCC_OPT3001
  TP6: VCC_FPGA
  TP7: VCC_XBEE
  TP8: VCC_MEMORY
  TP9: VCC_DISPLAY
  TP10: VCC_MCU
  TP11: GND
  TP12: GND
  TP13: GND
  TP14: GND
  TP15: GND
  TP16: GND
  TP17: GND
  TP18: GND
  TP19: !RST
  TP20: N$139
- TP21: N$131
  TP22: UART_TX_XBEE
  TP23: UART_RX_XBEE
  TP24: SPI_CLK
  TP25: CHARGE_STATUS
  TP26: SPI_MOSI
  TP27: DISPLAY_D/!C
  TP28: SPI_CS_DISPLAY
  TP29: MCU_SCL
  TP30: MCU_SDA
  TP31: EINK_!RST
  TP32: EINK_BUSY
  TP33: !FLASH_WP
  TP34: FRAM_WP
  TP35: !FLASH_HOLD
  TP36: MCU_SPI_MISO
  TP37: MCU_SPI_CS
  TP38: MCU_SPI_CLK
  TP39: MCU_SPI_MOSI
  TP40: !RTC_INT1
  TP41: RTC_CLKOUT
  TP42: !RTC_INT2

## Sheet 19 of 35: PCB: Top
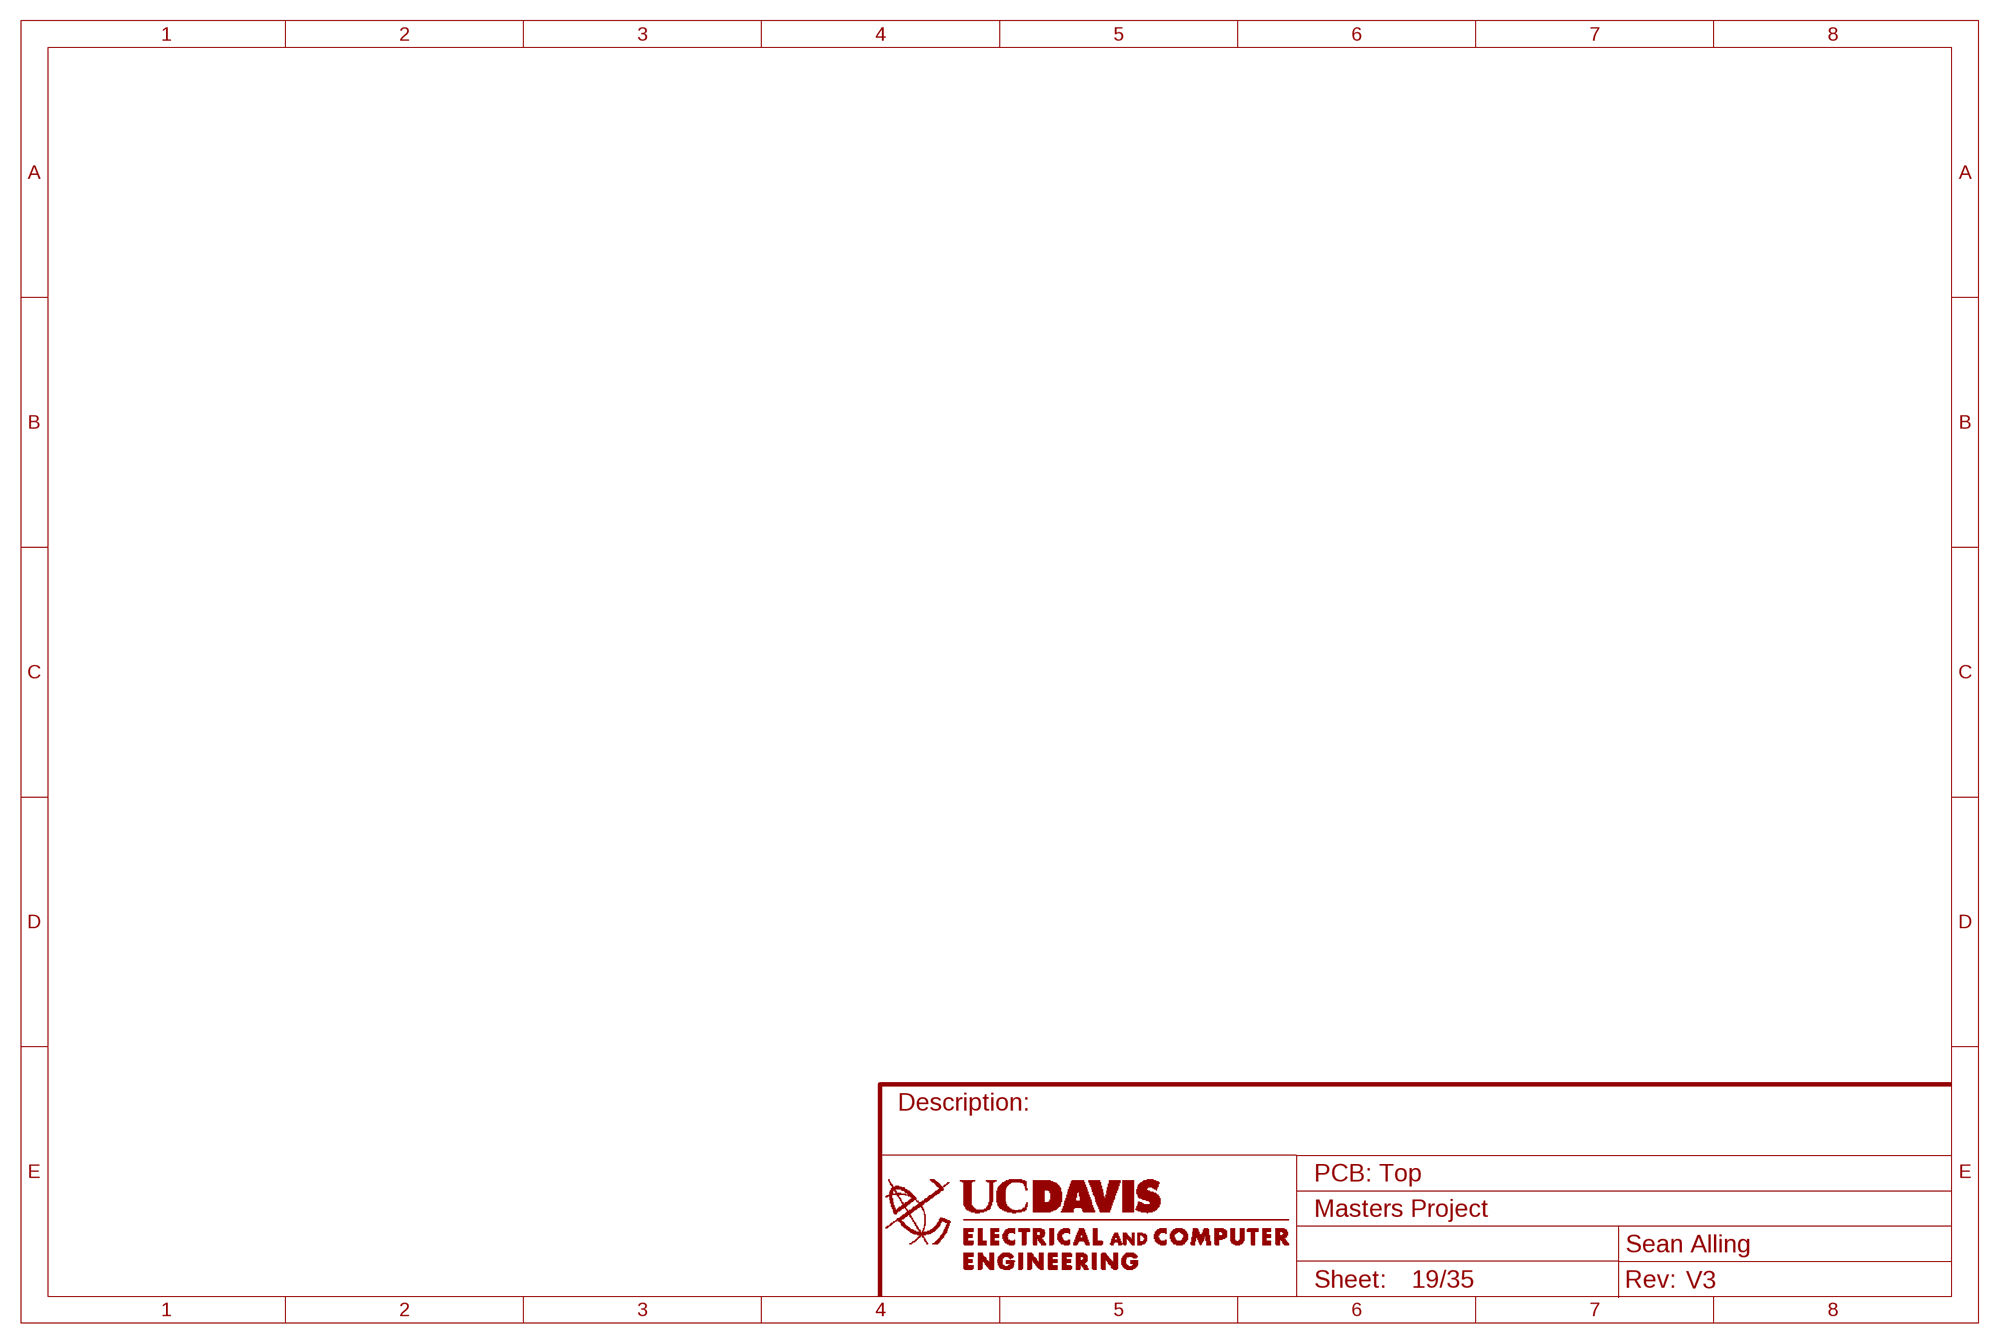
[diagram p18: schematic, sheet 19]

## Sheet 20 of 35: PCB: Bottom
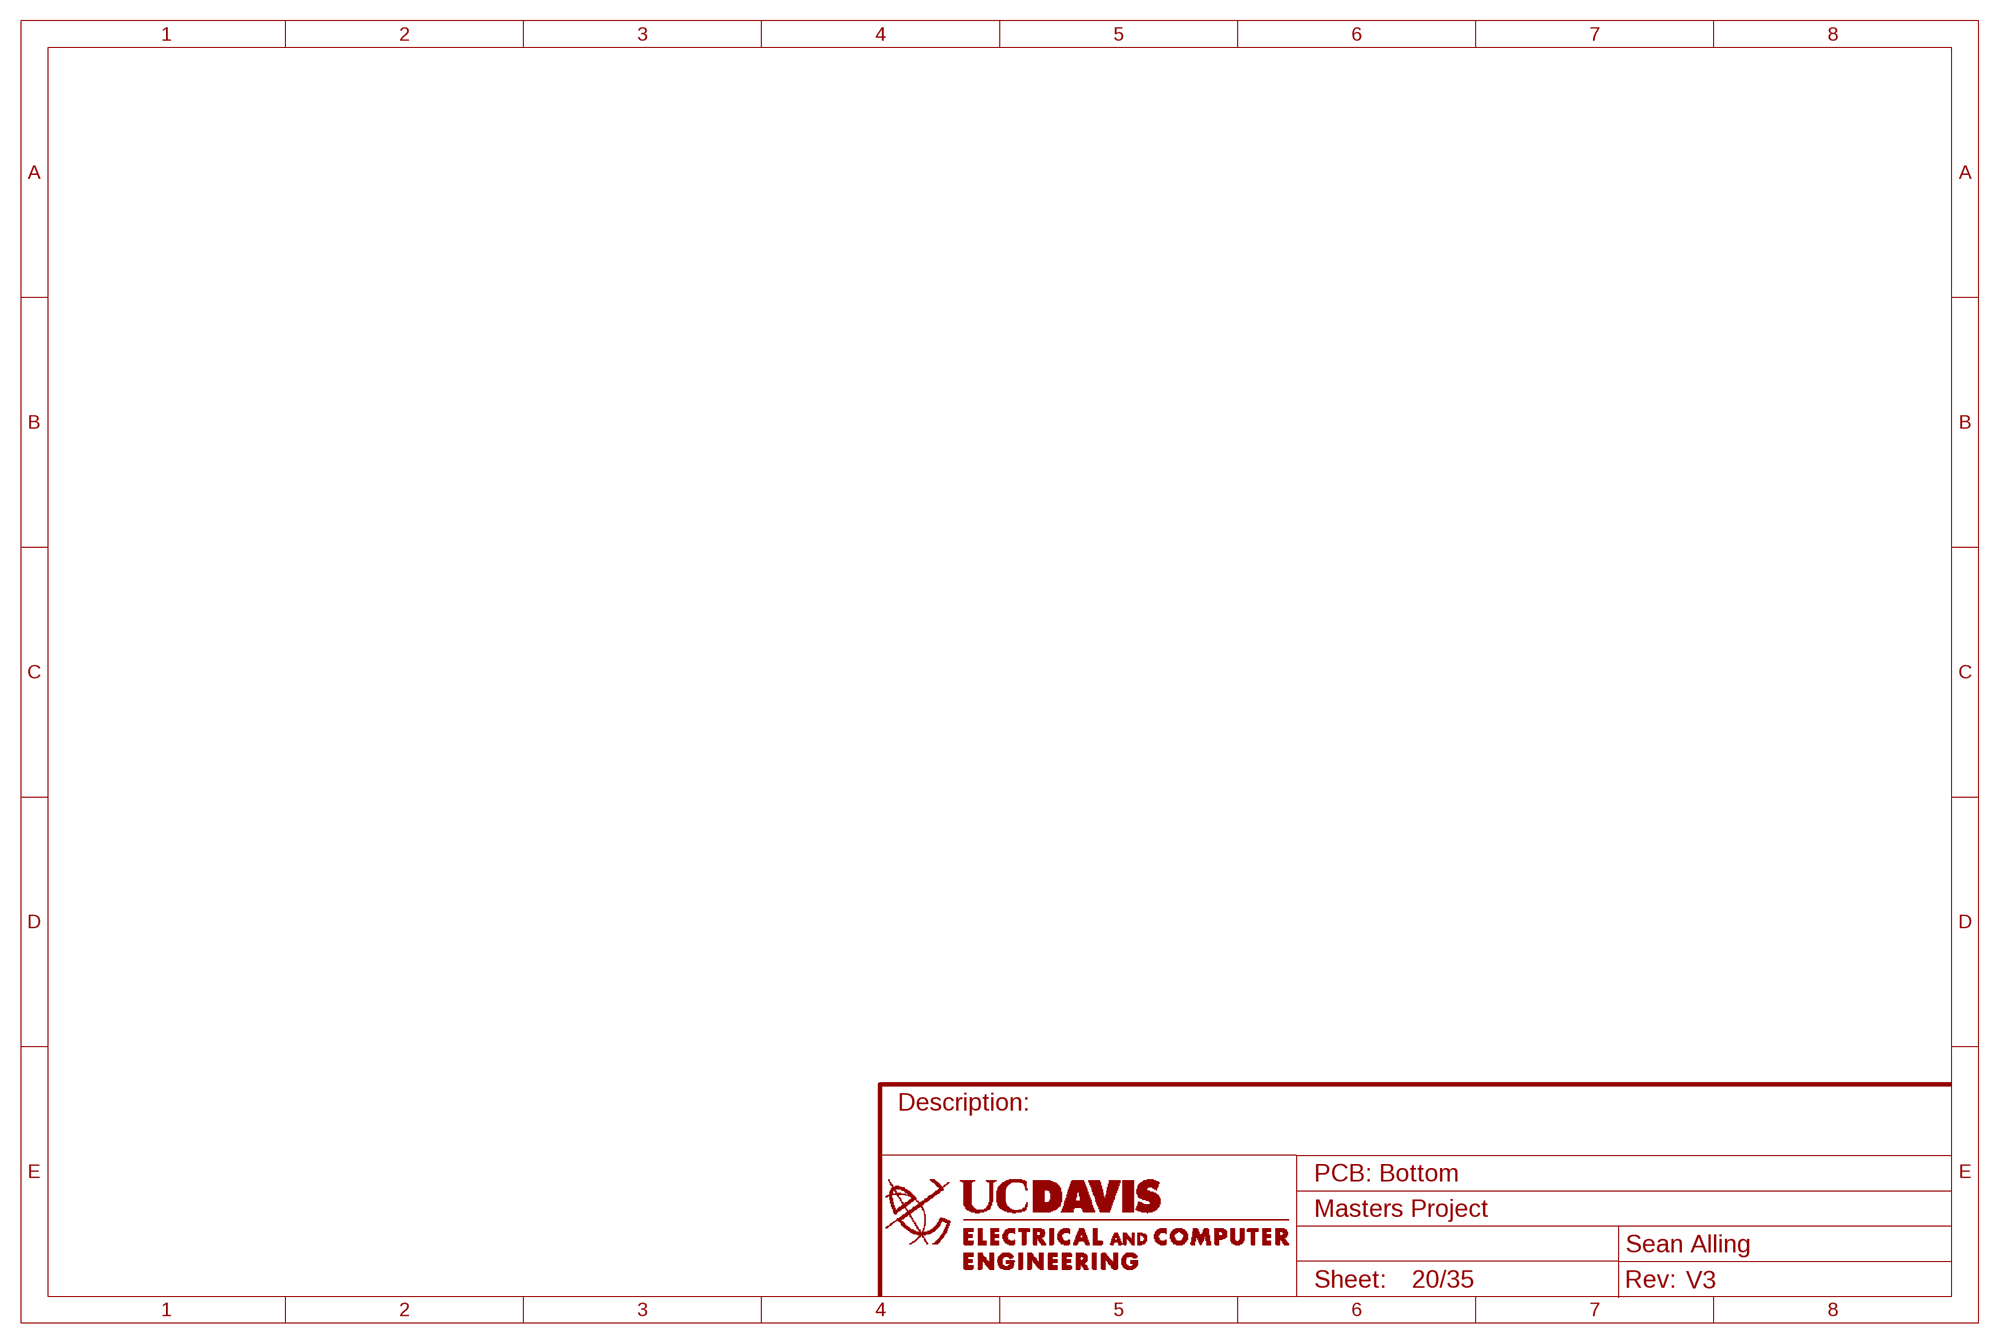
[diagram p19: schematic, sheet 20]

## Sheet 21 of 35: Assembly: Top
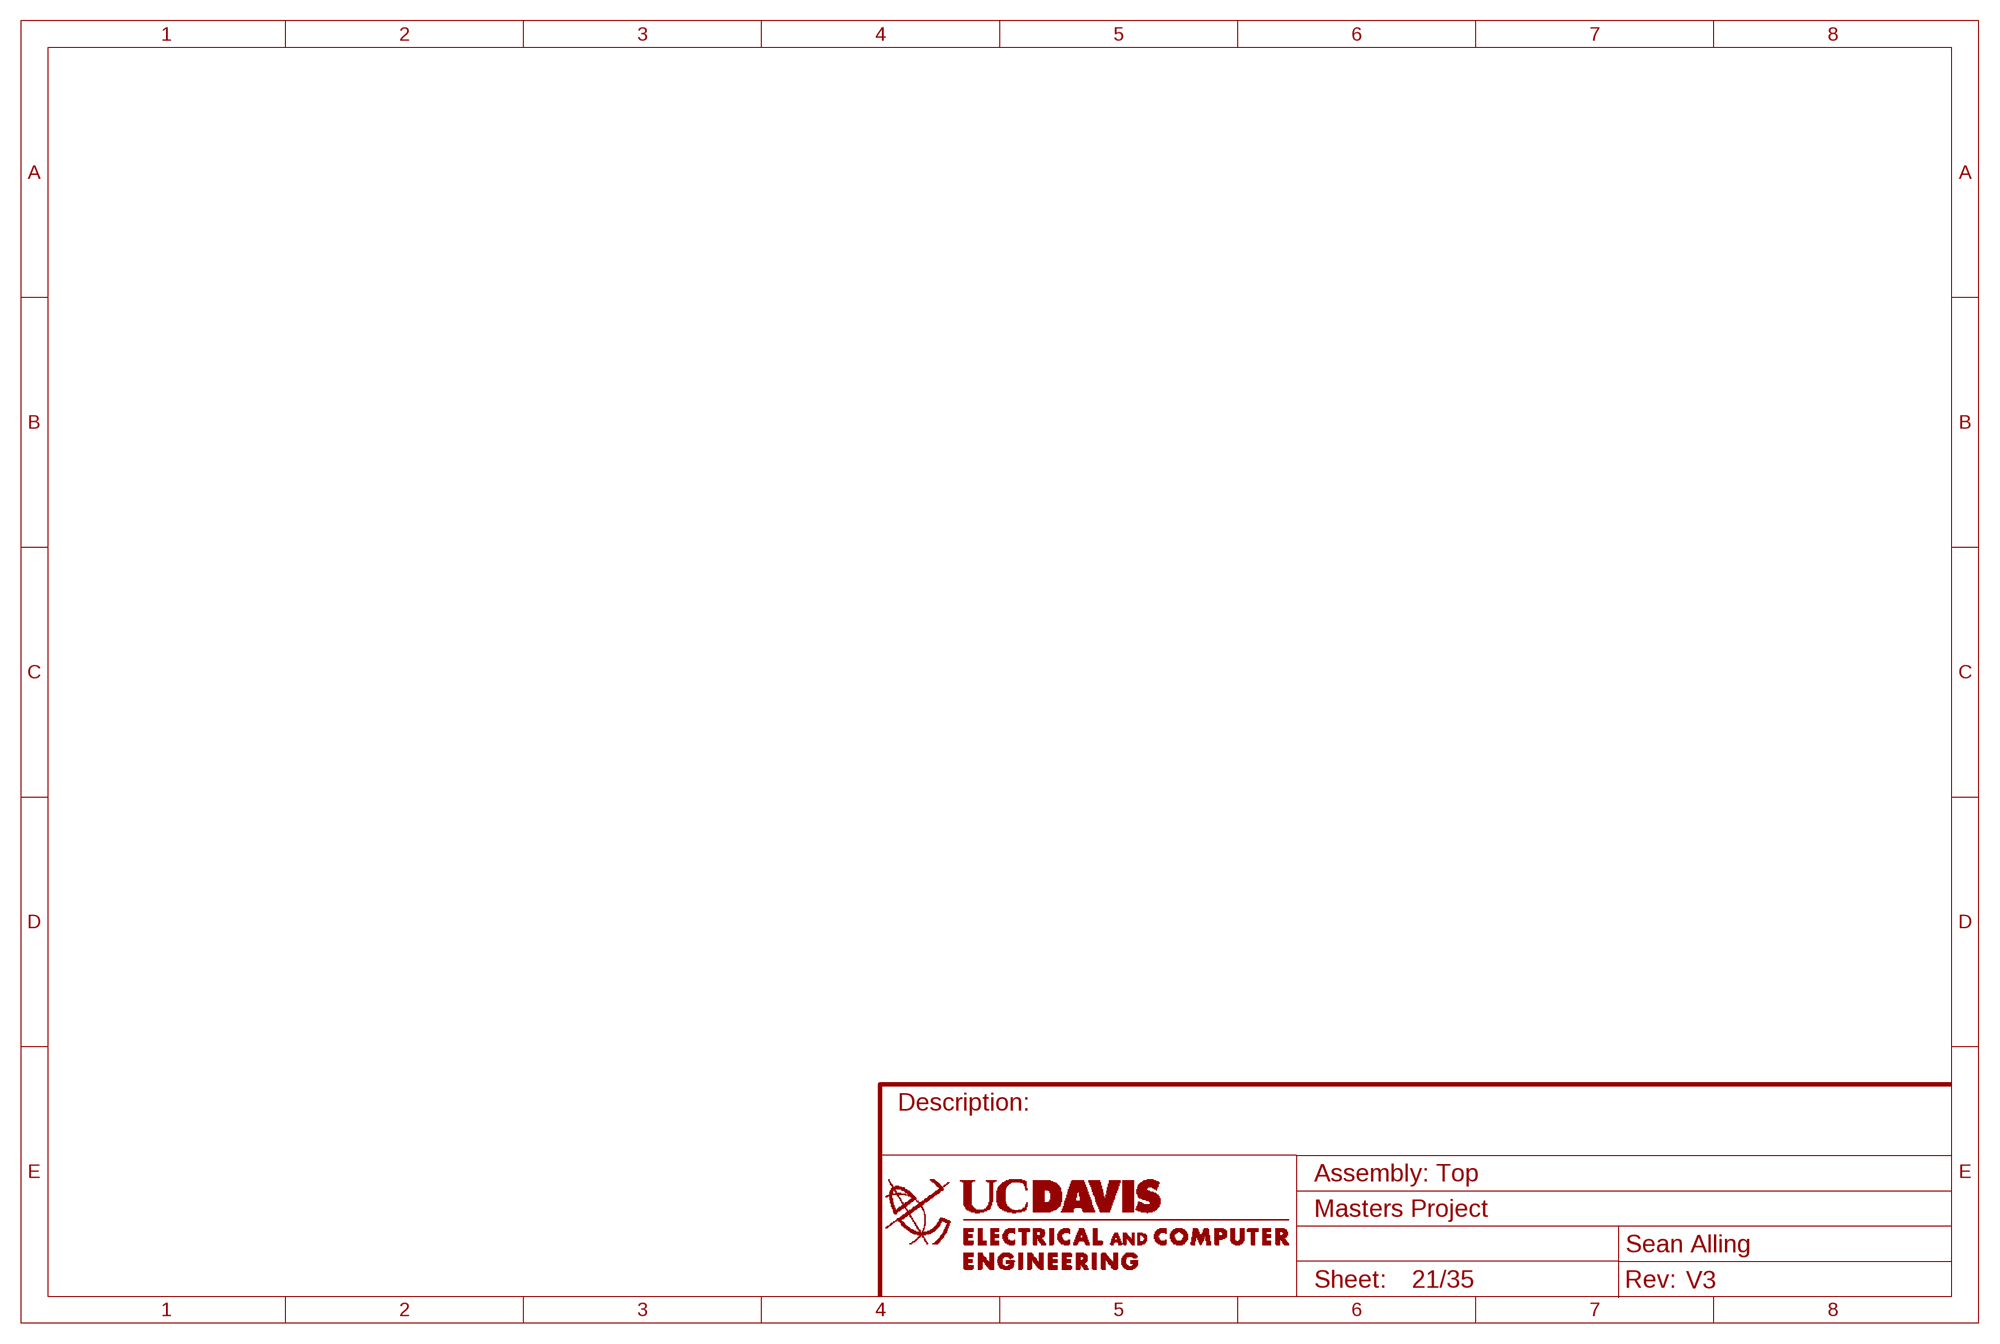
[diagram p20: schematic, sheet 21]

## Sheet 22 of 35: Assembly: Bottom
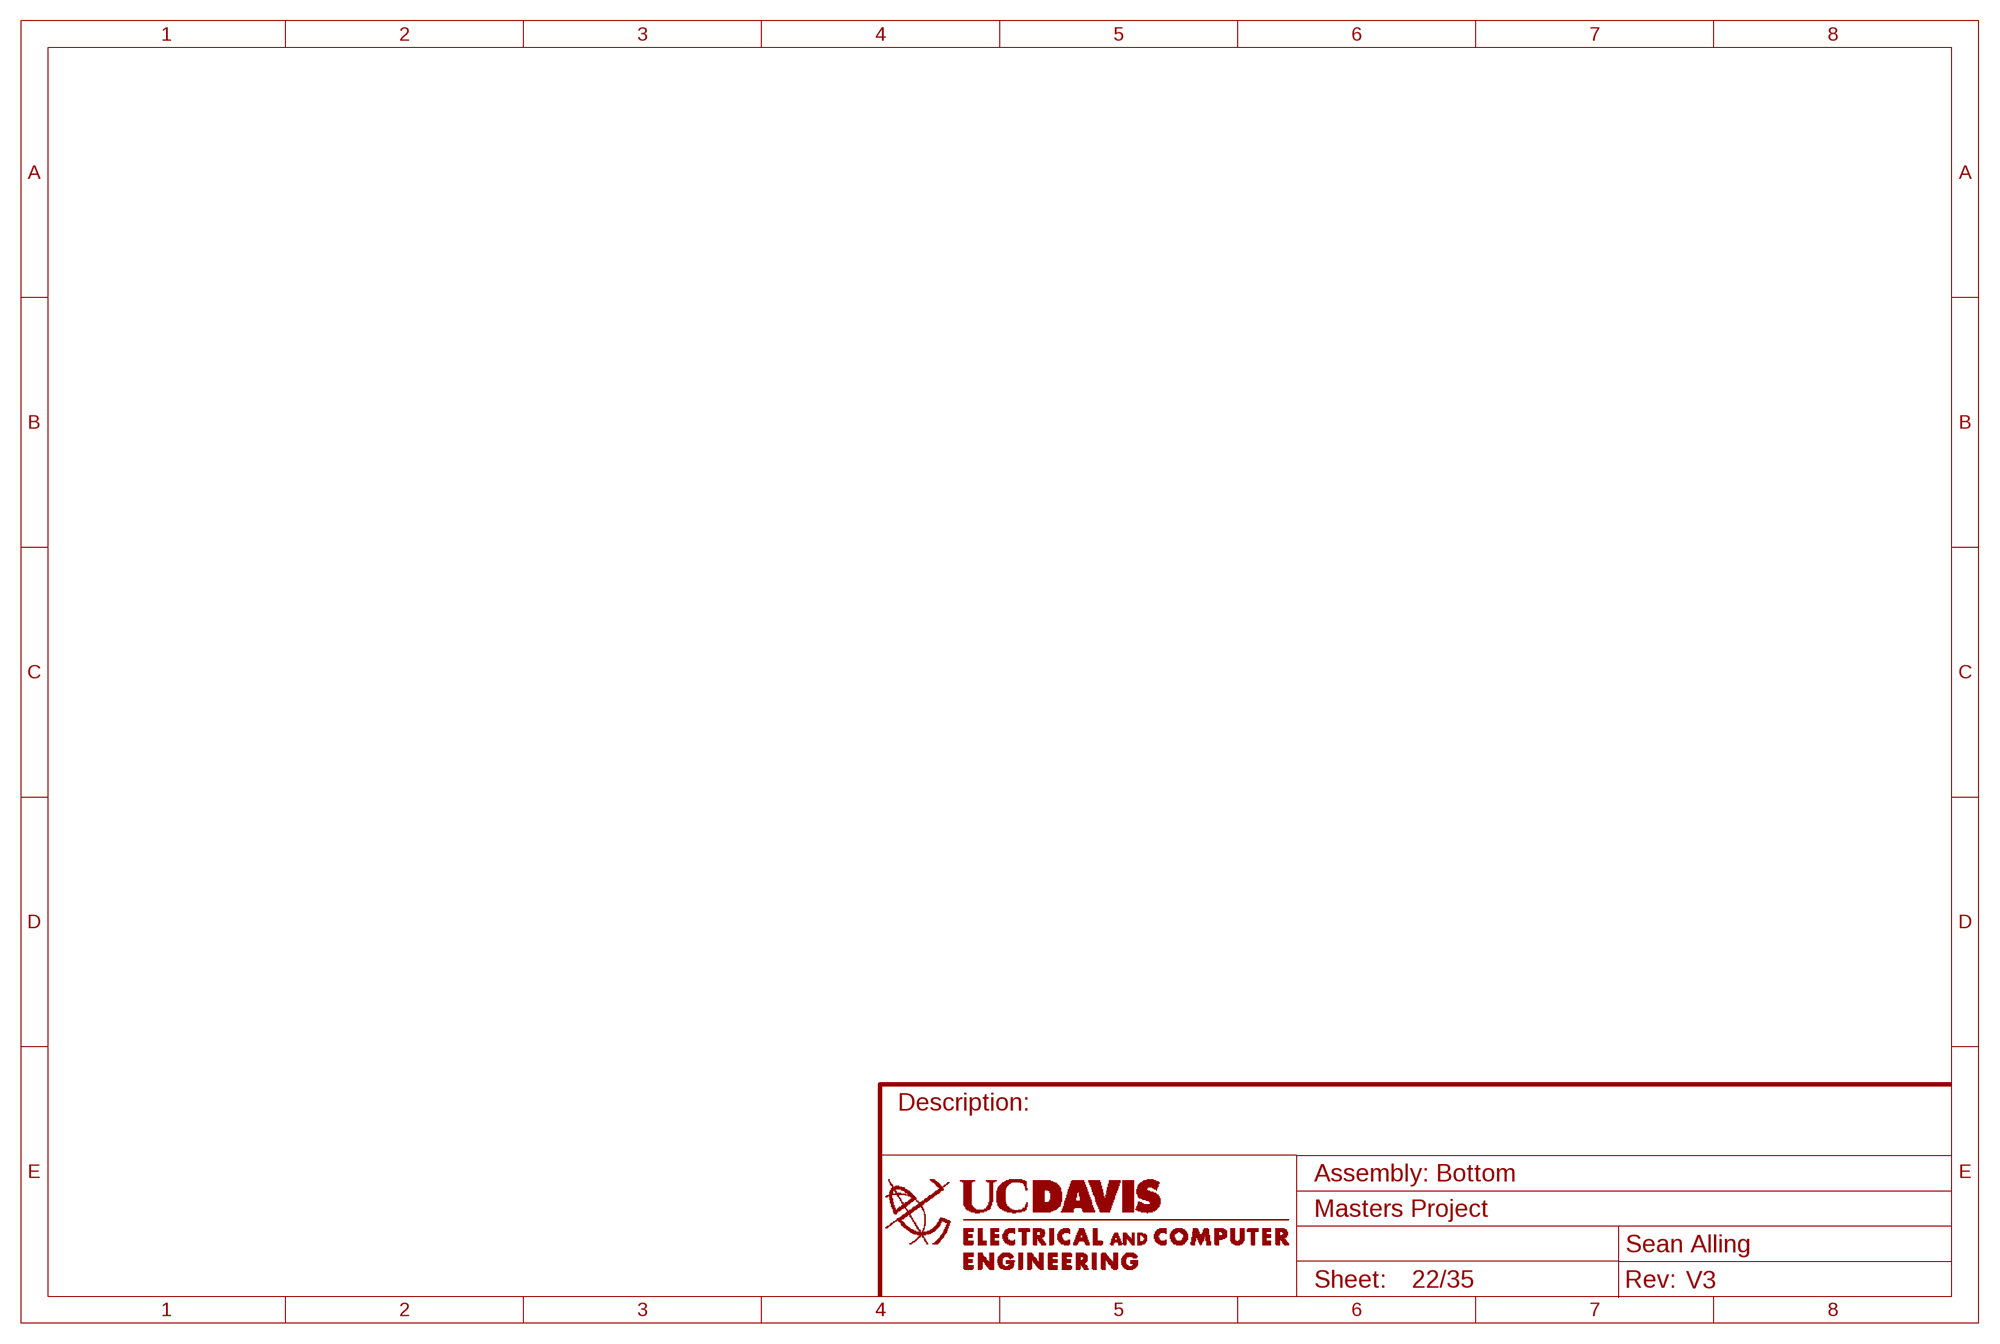
[diagram p21: schematic, sheet 22]

## Sheet 23 of 35: Stencil: Top
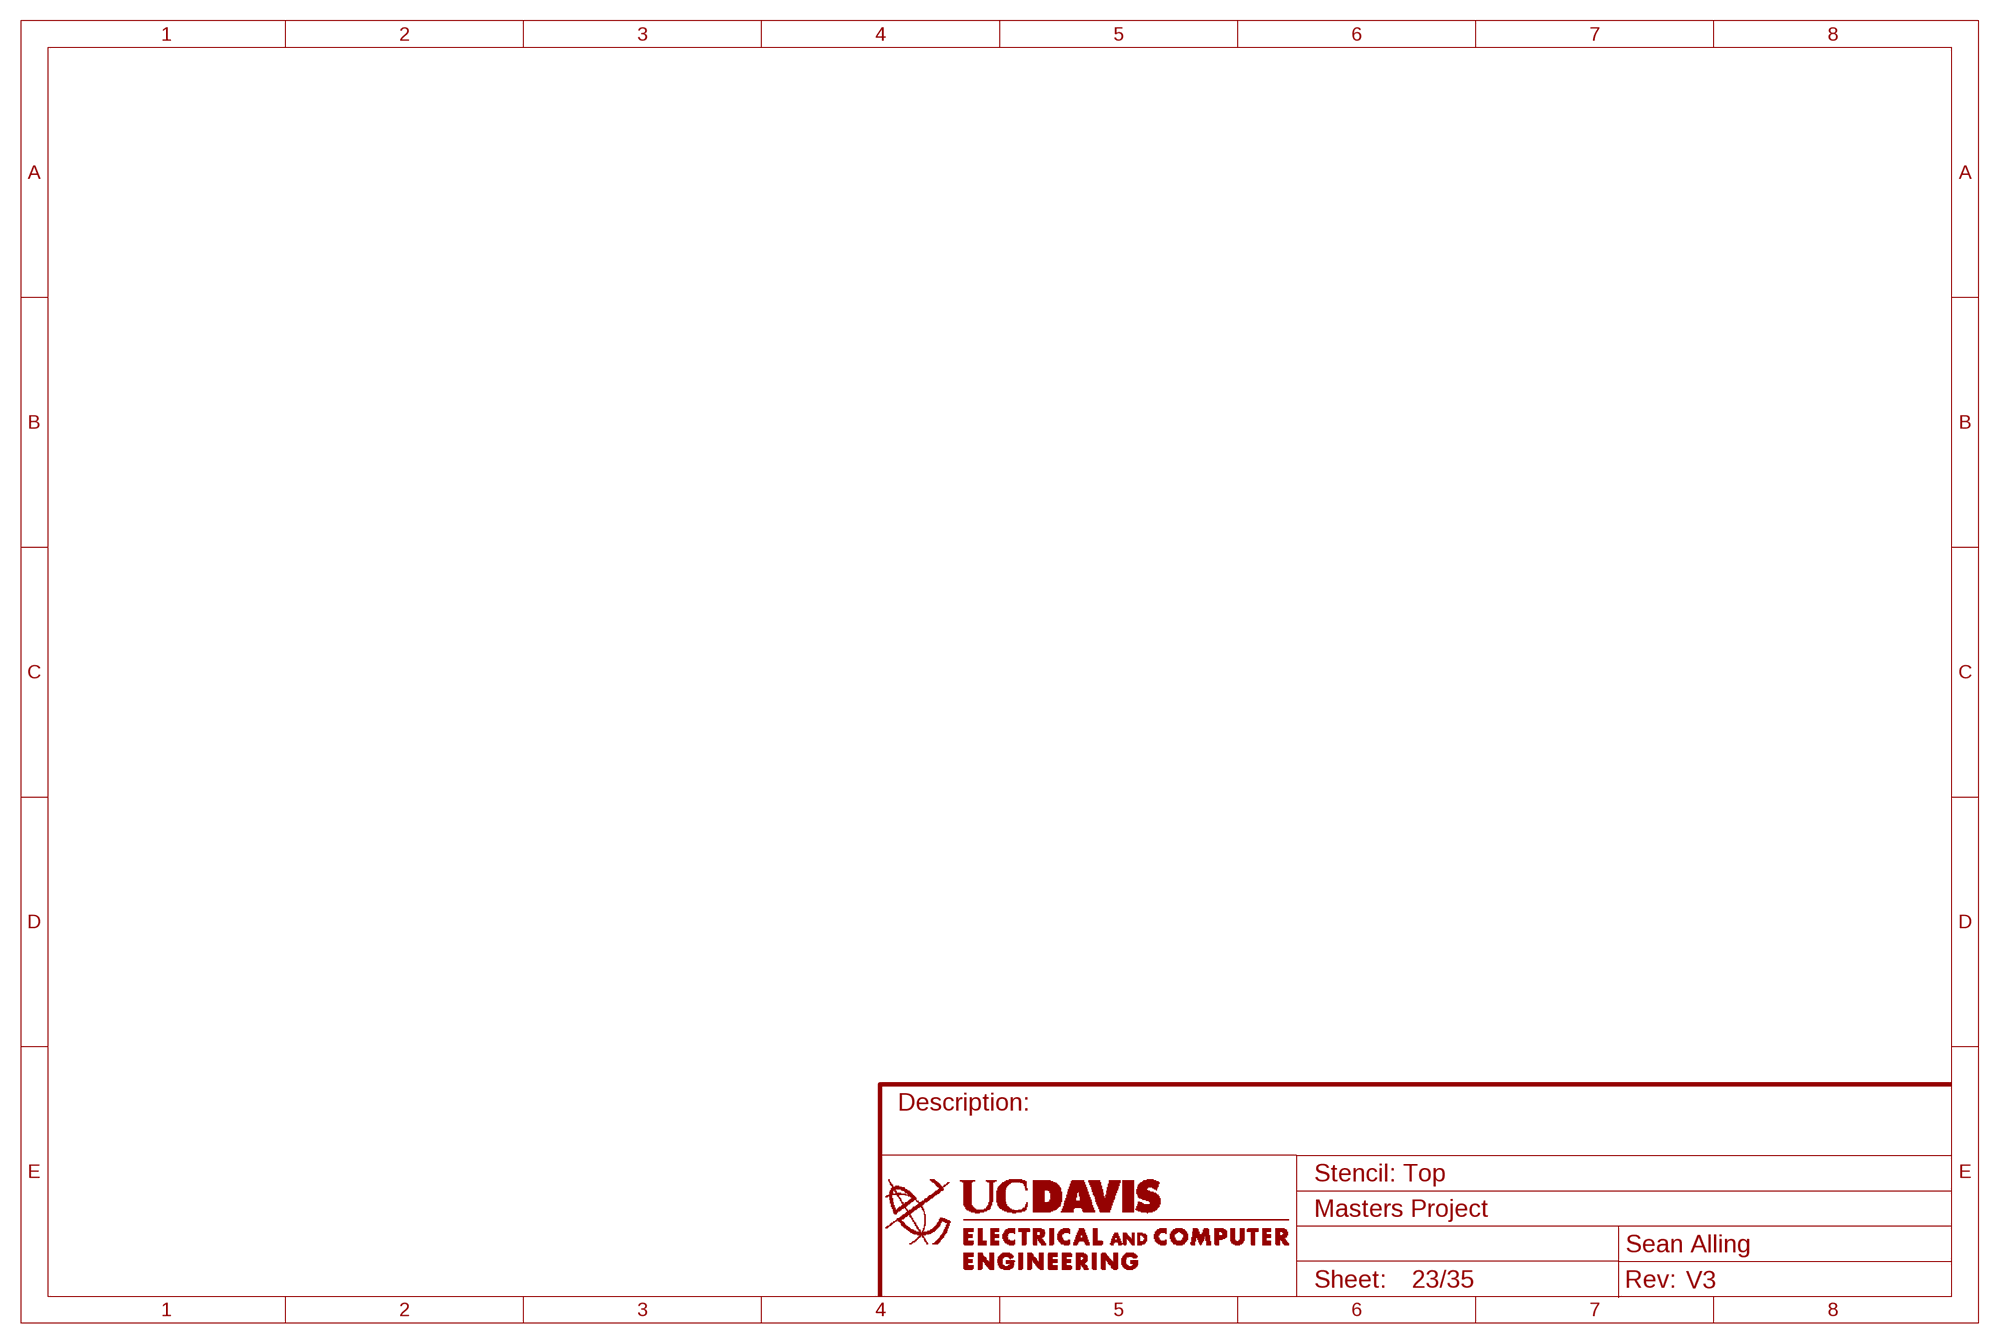
[diagram p22: schematic, sheet 23]

## Sheet 24 of 35: Stencil: Bottom
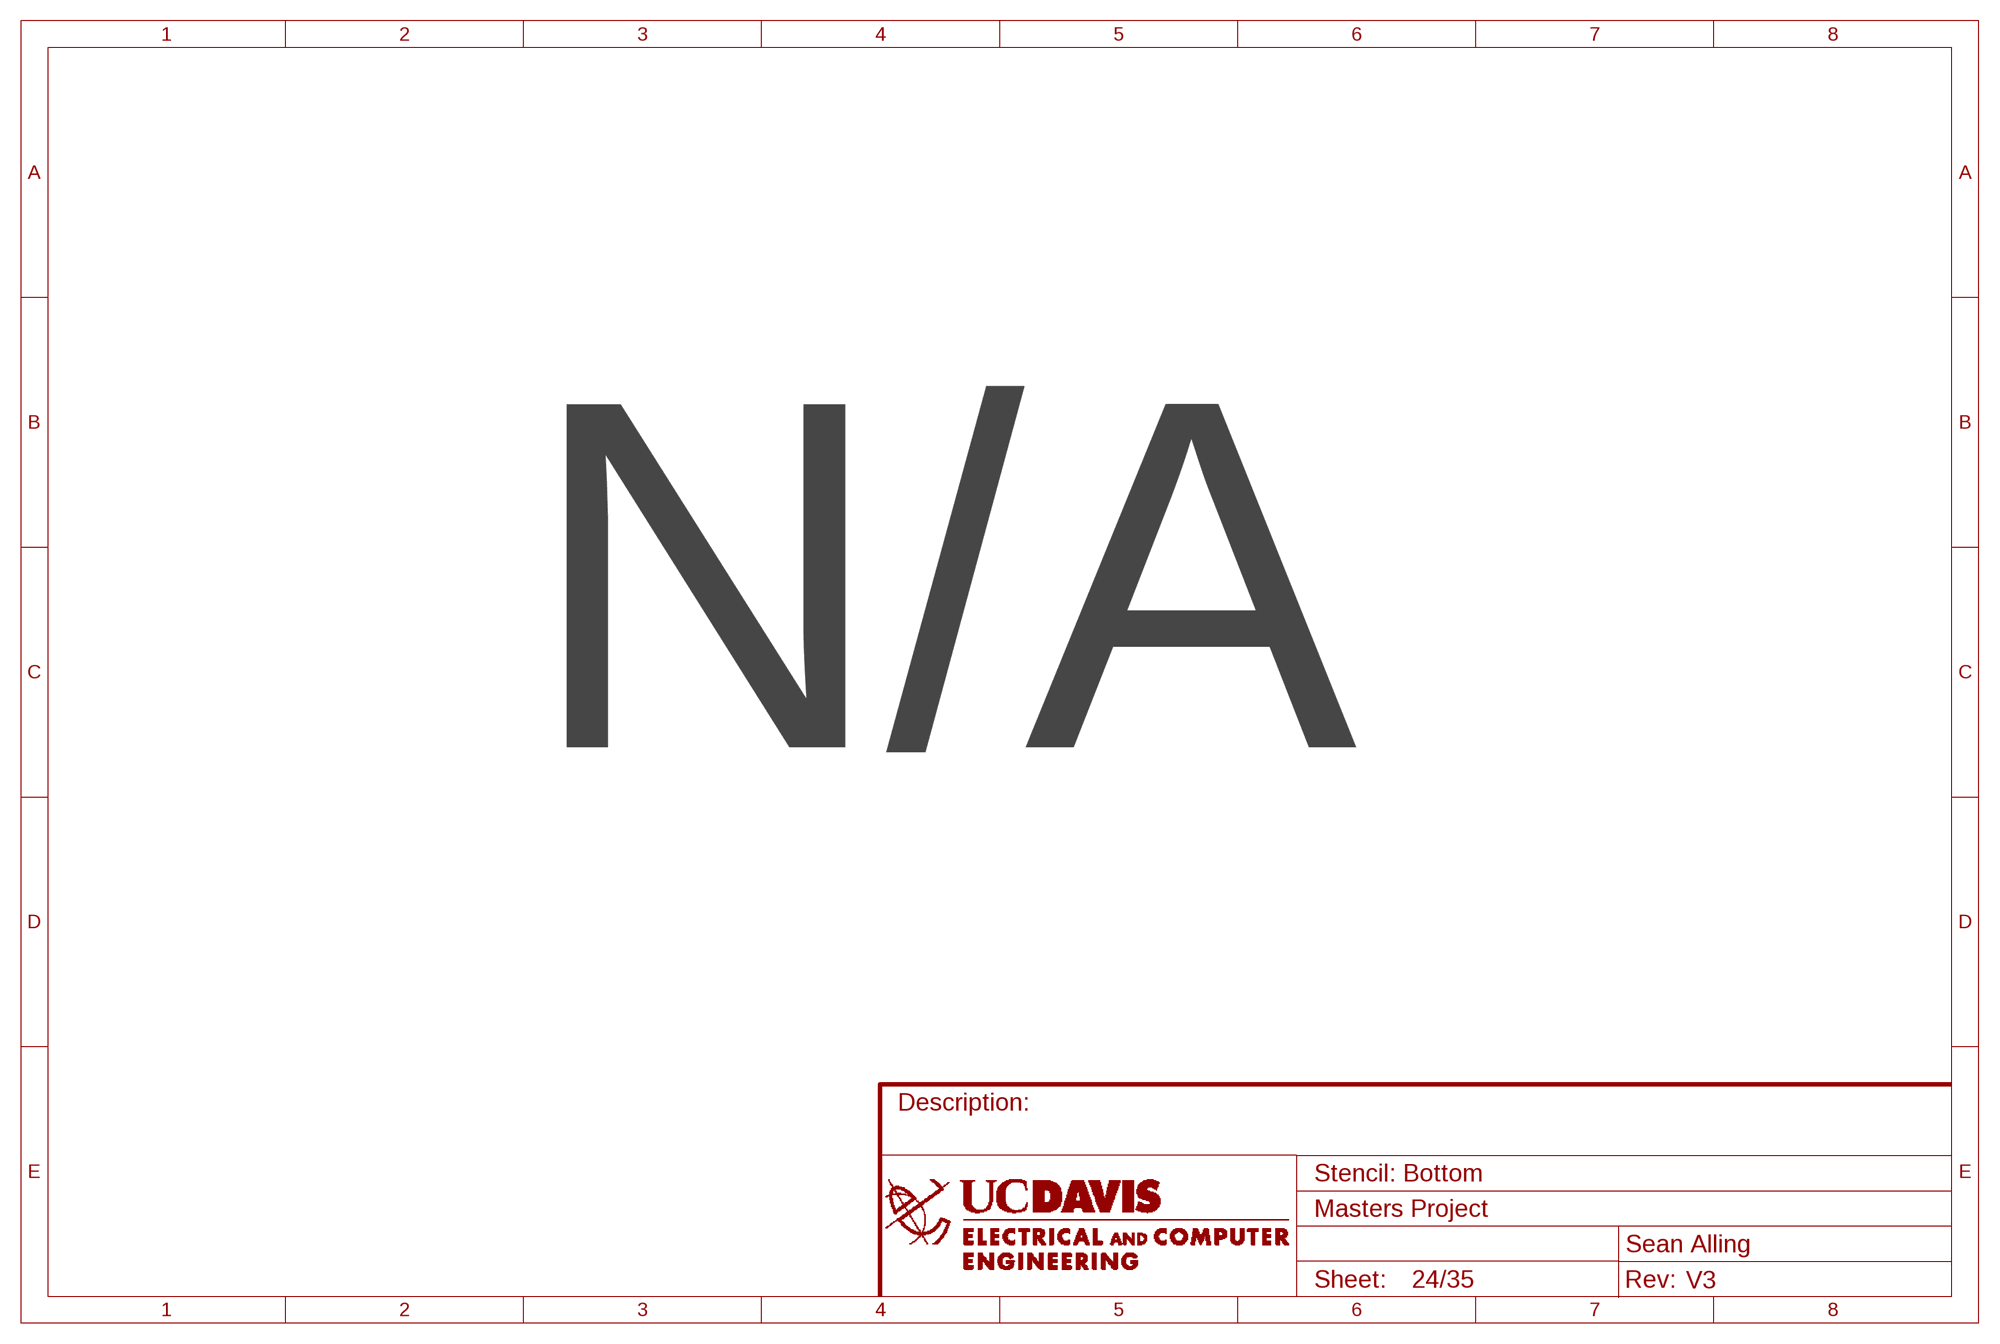
[diagram p23: schematic, sheet 24]

### Notes on the sheet
- N/A